# EAGLE schematic 2017_01_15_release_v2 (EAGLE 7.6.0)
AUTHOR: Mike Stein; REV: 2.0

## Sheet 1 of 21
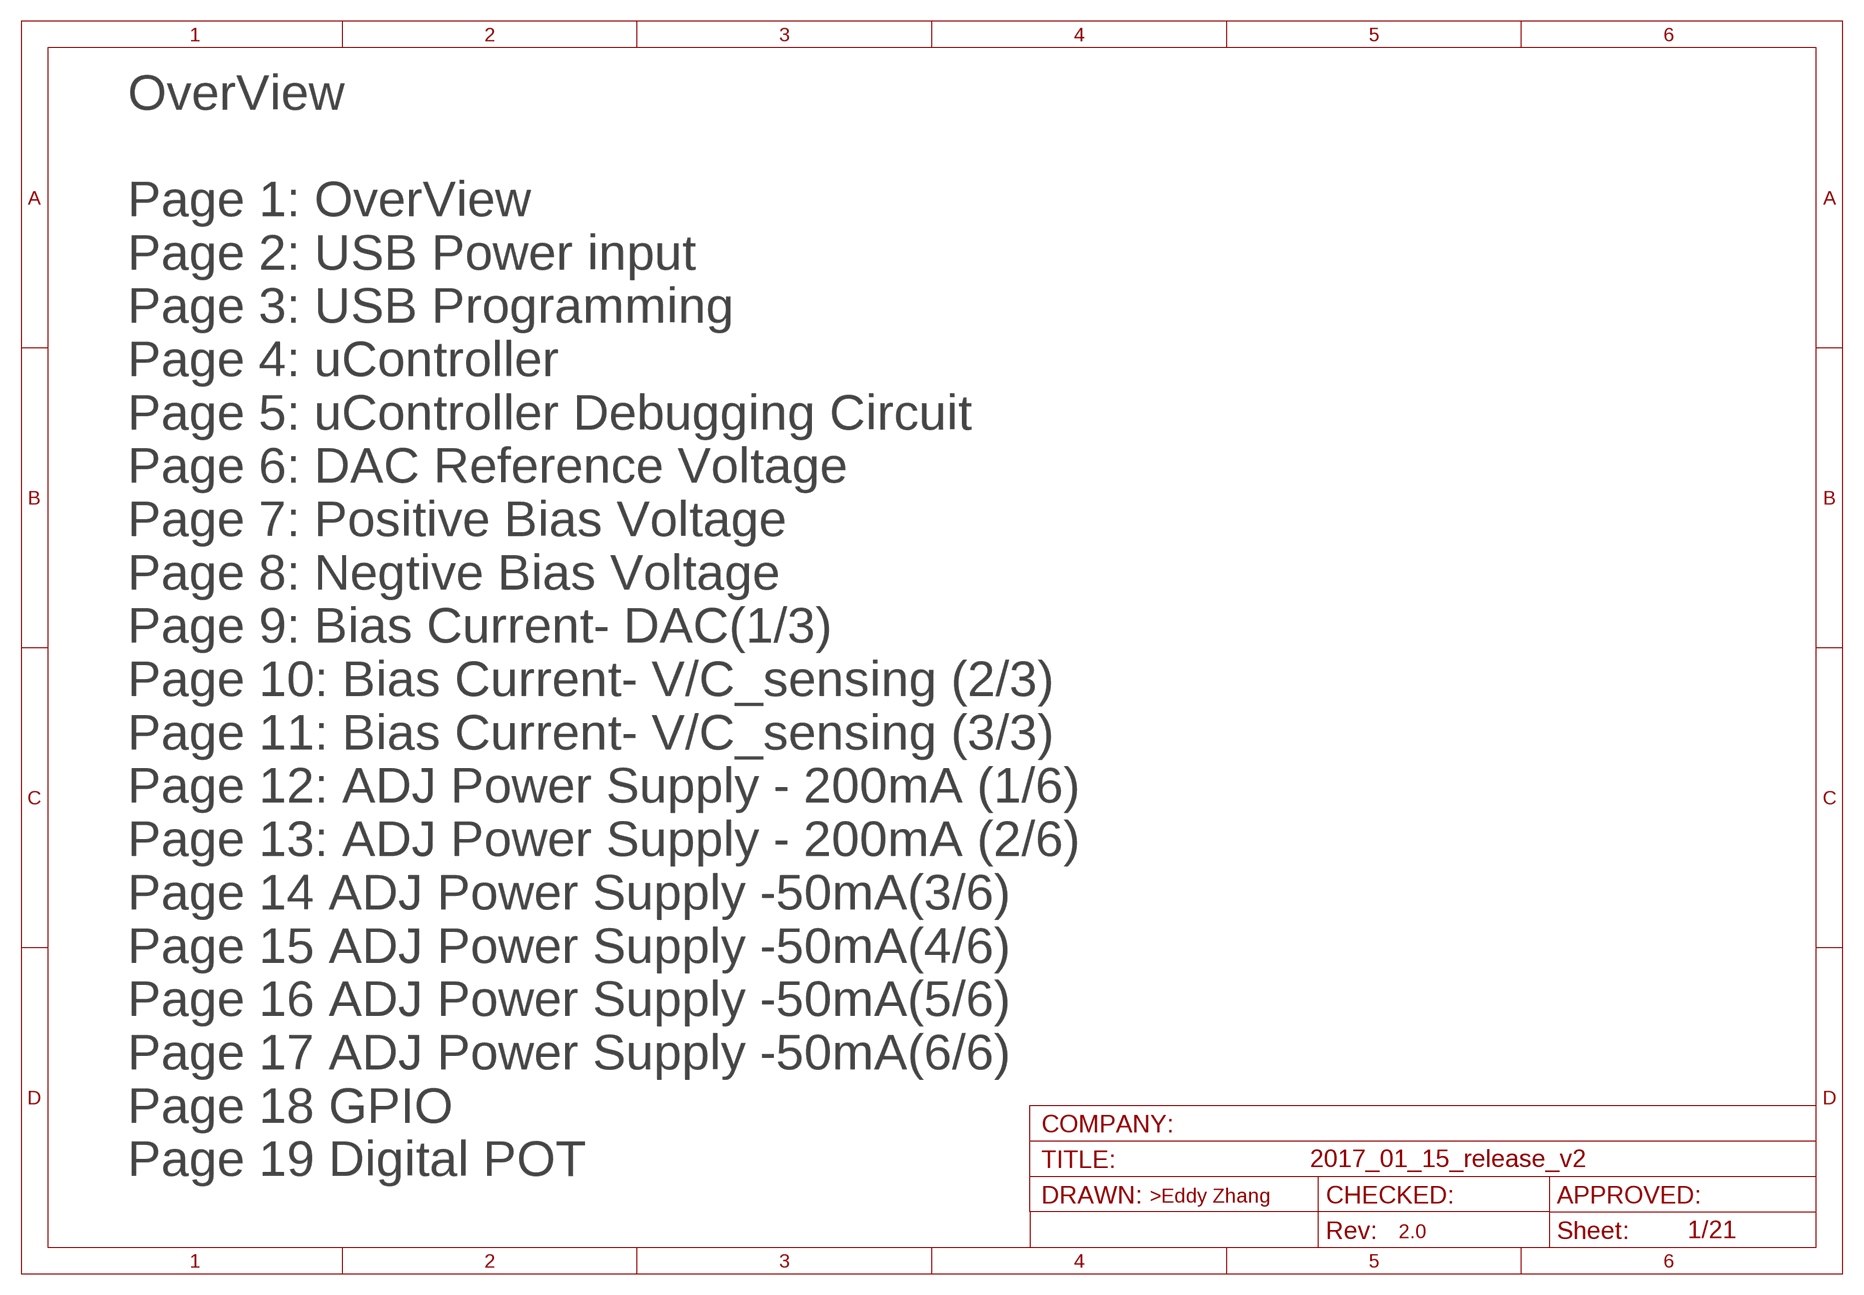
[diagram p0: schematic, sheet 1]

### Notes on the sheet
- >Eddy Zhang
- OverView
  
  Page 1: OverView
  Page 2: USB Power input
  Page 3: USB Programming
  Page 4: uController
  Page 5: uController Debugging Circuit
  Page 6: DAC Reference Voltage
  Page 7: Positive Bias Voltage
  Page 8: Negtive Bias Voltage
  Page 9: Bias Current- DAC(1/3)
  Page 10: Bias Current- V/C_sensing (2/3)
  Page 11: Bias Current- V/C_sensing (3/3)
  Page 12: ADJ Power Supply - 200mA (1/6)
  Page 13: ADJ Power Supply - 200mA (2/6)
  Page 14 ADJ Power Supply -50mA(3/6)
  Page 15 ADJ Power Supply -50mA(4/6)
  Page 16 ADJ Power Supply -50mA(5/6)
  Page 17 ADJ Power Supply -50mA(6/6)
  Page 18 GPIO
  Page 19 Digital POT

## Sheet 2 of 21
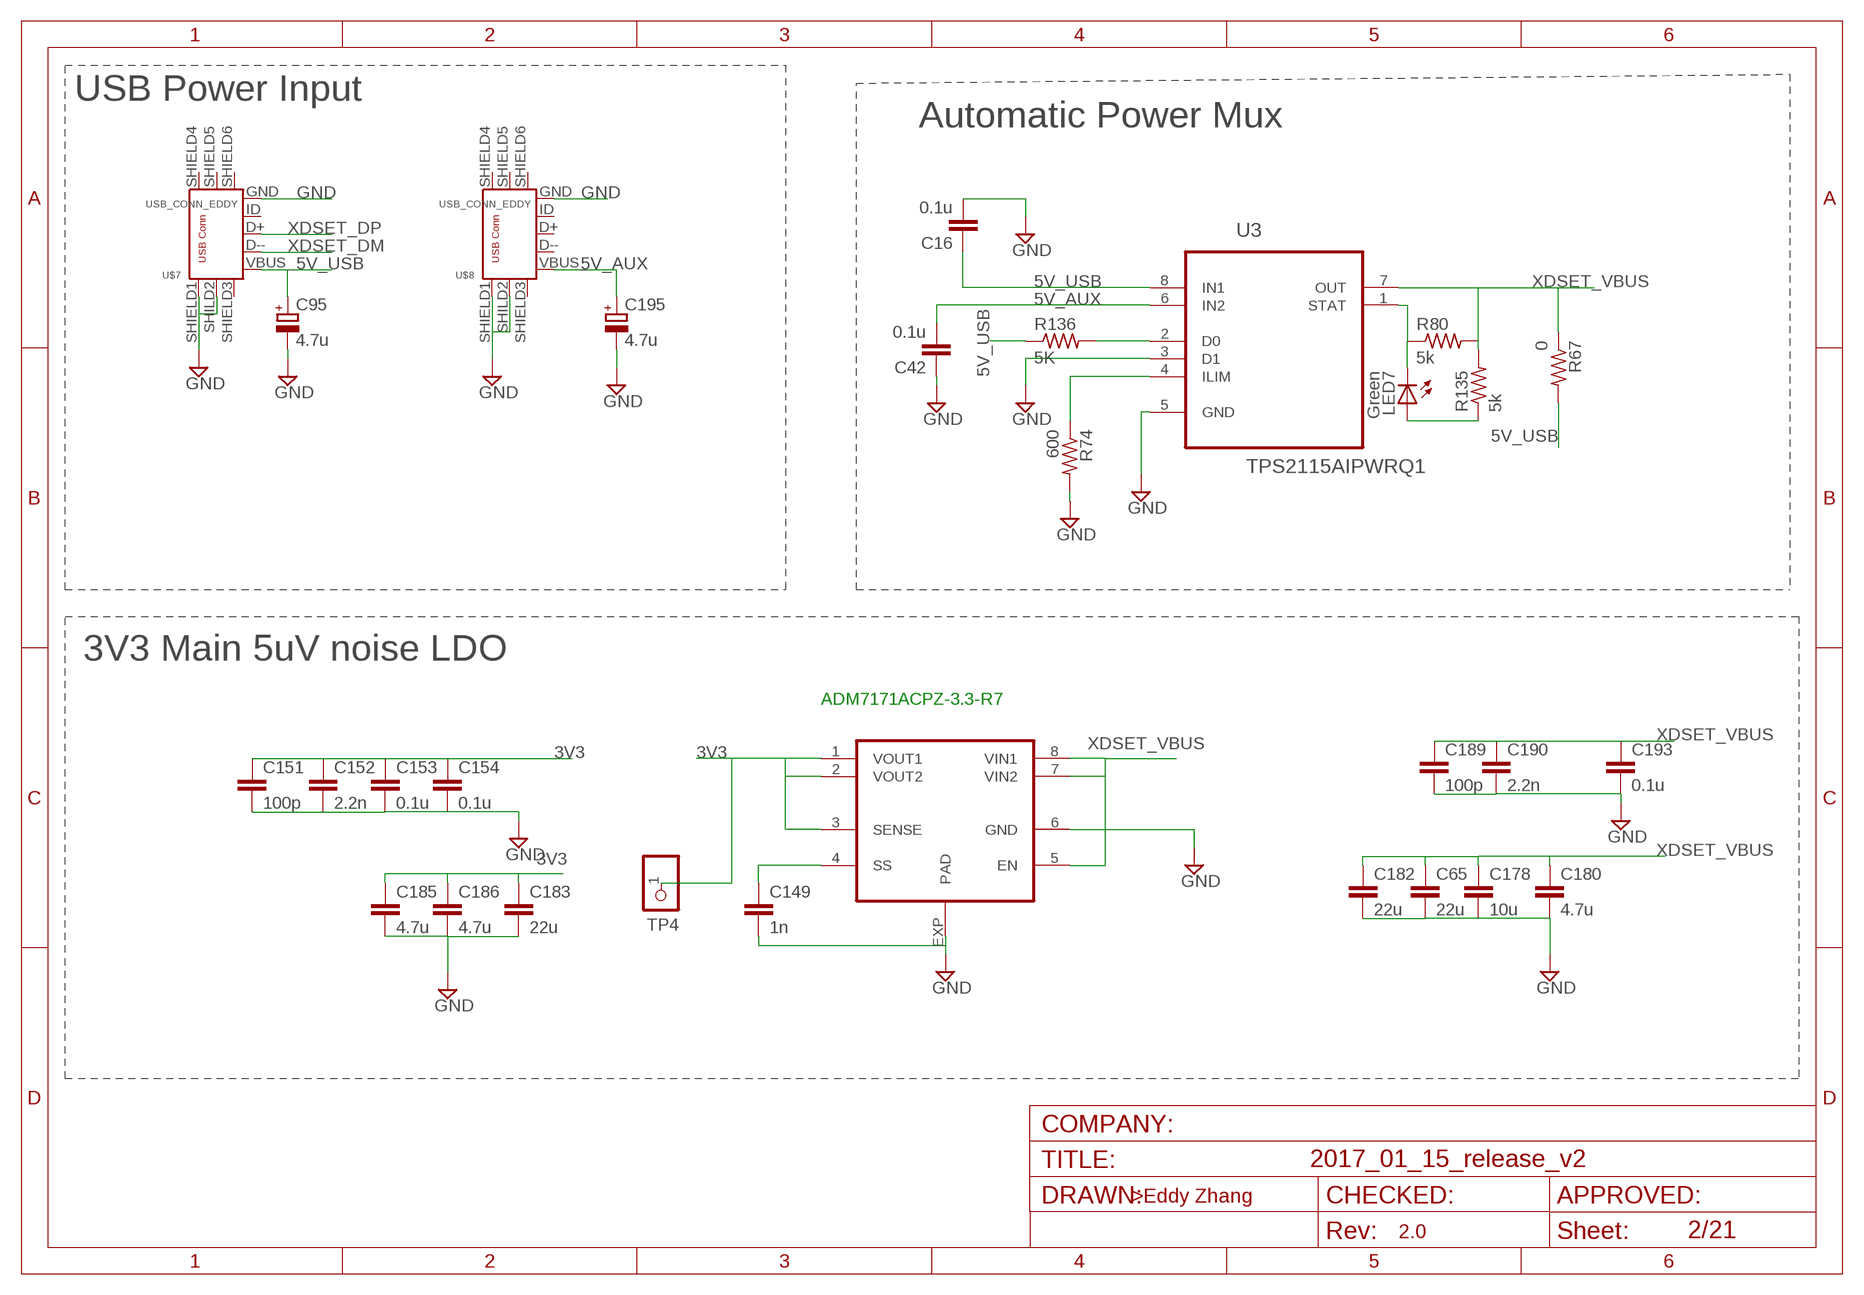
[diagram p1: schematic, sheet 2]

### Parts
C16  0.1u  C-EUC0603  [C0603]
C42  0.1u  C-EUC0603  [C0603]
C65  22u  C-EUC1210  [C1210]
C95  4.7u  CPOL-EUA/3216-18R  [A/3216-18R]
C149  1n  C-EUC0603  [C0603]
C151  100p  C-EUC0603  [C0603]
C152  2.2n  C-EUC0603  [C0603]
C153  0.1u  C-EUC0603  [C0603]
C154  0.1u  C-EUC0603  [C0603]
C178  10u  C-EUC0805  [C0805]
C180  4.7u  C-EUC0805  [C0805]
C182  22u  C-EUC1210  [C1210]
C183  22u  C-EUC1210  [C1210]
C185  4.7u  C-EUC0805  [C0805]
C186  4.7u  C-EUC0805  [C0805]
C189  100p  C-EUC0603  [C0603]
C190  2.2n  C-EUC0603  [C0603]
C193  0.1u  C-EUC0603  [C0603]
C195  4.7u  CPOL-EUA/3216-18R  [A/3216-18R]
LED7  Green  LED0603  [LED-0603]
R67  0  R-US_R0603  [R0603]
R74  600  R-US_R0603  [R0603]
R80  5k  R-US_R0603  [R0603]
R135  5k  R-US_R0603  [R0603]
R136  5K  R-US_R0603  [R0603]
TP4  TEST_PIN2  PINHD-1X1  [1X01]
U3  TPS2115AIPWRQ1  [SOP65P640X120-8N]
U$7  USB_CONN_EDDY  [USB_MICRO_EDDY]
U$8  USB_CONN_EDDY  [USB_MICRO_EDDY]
U$43  ADM7171  [LFCSP8]

### Nets
3V3 [Power]: C151.1 C152.1 C153.1 C154.1 C183.1 C185.1 C186.1 TP4.1 U$43.1(VOUT1) U$43.2(VOUT2) U$43.3(SENSE) ; also sheet 4,5,6,7,8,9,10,11,12,13,14,15,16,17,18,19,20
5V_AUX: C42.2 C195.+ U3.6(IN2) U$8.VBUS_(VBUS) ; also sheet 6
5V_USB [Power]: C16.1 C95.+ R67.2 R136.1 U3.8(IN1) U$7.VBUS_(VBUS) ; also sheet 3,6,7
GND [GND]: C16.2 C42.1 C65.2 C95.- C149.2 C151.2 C152.2 C153.2 C154.2 C178.2 C180.2 C182.2 C183.2 C185.2 C186.2 C189.2 C190.2 C193.2 C195.- R74.2 U3.3(D1) U3.5(GND) U$7.GND U$7.SHIELD1 U$7.SHILD2(SHIELD2) U$8.GND U$8.SHIELD1 U$8.SHILD2(SHIELD2) U$43.6(GND) U$43.EXP(PAD) ; also sheet 3,4,5,6,7,8,9,10,11,12,13,14,15,16,17,18,19,20,21
N$62: LED7.A R135.1
N$64: R136.2 U3.2(D0)
N$96: C149.1 U$43.4(SS)
N$129: LED7.C R80.1 U3.1(STAT)
N$133: R74.1 U3.4(ILIM)
XDSET_DM: U$7.D--(D-) ; also sheet 3
XDSET_DP: U$7.D+ ; also sheet 3
XDSET_VBUS [Power]: C65.1 C178.1 C180.1 C182.1 C189.1 C190.1 C193.1 R67.1 R80.2 R135.2 U3.7(OUT) U$43.5(EN) U$43.7(VIN2) U$43.8(VIN1) ; also sheet 6
Unconnected: U$7.ID(USBID) U$7.SHIELD3 U$7.SHIELD4 U$7.SHIELD5 U$7.SHIELD6 U$8.D+ U$8.D--(D-) U$8.ID(USBID) U$8.SHIELD3 U$8.SHIELD4 U$8.SHIELD5 U$8.SHIELD6

### Notes on the sheet
- USB Power Input
- Automatic Power Mux
- 3V3 Main 5uV noise LDO
- ADM7171ACPZ-3.3-R7
- >Eddy Zhang

## Sheet 3 of 21
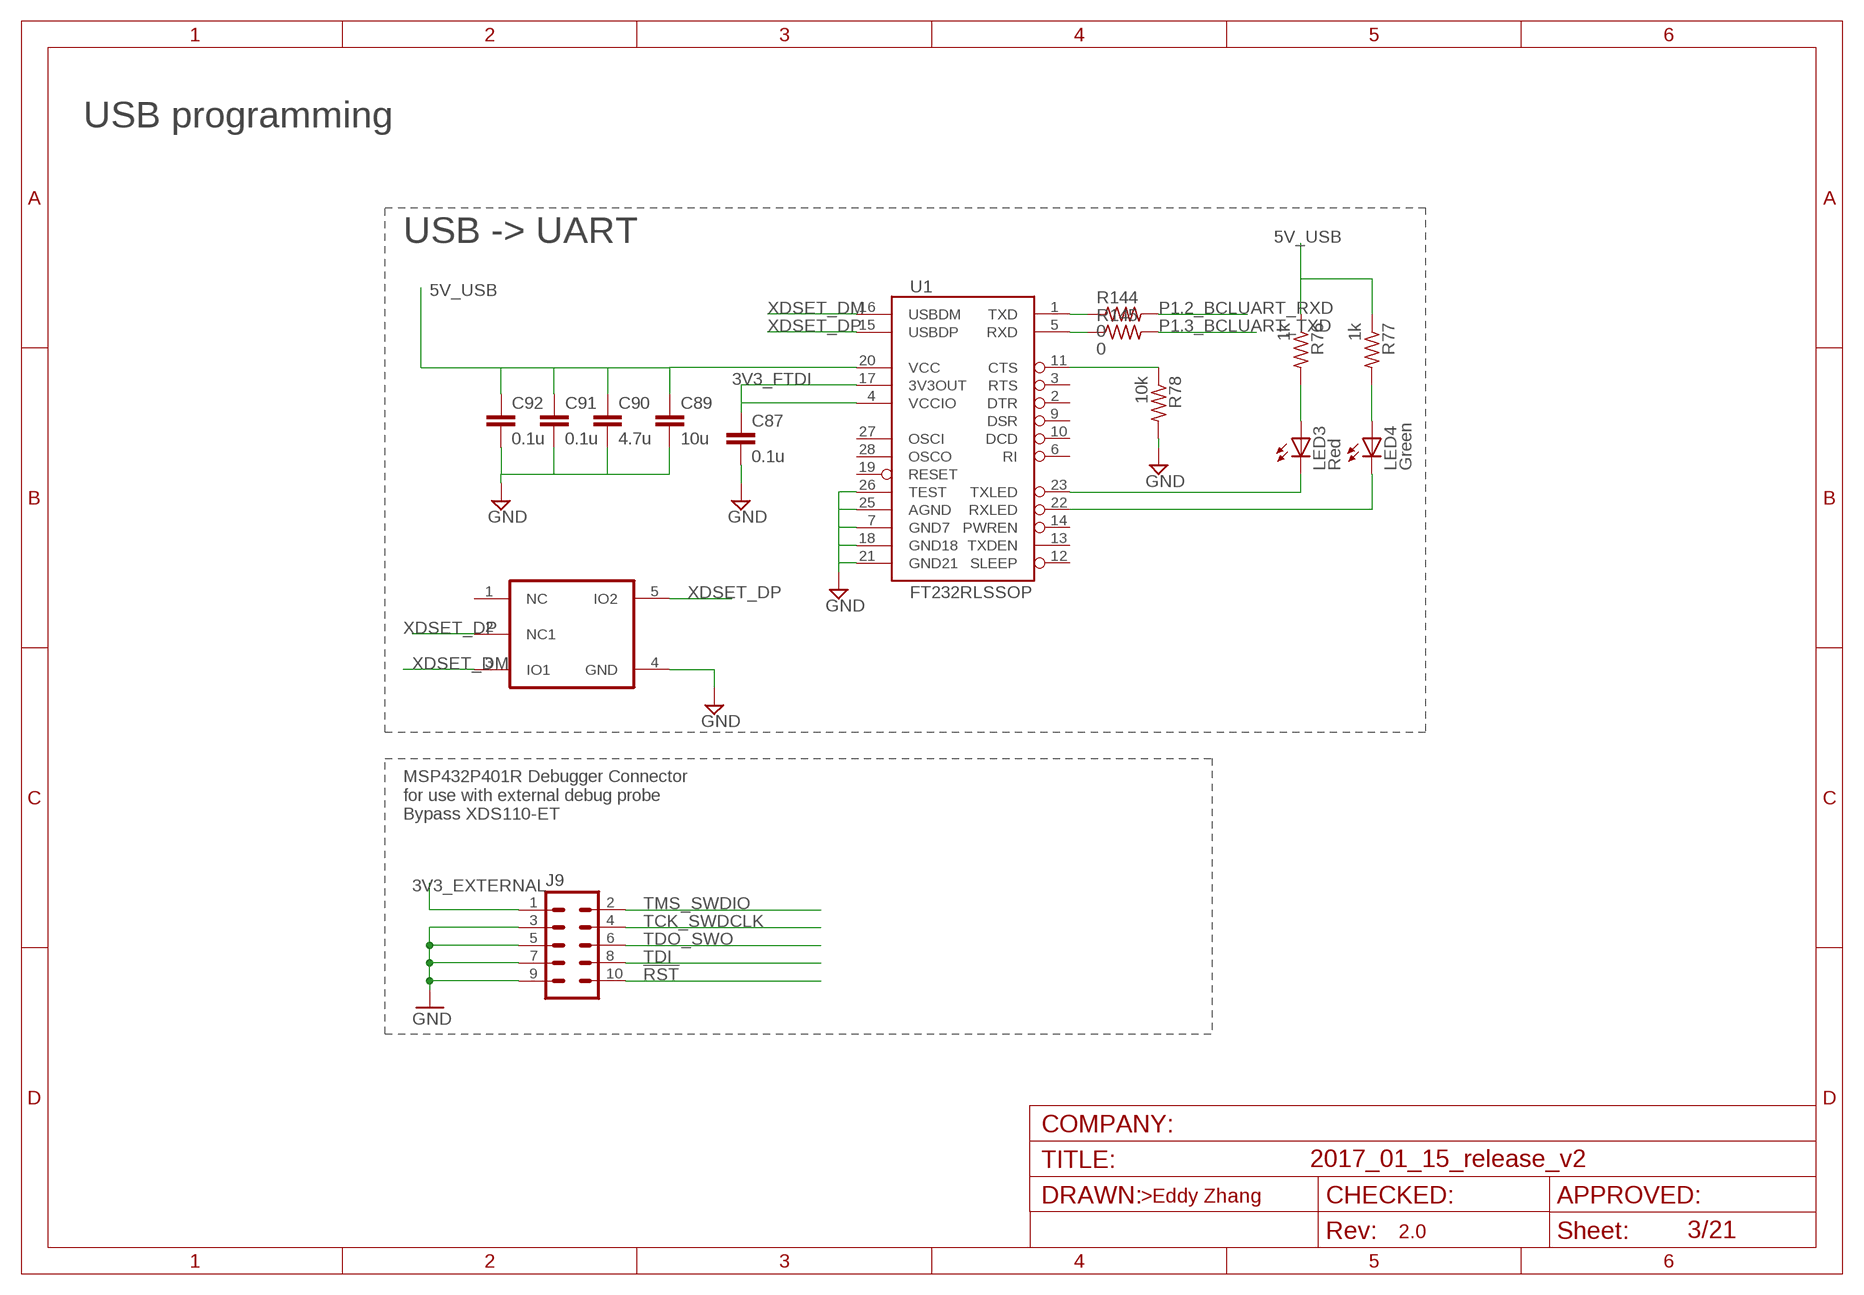
[diagram p2: schematic, sheet 3]

### Parts
C87  0.1u  C-EUC0603  [C0603]
C89  10u  C-EUC0805  [C0805]
C90  4.7u  C-EUC0805  [C0805]
C91  0.1u  C-EUC0603  [C0603]
C92  0.1u  C-EUC0603  [C0603]
ESD_DIODE  TPD2E2U06  [SOT_DRL_N5]
J9  DEBUG_ARM-10  [ARM-10]
LED3  Red  LED0603  [LED-0603]
LED4  Green  LED0603  [LED-0603]
R76  1k  R-US_R0603  [R0603]
R77  1k  R-US_R0603  [R0603]
R78  10k  R-US_R0603  [R0603]
R144  0  R-US_R0603  [R0603]
R145  0  R-US_R0603  [R0603]
U1  FT232RLSSOP  [SSOP28DB]

### Nets
3V3_EXTERNAL [Power]: J9.1
3V3_FTDI: C87.1 U1.4(VCCIO) U1.17(3V3OUT)
5V_USB [Power]: C89.1 C90.1 C91.1 C92.1 R76.1 R77.1 U1.20(VCC) ; also sheet 2,6,7
!RST: J9.10 ; also sheet 5,6
GND [GND]: C87.2 C89.2 C90.2 C91.2 C92.2 ESD_DIODE.4(GND) J9.3 J9.5 J9.7 J9.9 R78.2 U1.7(GND7) U1.18(GND18) U1.21(GND21) U1.25(AGND) U1.26(TEST) ; also sheet 2,4,5,6,7,8,9,10,11,12,13,14,15,16,17,18,19,20,21
N$92: R78.1 U1.11(CTS)
N$102: LED3.C U1.23(TXLED)
N$103: LED4.C U1.22(RXLED)
N$105: LED3.A R76.2
N$106: LED4.A R77.2
P1.2_BCLUART_RXD: R144.2 ; also sheet 5
P1.2_BCLUART_RXD_IC: R144.1 U1.1(TXD)
P1.3_BCLUART_TXD: R145.2 ; also sheet 5
P1.3_BCLUART_TXD_IC: R145.1 U1.5(RXD)
TCK_SWDCLK: J9.4 ; also sheet 5
TDI: J9.8 ; also sheet 5
TDO_SWO: J9.6 ; also sheet 5
TMS_SWDIO: J9.2 ; also sheet 5
XDSET_DM: ESD_DIODE.3(IO1) U1.16(USBDM) ; also sheet 2
XDSET_DP: ESD_DIODE.2(NC1) ESD_DIODE.5(IO2) U1.15(USBDP) ; also sheet 2
Unconnected: ESD_DIODE.1(NC) U1.2(DTR) U1.3(RTS) U1.6(RI) U1.9(DSR) U1.10(DCD) U1.12(SLEEP) U1.13(TXDEN) U1.14(PWREN) U1.19(RESET) U1.27(OSCI) U1.28(OSCO)

### Notes on the sheet
- USB programming
- USB -> UART
- MSP432P401R Debugger Connector
  for use with external debug probe
  Bypass XDS110-ET
- >Eddy Zhang

## Sheet 4 of 21
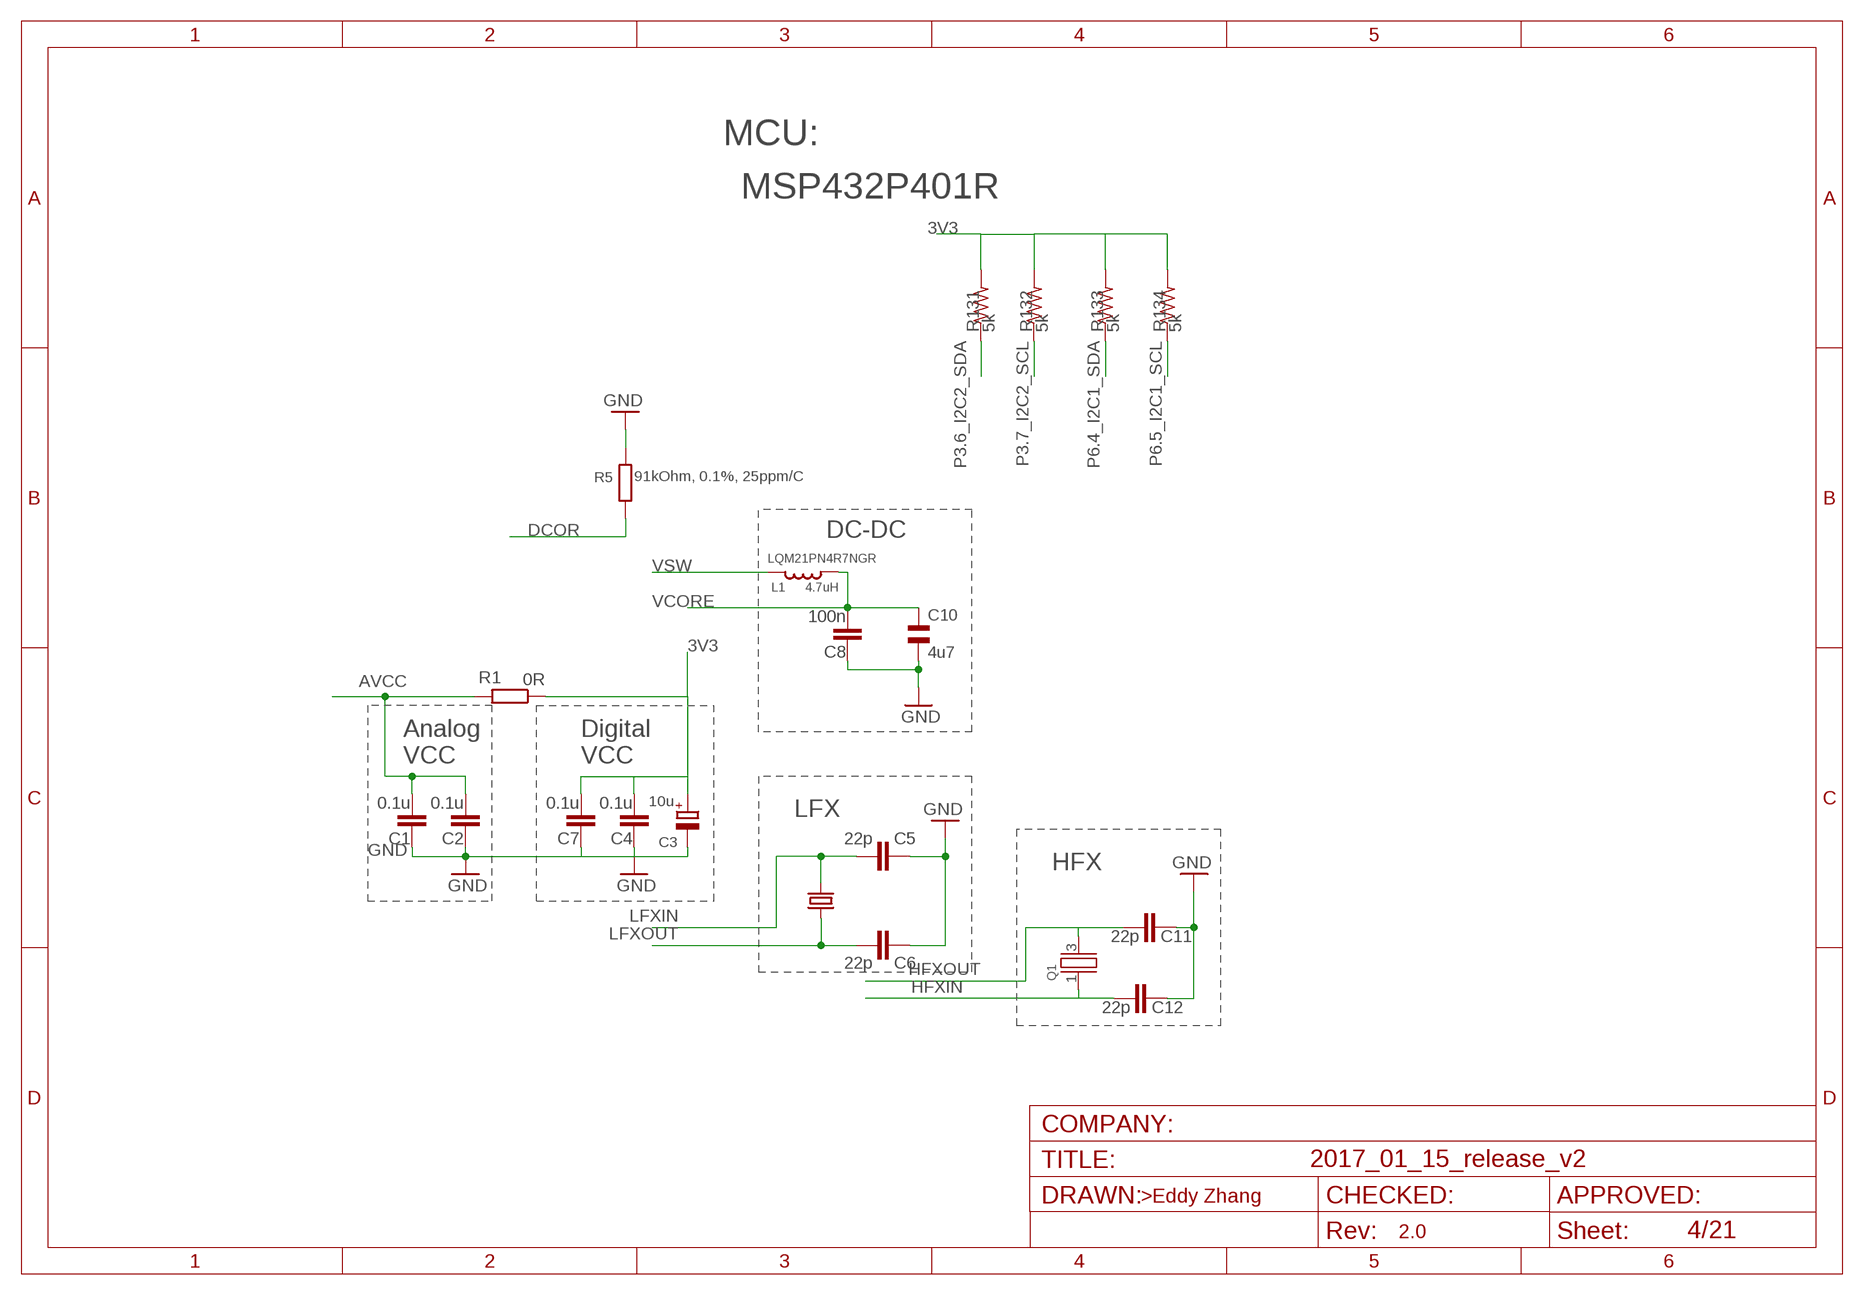
[diagram p3: schematic, sheet 4]

### Parts
32KHZ  FC-135  [FC-135_32KHZ]
C1  0.1u  C-EUC0603K  [C0603K]
C2  0.1u  C-EUC0603K  [C0603K]
C3  10u  CPOL-EUA/3216-18R  [A/3216-18R]
C4  0.1u  C-EUC0603K  [C0603K]
C5  22p  C-EUC0603  [C0603]
C6  22p  C-EUC0603  [C0603]
C7  0.1u  C-EUC0603K  [C0603K]
C8  100n  C-EUC0603K  [C0603K]
C10  4u7  CSMD0805  [CSMD0805]
C11  22p  C-EUC0603K  [C0603K]
C12  22p  C-EUC0603K  [C0603K]
L1  4.7uH  LQM2MP_G0  [0806]
Q1  CRYSTALEPSON_FA-238  [FA-238]
R1  0R  R-EU_R0603  [R0603]
R5  91kOhm, 0.1%, 25ppm/C  R_0805  [0805]
R131  5k  R-US_R0603  [R0603]
R132  5k  R-US_R0603  [R0603]
R133  5k  R-US_R0603  [R0603]
R134  5k  R-US_R0603  [R0603]

### Nets
3V3 [Power]: C3.+ C4.1 C7.1 R1.1 R131.2 R132.2 R133.2 R134.2 ; also sheet 2,5,6,7,8,9,10,11,12,13,14,15,16,17,18,19,20
AVCC: C1.1 C2.1 R1.2 ; also sheet 5
DCOR: R5.1 ; also sheet 5
GND [GND]: C1.2 C2.2 C3.- C4.2 C5.2 C6.2 C7.2 C8.2 C10.2 C11.2 C12.2 R5.2 ; also sheet 2,3,5,6,7,8,9,10,11,12,13,14,15,16,17,18,19,20,21
HFXIN: C12.1 Q1.1 ; also sheet 5
HFXOUT: C11.1 Q1.3 ; also sheet 5
LFXIN: 32KHZ.P$2 C5.1 ; also sheet 5
LFXOUT: 32KHZ.P$1 C6.1 ; also sheet 5
P3.6_I2C2_SDA: R131.1 ; also sheet 5,17,18,19,20
P3.7_I2C2_SCL: R132.1 ; also sheet 5,17,18,19,20
P6.4_I2C1_SDA: R133.1 ; also sheet 5,13,14,15,16
P6.5_I2C1_SCL: R134.1 ; also sheet 5,13,14,15,16
VCORE: C8.1 C10.1 L1.1 ; also sheet 5
VSW: L1.2 ; also sheet 5

### Notes on the sheet
- MCU:
- MSP432P401R
- DC-DC
- LQM21PN4R7NGR
- Analog | Digital
- VCC | VCC
- LFX
- HFX
- >Eddy Zhang

## Sheet 5 of 21
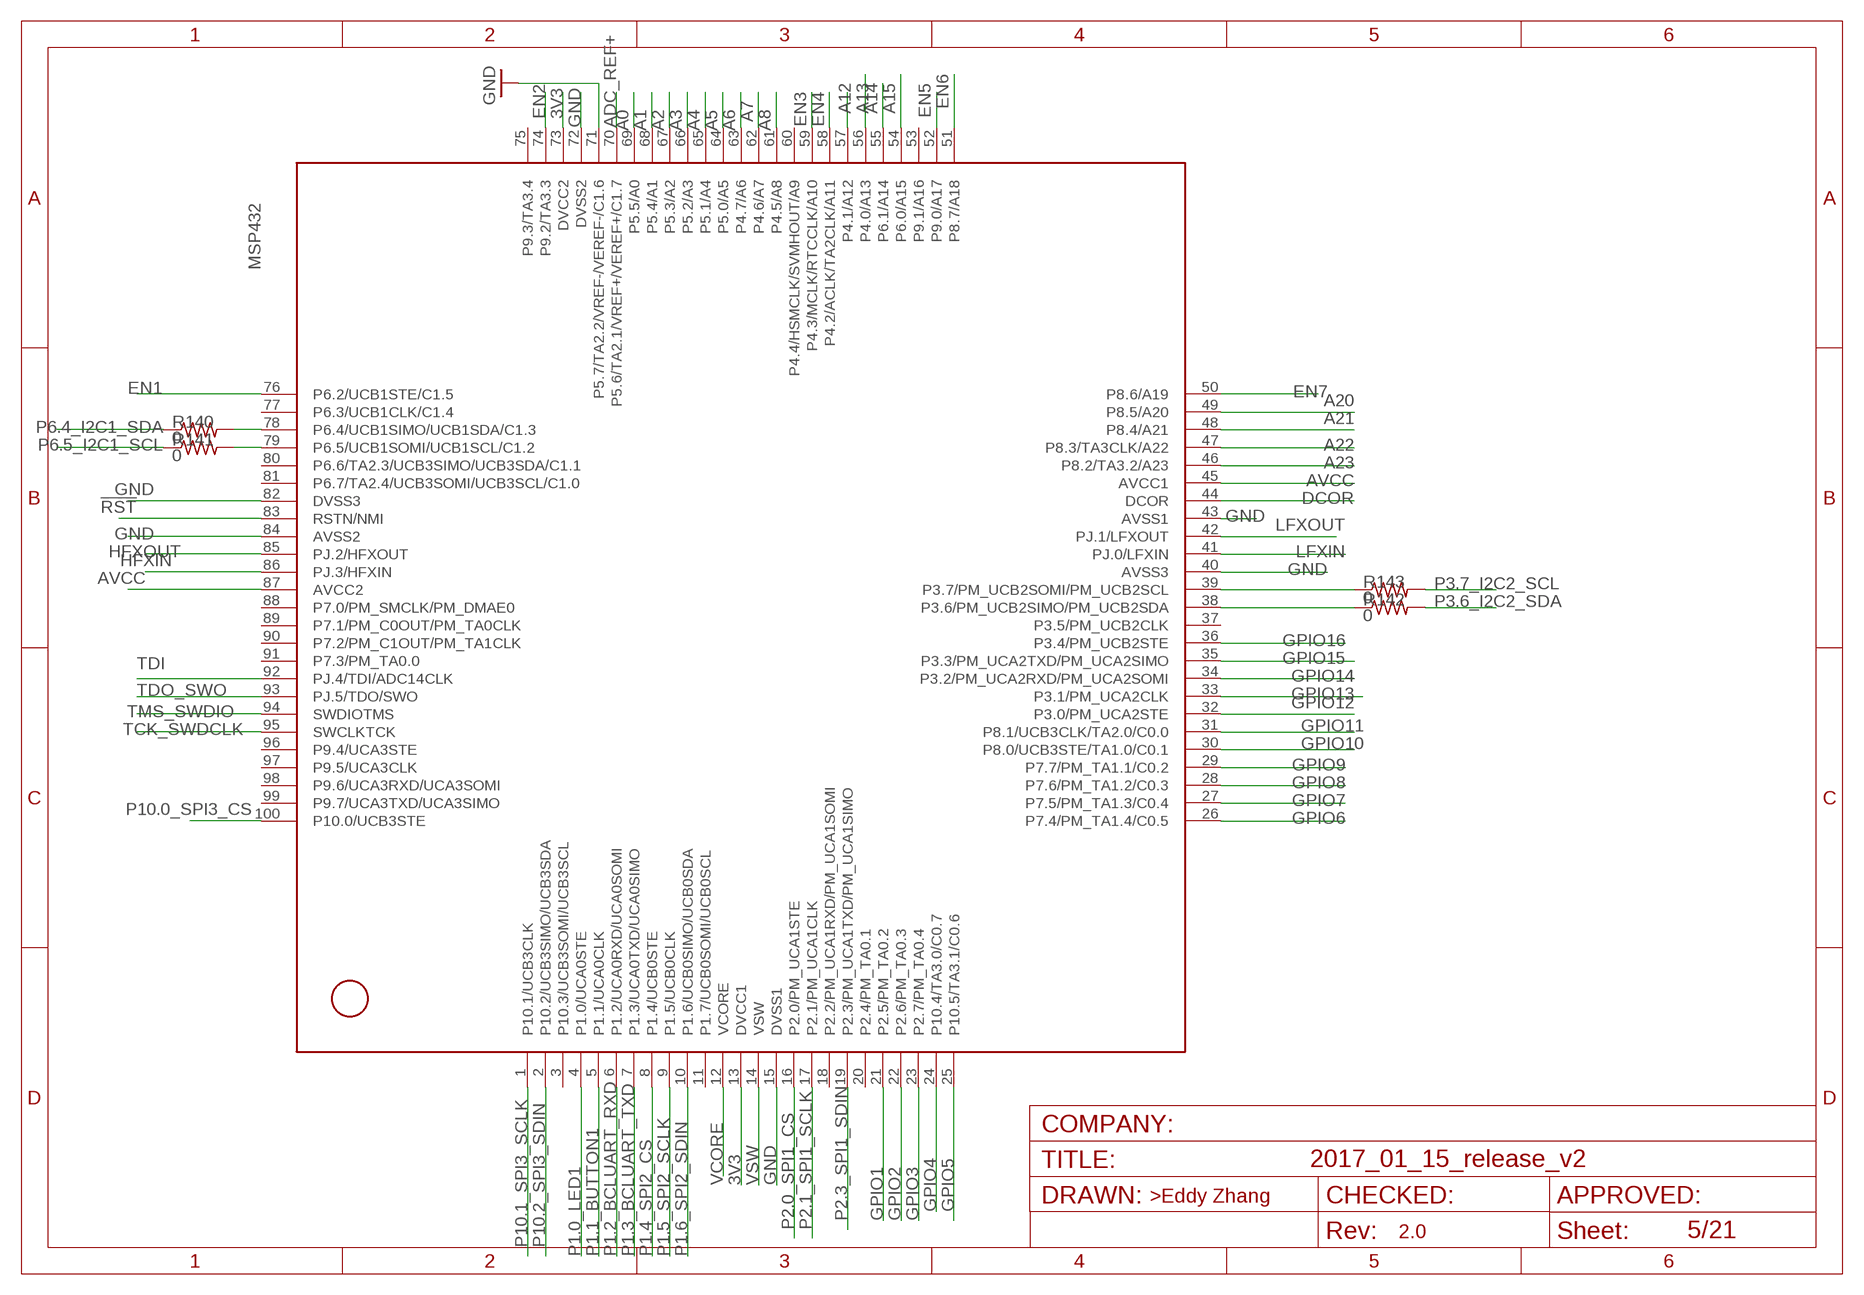
[diagram p4: schematic, sheet 5]

### Parts
MSP432  MSP432P401XPZ  [LQFP100]
R140  0  R-US_R0603  [R0603]
R141  0  R-US_R0603  [R0603]
R142  0  R-US_R0603  [R0603]
R143  0  R-US_R0603  [R0603]

### Nets
3V3 [Power]: MSP432.13(DVCC1) MSP432.73(DVCC2) ; also sheet 2,4,6,7,8,9,10,11,12,13,14,15,16,17,18,19,20
!RST: MSP432.83(RSTN/NMI) ; also sheet 3,6
A0: MSP432.69(P5.5/A0) ; also sheet 13
A1: MSP432.68(P5.4/A1) ; also sheet 13
A2: MSP432.67(P5.3/A2) ; also sheet 14
A3: MSP432.66(P5.2/A3) ; also sheet 14
A4: MSP432.65(P5.1/A4) ; also sheet 15
A5: MSP432.64(P5.0/A5) ; also sheet 15
A6: MSP432.63(P4.7/A6) ; also sheet 16
A7: MSP432.62(P4.6/A7) ; also sheet 16
A8: MSP432.61(P4.5/A8) ; also sheet 17
A12: MSP432.57(P4.1/A12) ; also sheet 17
A13: MSP432.56(P4.0/A13) ; also sheet 18
A14: MSP432.55(P6.1/A14) ; also sheet 18
A15: MSP432.54(P6.0/A15) ; also sheet 19
A20: MSP432.49(P8.5/A20) ; also sheet 12
A21: MSP432.48(P8.4/A21) ; also sheet 11
A22: MSP432.47(P8.3/TA3CLK/A22) ; also sheet 11
A23: MSP432.46(P8.2/TA3.2/A23) ; also sheet 12
ADC_REF+: MSP432.70(P5.6/TA2.1/VREF+/VEREF+/C1.7) ; also sheet 7
AVCC: MSP432.45(AVCC1) MSP432.87(AVCC2) ; also sheet 4
DCOR: MSP432.44(DCOR) ; also sheet 4
EN1: MSP432.76(P6.2/UCB1STE/C1.5) ; also sheet 13
EN2: MSP432.74(P9.2/TA3.3) ; also sheet 14
EN3: MSP432.59(P4.3/MCLK/RTCCLK/A10) ; also sheet 15
EN4: MSP432.58(P4.2/ACLK/TA2CLK/A11) ; also sheet 16
EN5: MSP432.52(P9.0/A17) ; also sheet 17
EN6: MSP432.51(P8.7/A18) ; also sheet 18
EN7: MSP432.50(P8.6/A19) ; also sheet 19
GND [GND]: MSP432.15(DVSS1) MSP432.40(AVSS3) MSP432.43(AVSS1) MSP432.71(P5.7/TA2.2/VREF-/VEREF-/C1.6) MSP432.72(DVSS2) MSP432.82(DVSS3) MSP432.84(AVSS2) ; also sheet 2,3,4,6,7,8,9,10,11,12,13,14,15,16,17,18,19,20,21
GPIO1: MSP432.21(P2.5/PM_TA0.2) ; also sheet 19
GPIO2: MSP432.22(P2.6/PM_TA0.3) ; also sheet 19
GPIO3: MSP432.23(P2.7/PM_TA0.4) ; also sheet 19
GPIO4: MSP432.24(P10.4/TA3.0/C0.7) ; also sheet 19
GPIO5: MSP432.25(P10.5/TA3.1/C0.6) ; also sheet 19
GPIO6: MSP432.26(P7.4/PM_TA1.4/C0.5) ; also sheet 19
GPIO7: MSP432.27(P7.5/PM_TA1.3/C0.4) ; also sheet 19
GPIO8: MSP432.28(P7.6/PM_TA1.2/C0.3) ; also sheet 19
GPIO9: MSP432.29(P7.7/PM_TA1.1/C0.2) ; also sheet 19
GPIO10: MSP432.30(P8.0/UCB3STE/TA1.0/C0.1) ; also sheet 19
GPIO11: MSP432.31(P8.1/UCB3CLK/TA2.0/C0.0) ; also sheet 19
GPIO12: MSP432.32(P3.0/PM_UCA2STE) ; also sheet 19
GPIO13: MSP432.33(P3.1/PM_UCA2CLK) ; also sheet 19
GPIO14: MSP432.34(P3.2/PM_UCA2RXD/PM_UCA2SOMI) ; also sheet 19
GPIO15: MSP432.35(P3.3/PM_UCA2TXD/PM_UCA2SIMO) ; also sheet 19
GPIO16: MSP432.36(P3.4/PM_UCB2STE) ; also sheet 19
HFXIN: MSP432.86(PJ.3/HFXIN) ; also sheet 4
HFXOUT: MSP432.85(PJ.2/HFXOUT) ; also sheet 4
LFXIN: MSP432.41(PJ.0/LFXIN) ; also sheet 4
LFXOUT: MSP432.42(PJ.1/LFXOUT) ; also sheet 4
P1.0_LED1: MSP432.4(P1.0/UCA0STE) ; also sheet 6
P1.1_BUTTON1: MSP432.5(P1.1/UCA0CLK) ; also sheet 6
P1.2_BCLUART_RXD: MSP432.6(P1.2/UCA0RXD/UCA0SOMI) ; also sheet 3
P1.3_BCLUART_TXD: MSP432.7(P1.3/UCA0TXD/UCA0SIMO) ; also sheet 3
P1.4_SPI2_CS: MSP432.8(P1.4/UCB0STE) ; also sheet 10
P1.5_SPI2_SCLK: MSP432.9(P1.5/UCB0CLK) ; also sheet 10
P1.6_SPI2_SDIN: MSP432.10(P1.6/UCB0SIMO/UCB0SDA) ; also sheet 10
P2.0_SPI1_CS: MSP432.16(P2.0/PM_UCA1STE) ; also sheet 8
P2.1_SPI1_SCLK: MSP432.17(P2.1/PM_UCA1CLK) ; also sheet 8
P2.3_SPI1_SDIN: MSP432.19(P2.3/PM_UCA1TXD/PM_UCA1SIMO) ; also sheet 8
P3.6_I2C2_SDA: R142.2 ; also sheet 4,17,18,19,20
P3.6_I2C2_SDA_IC: MSP432.38(P3.6/PM_UCB2SIMO/PM_UCB2SDA) R142.1
P3.7_I2C2_SCL: R143.2 ; also sheet 4,17,18,19,20
P3.7_I2C2_SCL_IC: MSP432.39(P3.7/PM_UCB2SOMI/PM_UCB2SCL) R143.1
P6.4_I2C1_SDA: R140.1 ; also sheet 4,13,14,15,16
P6.4_I2C1_SDA_IC: MSP432.78(P6.4/UCB1SIMO/UCB1SDA/C1.3) R140.2
P6.5_I2C1_SCL: R141.1 ; also sheet 4,13,14,15,16
P6.5_I2C1_SCL_IC: MSP432.79(P6.5/UCB1SOMI/UCB1SCL/C1.2) R141.2
P10.0_SPI3_CS: MSP432.100(P10.0/UCB3STE) ; also sheet 9
P10.1_SPI3_SCLK: MSP432.1(P10.1/UCB3CLK) ; also sheet 9
P10.2_SPI3_SDIN: MSP432.2(P10.2/UCB3SIMO/UCB3SDA) ; also sheet 9
TCK_SWDCLK: MSP432.95(SWCLKTCK) ; also sheet 3
TDI: MSP432.92(PJ.4/TDI/ADC14CLK) ; also sheet 3
TDO_SWO: MSP432.93(PJ.5/TDO/SWO) ; also sheet 3
TMS_SWDIO: MSP432.94(SWDIOTMS) ; also sheet 3
VCORE: MSP432.12(VCORE) ; also sheet 4
VSW: MSP432.14(VSW) ; also sheet 4
Unconnected: MSP432.3(P10.3/UCB3SOMI/UCB3SCL) MSP432.11(P1.7/UCB0SOMI/UCB0SCL) MSP432.18(P2.2/PM_UCA1RXD/PM_UCA1SOMI) MSP432.20(P2.4/PM_TA0.1) MSP432.37(P3.5/PM_UCB2CLK) MSP432.53(P9.1/A16) MSP432.60(P4.4/HSMCLK/SVMHOUT/A9) MSP432.75(P9.3/TA3.4) MSP432.77(P6.3/UCB1CLK/C1.4) MSP432.80(P6.6/TA2.3/UCB3SIMO/UCB3SDA/C1.1) MSP432.81(P6.7/TA2.4/UCB3SOMI/UCB3SCL/C1.0) MSP432.88(P7.0/PM_SMCLK/PM_DMAE0) MSP432.89(P7.1/PM_C0OUT/PM_TA0CLK) MSP432.90(P7.2/PM_C1OUT/PM_TA1CLK) MSP432.91(P7.3/PM_TA0.0) MSP432.96(P9.4/UCA3STE) MSP432.97(P9.5/UCA3CLK) MSP432.98(P9.6/UCA3RXD/UCA3SOMI) MSP432.99(P9.7/UCA3TXD/UCA3SIMO)

### Notes on the sheet
- >Eddy Zhang

## Sheet 6 of 21
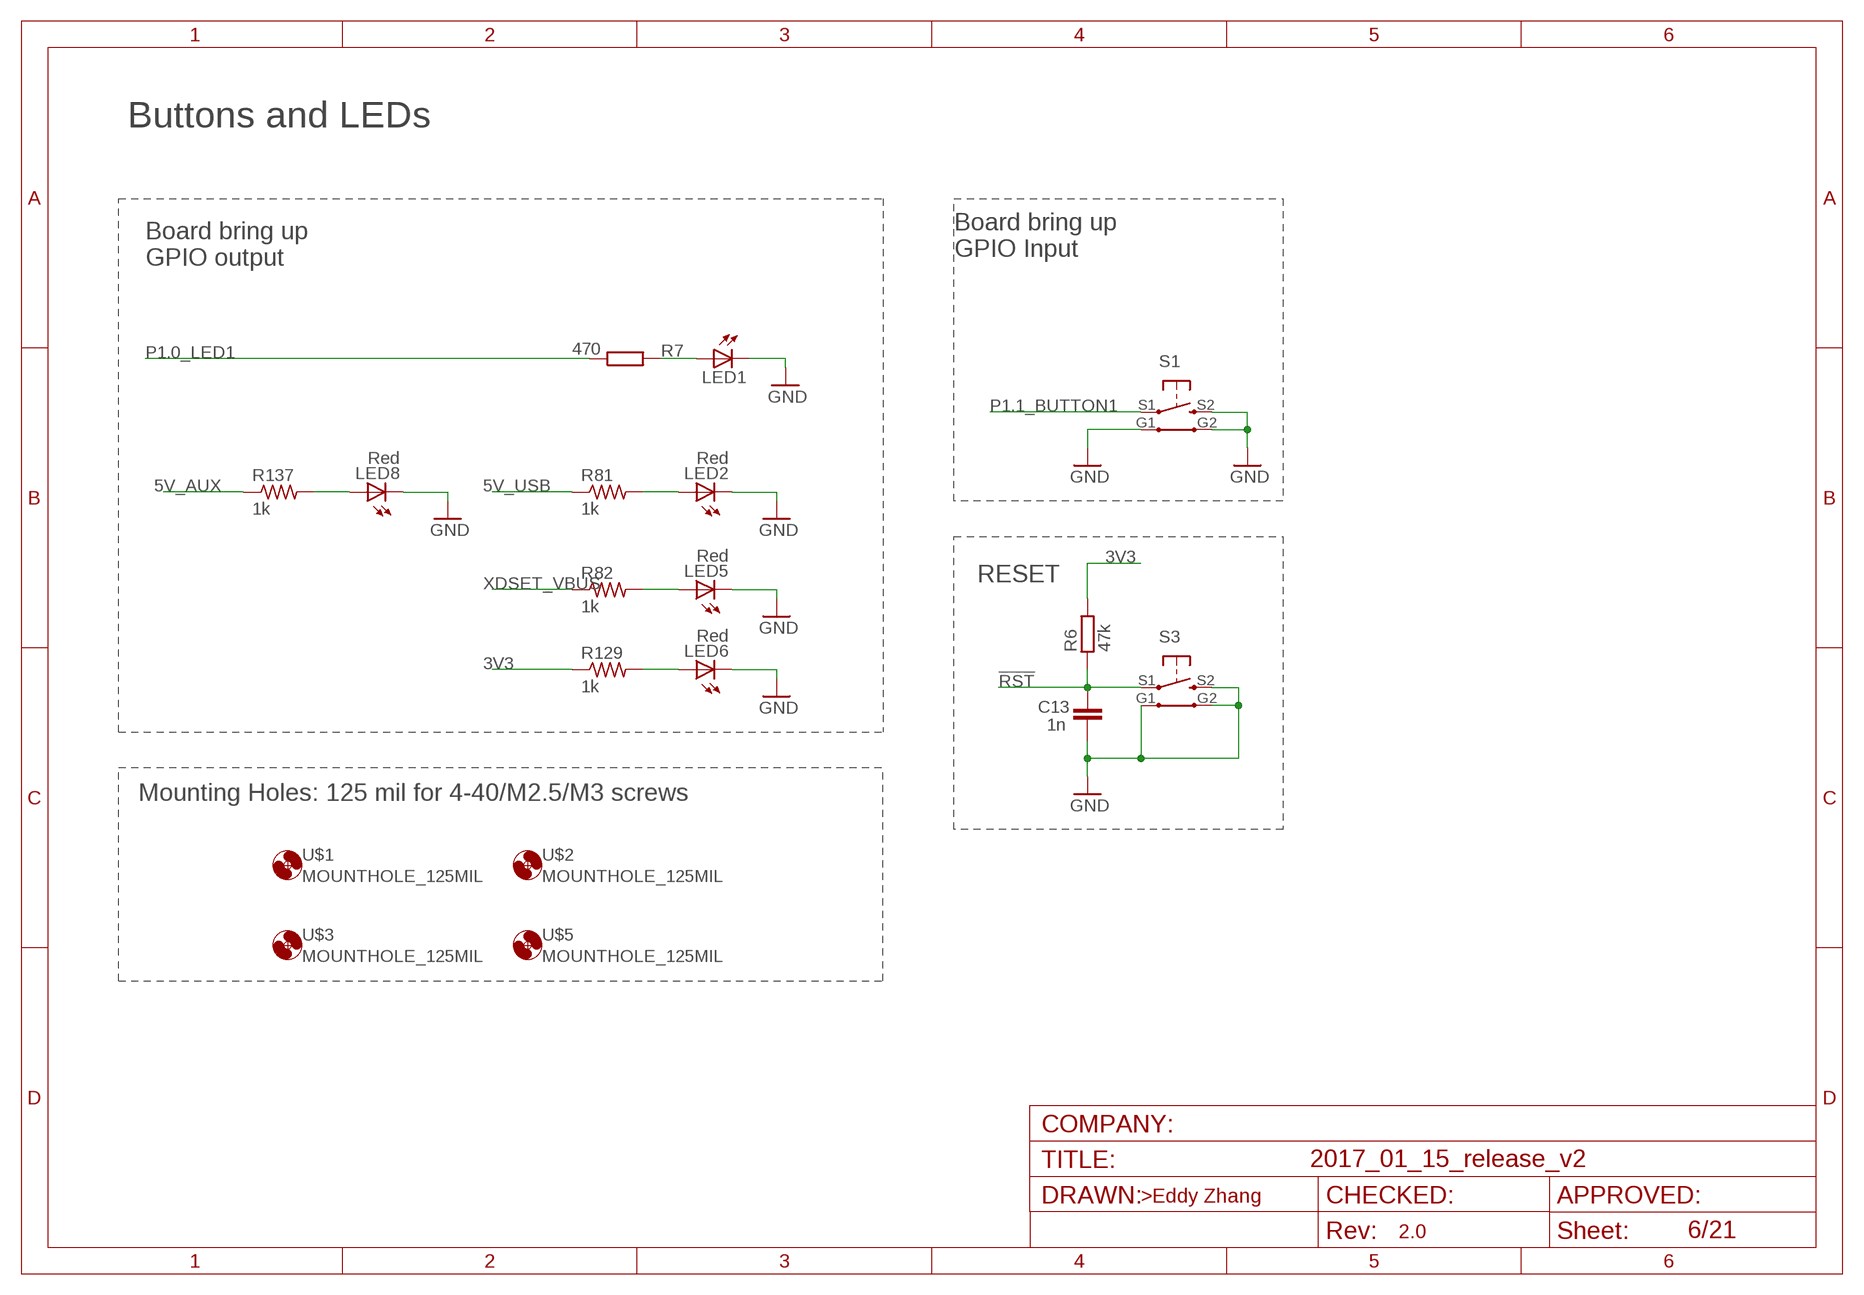
[diagram p5: schematic, sheet 6]

### Parts
C13  1n  C-EUC0603  [C0603]
LED1  LEDCHIPLED_0603  [CHIPLED_0603]
LED2  Red  LED0603  [LED-0603]
LED5  Red  LED0603  [LED-0603]
LED6  Red  LED0603  [LED-0603]
LED8  Red  LED0603  [LED-0603]
R6  47k  R-EU_R0603  [R0603]
R7  470  R-EU_R0603  [R0603]
R81  1k  R-US_R0603  [R0603]
R82  1k  R-US_R0603  [R0603]
R129  1k  R-US_R0603  [R0603]
R137  1k  R-US_R0603  [R0603]
S1  TS-1188E  [TS-1188E]
S3  TS-1188E  [TS-1188E]
U$1  MOUNTHOLE_125MIL  [MOUNTHOLE_125MIL]
U$2  MOUNTHOLE_125MIL  [MOUNTHOLE_125MIL]
U$3  MOUNTHOLE_125MIL  [MOUNTHOLE_125MIL]
U$5  MOUNTHOLE_125MIL  [MOUNTHOLE_125MIL]

### Nets
3V3 [Power]: R6.2 R129.1 ; also sheet 2,4,5,7,8,9,10,11,12,13,14,15,16,17,18,19,20
5V_AUX: R137.1 ; also sheet 2
5V_USB [Power]: R81.1 ; also sheet 2,3,7
!RST: C13.1 R6.1 S3.S1(P) ; also sheet 3,5
GND [GND]: C13.2 LED1.C LED2.C LED5.C LED6.C LED8.C S1.G1 S1.G2 S1.S2(S) S3.G1 S3.G2 S3.S2(S) ; also sheet 2,3,4,5,7,8,9,10,11,12,13,14,15,16,17,18,19,20,21
N$17: LED1.A R7.2
N$74: LED8.A R137.2
N$115: LED6.A R129.2
N$130: LED2.A R81.2
N$131: LED5.A R82.2
P1.0_LED1: R7.1 ; also sheet 5
P1.1_BUTTON1: S1.S1(P) ; also sheet 5
XDSET_VBUS [Power]: R82.1 ; also sheet 2

### Notes on the sheet
- Buttons and LEDs
- Board bring up
  GPIO Input
- Board bring up
  GPIO output
- RESET
- Mounting Holes: 125 mil for 4-40/M2.5/M3 screws
- >Eddy Zhang

## Sheet 7 of 21
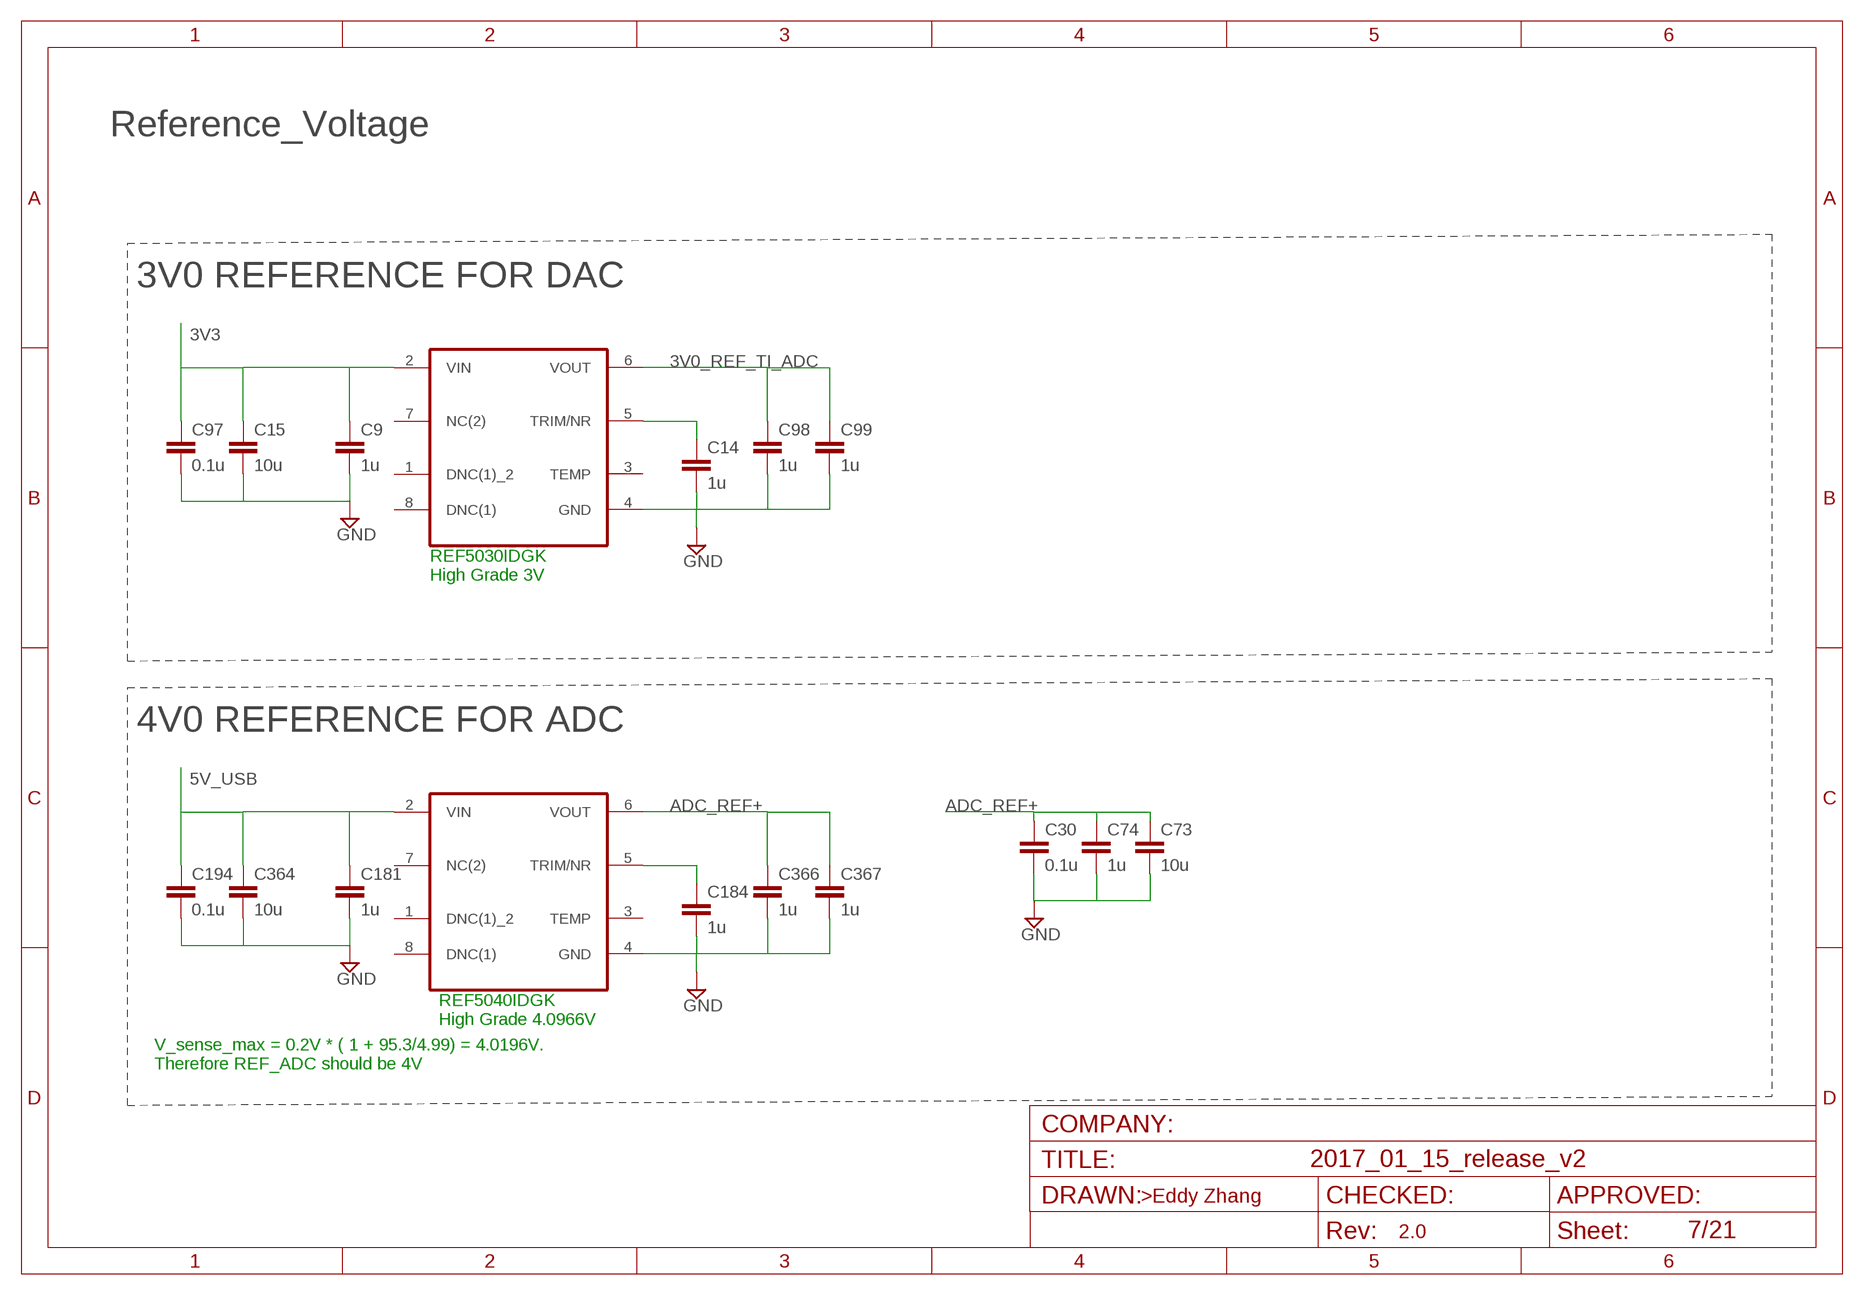
[diagram p6: schematic, sheet 7]

### Parts
C9  1u  C-EUC0603  [C0603]
C14  1u  C-EUC0603K  [C0603K]
C15  10u  C-EUC0805  [C0805]
C30  0.1u  C-EUC0603K  [C0603K]
C73  10u  C-EUC0805K  [C0805K]
C74  1u  C-EUC0603K  [C0603K]
C97  0.1u  C-EUC0603  [C0603]
C98  1u  C-EUC0603  [C0603]
C99  1u  C-EUC0603  [C0603]
C181  1u  C-EUC0603  [C0603]
C184  1u  C-EUC0603  [C0603]
C194  0.1u  C-EUC0603  [C0603]
C364  10u  C-EUC0805  [C0805]
C366  1u  C-EUC0603  [C0603]
C367  1u  C-EUC0603  [C0603]
REF5030  REF5025AID  [SOIC127P600X175-8N]
REF5040  REF5025AID  [SOIC127P600X175-8N]

### Nets
3V0_REF_TI_ADC: C98.1 C99.1 REF5030.6(VOUT) ; also sheet 8,9,10
3V3 [Power]: C9.1 C15.1 C97.1 REF5030.2(VIN) ; also sheet 2,4,5,6,8,9,10,11,12,13,14,15,16,17,18,19,20
5V_USB [Power]: C181.1 C194.1 C364.1 REF5040.2(VIN) ; also sheet 2,3,6
ADC_REF+: C30.1 C73.1 C74.1 C366.1 C367.1 REF5040.6(VOUT) ; also sheet 5
GND [GND]: C9.2 C14.2 C15.2 C30.2 C73.2 C74.2 C97.2 C98.2 C99.2 C181.2 C184.2 C194.2 C364.2 C366.2 C367.2 REF5030.4(GND) REF5040.4(GND) ; also sheet 2,3,4,5,6,8,9,10,11,12,13,14,15,16,17,18,19,20,21
N$5: C14.1 REF5030.5(TRIM/NR)
N$95: C184.1 REF5040.5(TRIM/NR)
Unconnected: REF5030.1(DNC(1)_2) REF5030.3(TEMP) REF5030.7(NC(2)) REF5030.8(DNC(1)) REF5040.1(DNC(1)_2) REF5040.3(TEMP) REF5040.7(NC(2)) REF5040.8(DNC(1))

### Notes on the sheet
- Reference_Voltage
- 3V0 REFERENCE FOR DAC
- REF5030IDGK
  High Grade 3V
- 4V0 REFERENCE FOR ADC
- REF5040IDGK
  High Grade 4.0966V
- V_sense_max = 0.2V * ( 1 + 95.3/4.99) = 4.0196V.  
  Therefore REF_ADC should be 4V
- >Eddy Zhang

## Sheet 8 of 21
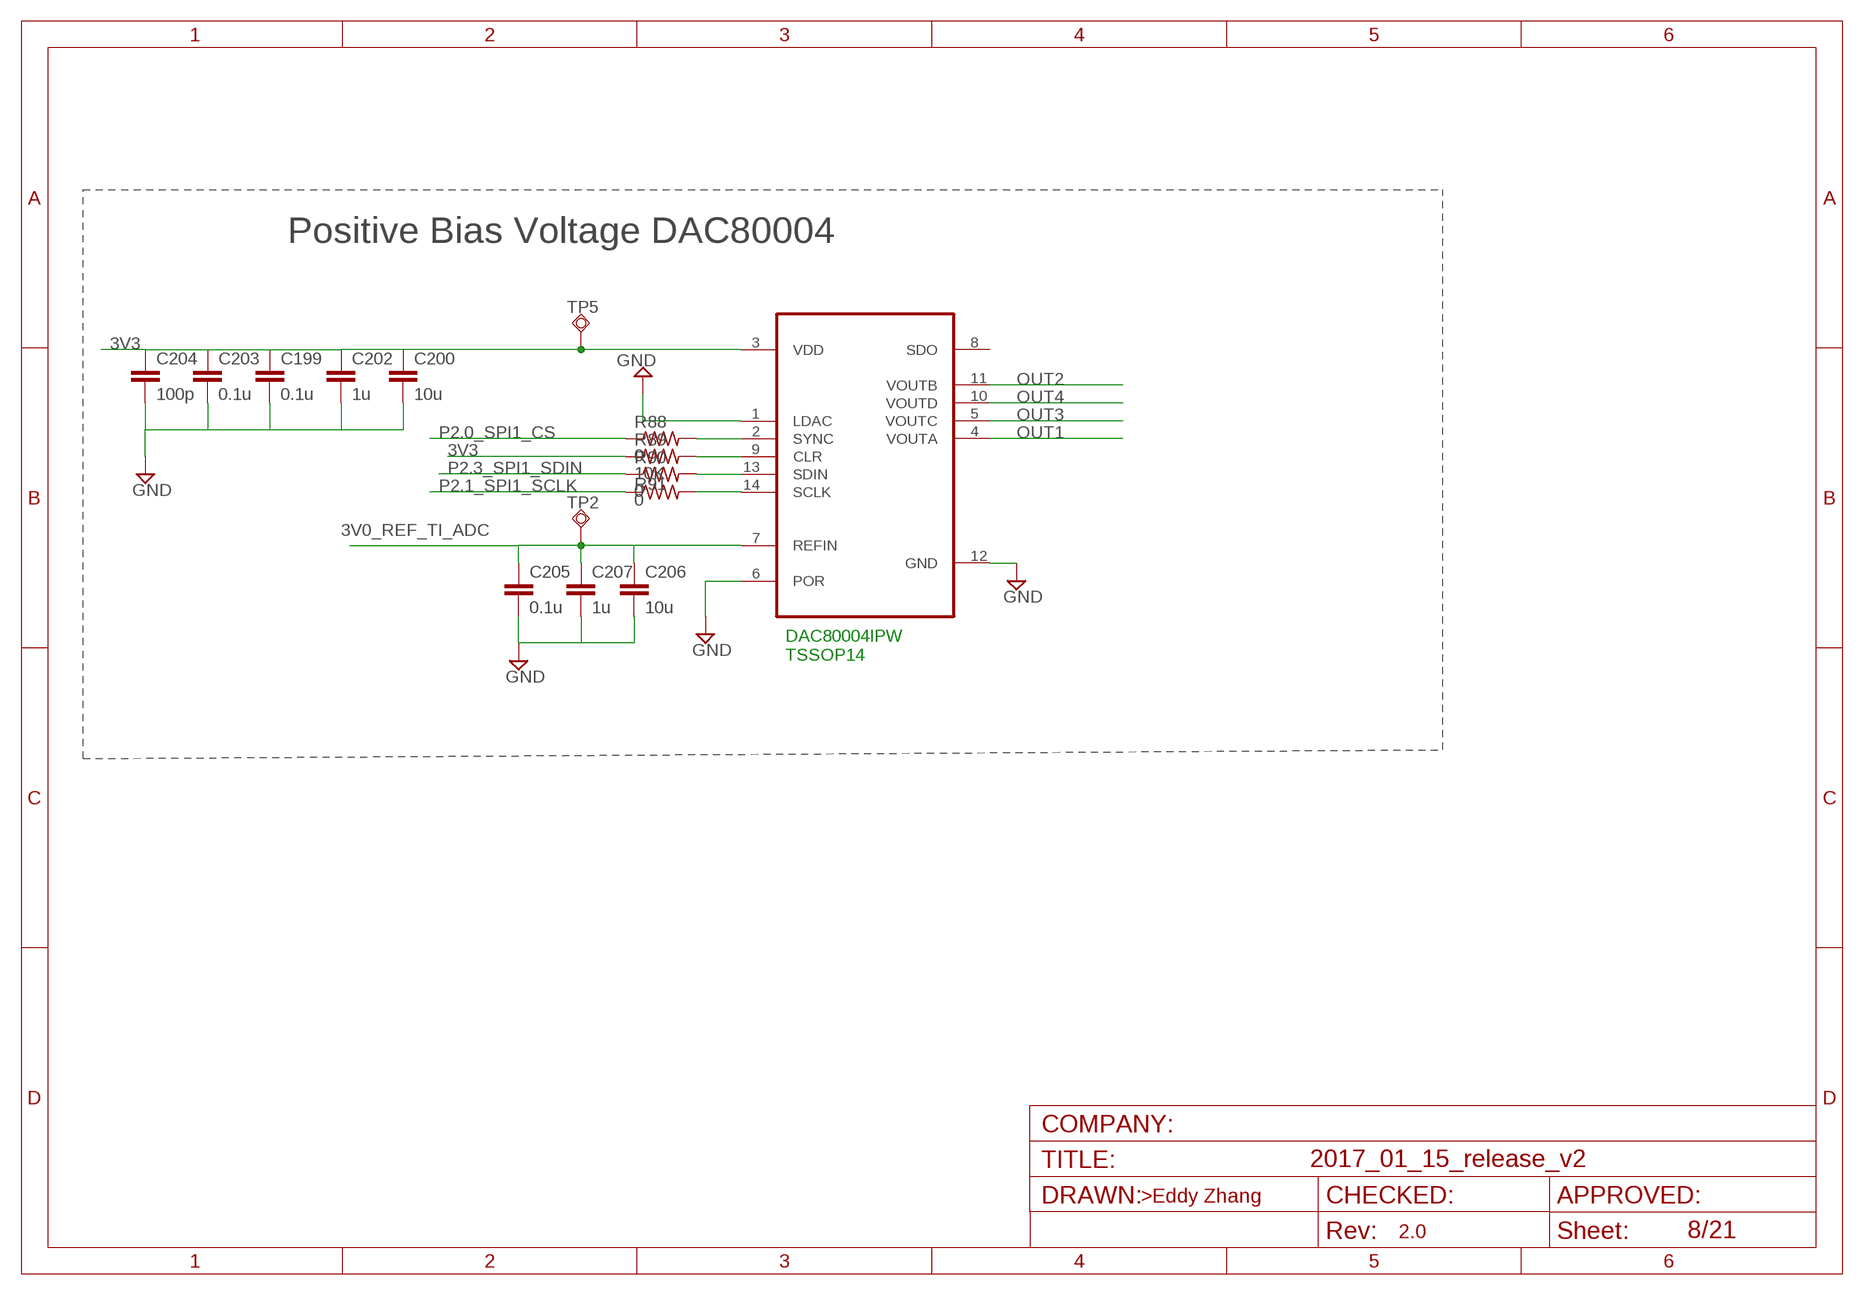
[diagram p7: schematic, sheet 8]

### Parts
C199  0.1u  C-EUC0603K  [C0603K]
C200  10u  C-EUC0805  [C0805]
C202  1u  C-EUC0603  [C0603]
C203  0.1u  C-EUC0603K  [C0603K]
C204  100p  C-EUC0603K  [C0603K]
C205  0.1u  C-EUC0603  [C0603]
C206  10u  C-EUC0805  [C0805]
C207  1u  C-EUC0603  [C0603]
R88  0  R-US_R0603  [R0603]
R89  10K  R-US_R0603  [R0603]
R90  0  R-US_R0603  [R0603]
R91  0  R-US_R0603  [R0603]
TP2  TPSQTP20R  [TP20R]
TP5  TPSQTP20R  [TP20R]
U$11  DAC80004  [TSSOP14]

### Nets
3V0_REF_TI_ADC: C205.1 C206.1 C207.1 TP2.TP U$11.7(REFIN) ; also sheet 7,9,10
3V3 [Power]: C199.1 C200.1 C202.1 C203.1 C204.1 R89.1 TP5.TP U$11.3(VDD) ; also sheet 2,4,5,6,7,9,10,11,12,13,14,15,16,17,18,19,20
GND [GND]: C199.2 C200.2 C202.2 C203.2 C204.2 C205.2 C206.2 C207.2 U$11.1(LDAC) U$11.6(POR) U$11.12(GND) ; also sheet 2,3,4,5,6,7,9,10,11,12,13,14,15,16,17,18,19,20,21
N$231: R90.2 U$11.13(SDIN)
N$232: R91.2 U$11.14(SCLK)
N$233: R89.2 U$11.9(CLR)
N$234: R88.2 U$11.2(SYNC)
OUT1: U$11.4(VOUTA) ; also sheet 21
OUT2: U$11.11(VOUTB) ; also sheet 21
OUT3: U$11.5(VOUTC) ; also sheet 21
OUT4: U$11.10(VOUTD) ; also sheet 21
P2.0_SPI1_CS: R88.1 ; also sheet 5
P2.1_SPI1_SCLK: R91.1 ; also sheet 5
P2.3_SPI1_SDIN: R90.1 ; also sheet 5
Unconnected: U$11.8(SDO)

### Notes on the sheet
- Positive Bias Voltage DAC80004
- DAC80004IPW
  TSSOP14
- >Eddy Zhang

## Sheet 9 of 21
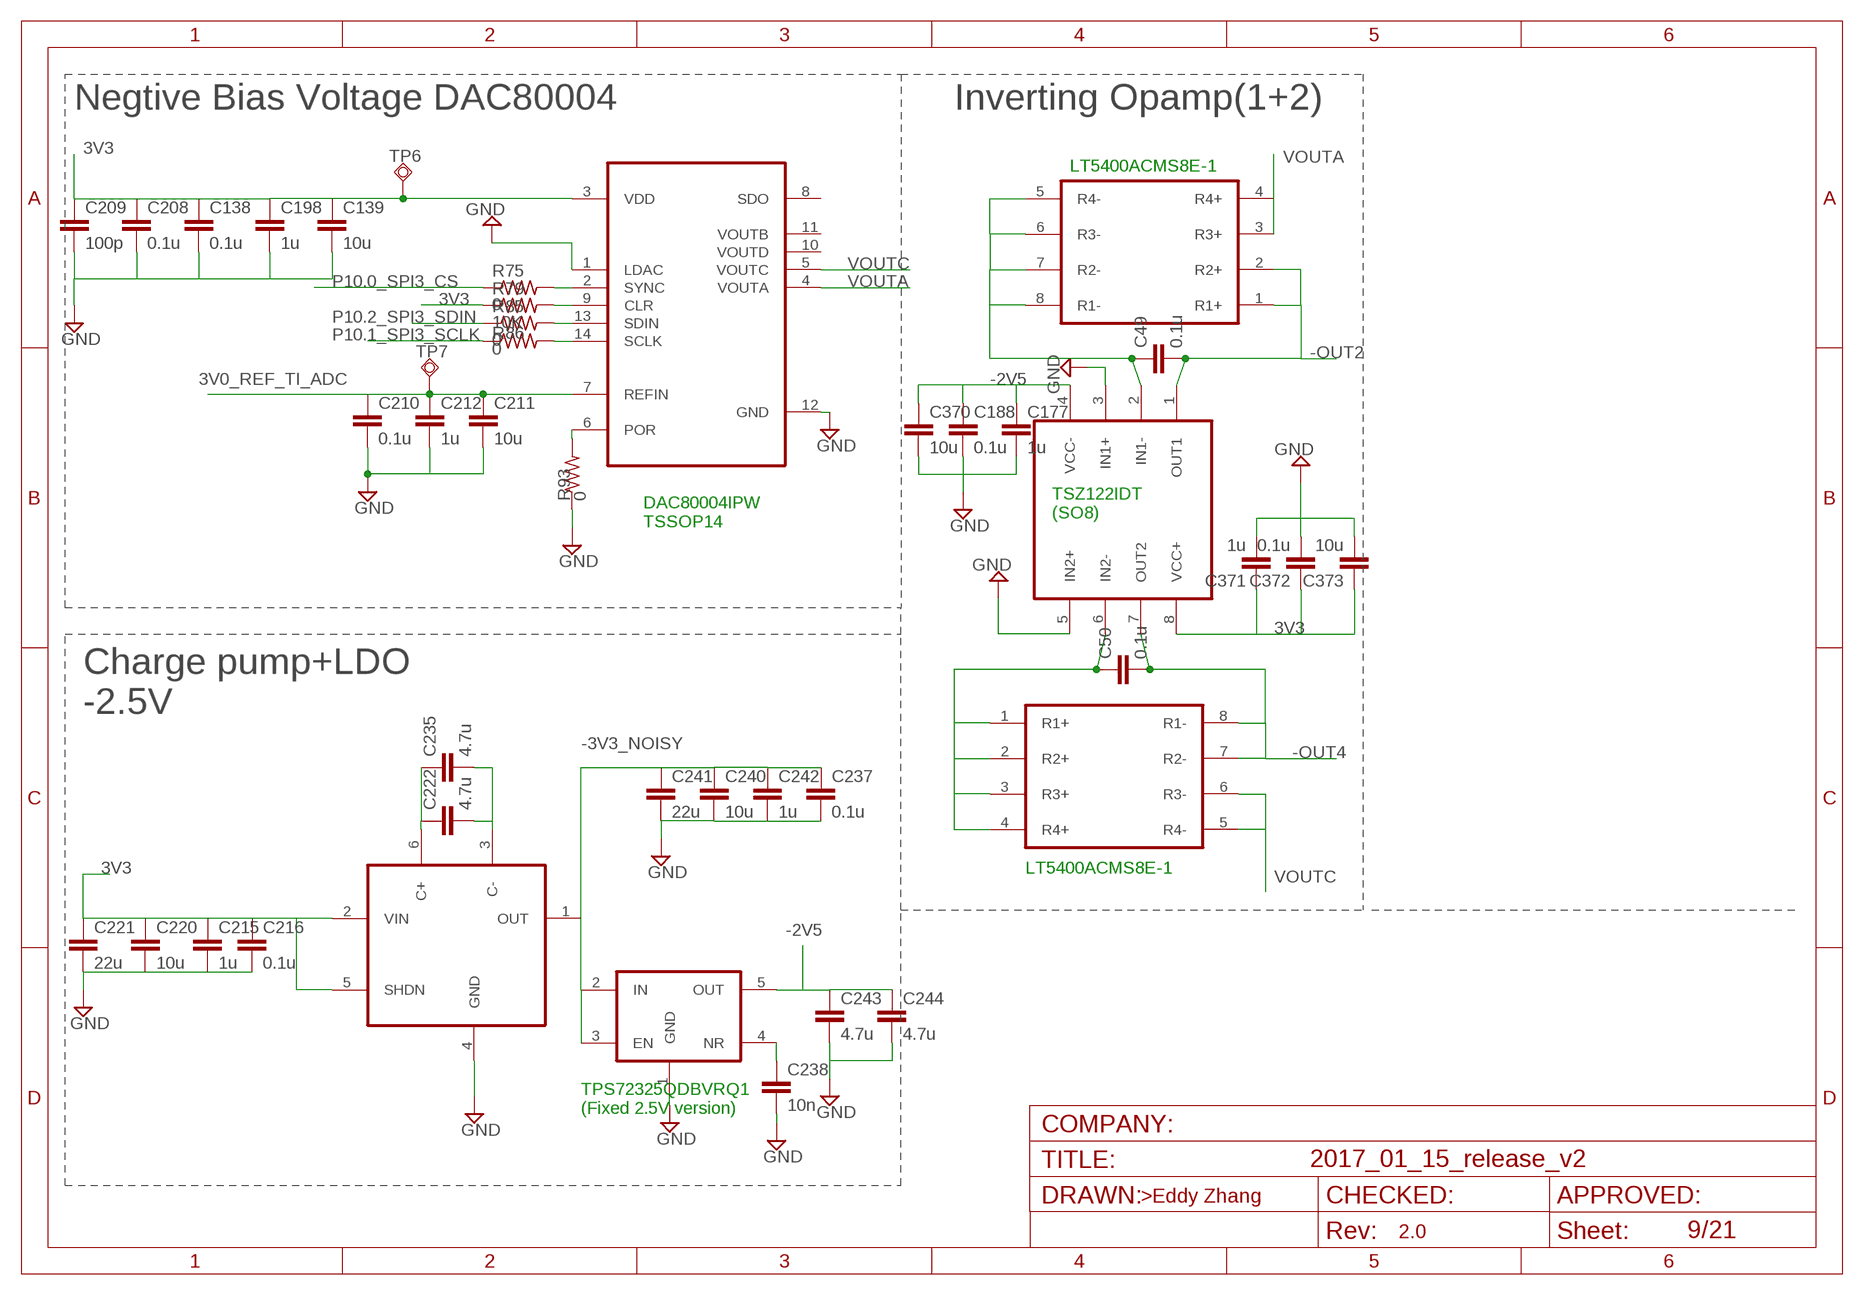
[diagram p8: schematic, sheet 9]

### Parts
C49  0.1u  C-EUC0603  [C0603]
C50  0.1u  C-EUC0603  [C0603]
C138  0.1u  C-EUC0603K  [C0603K]
C139  10u  C-EUC0805  [C0805]
C177  1u  C-EUC0603  [C0603]
C188  0.1u  C-EUC0603  [C0603]
C198  1u  C-EUC0603K  [C0603K]
C208  0.1u  C-EUC0603K  [C0603K]
C209  100p  C-EUC0603K  [C0603K]
C210  0.1u  C-EUC0603  [C0603]
C211  10u  C-EUC0805  [C0805]
C212  1u  C-EUC0603  [C0603]
C215  1u  C-EUC0603  [C0603]
C216  0.1u  C-EUC0603K  [C0603K]
C220  10u  C-EUC0805  [C0805]
C221  22u  C-EUC1206K  [C1206K]
C222  4.7u  C-EUC0805  [C0805]
C235  4.7u  C-EUC0805  [C0805]
C237  0.1u  C-EUC0603  [C0603]
C238  10n  C-EUC0603  [C0603]
C240  10u  C-EUC0805  [C0805]
C241  22u  C-EUC1206K  [C1206K]
C242  1u  C-EUC0603  [C0603]
C243  4.7u  C-EUC0805  [C0805]
C244  4.7u  C-EUC0805  [C0805]
C370  10u  C-EUC0805  [C0805]
C371  1u  C-EUC0603  [C0603]
C372  0.1u  C-EUC0603  [C0603]
C373  10u  C-EUC0805  [C0805]
R75  0  R-US_R0603  [R0603]
R79  10K  R-US_R0603  [R0603]
R85  0  R-US_R0603  [R0603]
R86  0  R-US_R0603  [R0603]
R93  0  R-US_R0603  [R0603]
TP6  TPSQTP20R  [TP20R]
TP7  TPSQTP20R  [TP20R]
U$12  DAC80004  [TSSOP14]
U$41  LT5400  [MSOP8]
U$42  TSZ122  [SO08]
U$45  LT5400  [MSOP8]
U$56  MAX1697  [SOT23-6]
U$57  TPS723-Q1  [SOT23-5]

### Nets
3V0_REF_TI_ADC: C210.1 C211.1 C212.1 TP7.TP U$12.7(REFIN) ; also sheet 7,8,10
3V3 [Power]: C138.1 C139.1 C198.1 C208.1 C209.1 C215.1 C216.1 C220.1 C221.1 C371.1 C372.1 C373.1 R79.1 TP6.TP U$12.3(VDD) U$42.8(VCC+) U$56.2(VIN) U$56.5(SHDN) ; also sheet 2,4,5,6,7,8,10,11,12,13,14,15,16,17,18,19,20
-2V5: C177.1 C188.1 C243.1 C244.1 C370.1 U$42.4(VCC-) U$57.5(OUT)
-3V3_NOISY: C237.1 C240.1 C241.1 C242.1 U$56.1(OUT) U$57.2(IN) U$57.3(EN)
-OUT2: C49.2 U$41.1(R1+) U$41.2(R2+) U$42.1(OUT1) ; also sheet 21
-OUT4: C50.2 U$42.7(OUT2) U$45.7(R2-) U$45.8(R1-) ; also sheet 21
GND [GND]: C138.2 C139.2 C177.2 C188.2 C198.2 C208.2 C209.2 C210.2 C211.2 C212.2 C215.2 C216.2 C220.2 C221.2 C237.2 C238.2 C240.2 C241.2 C242.2 C243.2 C244.2 C370.2 C371.2 C372.2 C373.2 R93.1 U$12.1(LDAC) U$12.12(GND) U$42.3(IN1+) U$42.5(IN2+) U$56.4(GND) U$57.1(GND) ; also sheet 2,3,4,5,6,7,8,10,11,12,13,14,15,16,17,18,19,20,21
N$101: R93.2 U$12.6(POR)
N$104: C238.1 U$57.4(NR)
N$107: R75.2 U$12.2(SYNC)
N$108: R79.2 U$12.9(CLR)
N$109: R85.2 U$12.13(SDIN)
N$110: R86.2 U$12.14(SCLK)
N$111: C49.1 U$41.5(R4-) U$41.6(R3-) U$41.7(R2-) U$41.8(R1-) U$42.2(IN1-)
N$112: C222.1 C235.1 U$56.6(C+)
N$114: C222.2 C235.2 U$56.3(C-)
N$117: C50.1 U$42.6(IN2-) U$45.1(R1+) U$45.2(R2+) U$45.3(R3+) U$45.4(R4+)
P10.0_SPI3_CS: R75.1 ; also sheet 5
P10.1_SPI3_SCLK: R86.1 ; also sheet 5
P10.2_SPI3_SDIN: R85.1 ; also sheet 5
VOUTA: U$12.4(VOUTA) U$41.3(R3+) U$41.4(R4+)
VOUTC: U$12.5(VOUTC) U$45.5(R4-) U$45.6(R3-)
Unconnected: U$12.8(SDO) U$12.10(VOUTD) U$12.11(VOUTB)

### Notes on the sheet
- Negtive Bias Voltage DAC80004 | Inverting Opamp(1+2)
- LT5400ACMS8E-1
- TSZ122IDT
  (SO8)
- DAC80004IPW
  TSSOP14
- Charge pump+LDO
  -2.5V
- LT5400ACMS8E-1
- TPS72325QDBVRQ1
  (Fixed 2.5V version)
- >Eddy Zhang

## Sheet 10 of 21
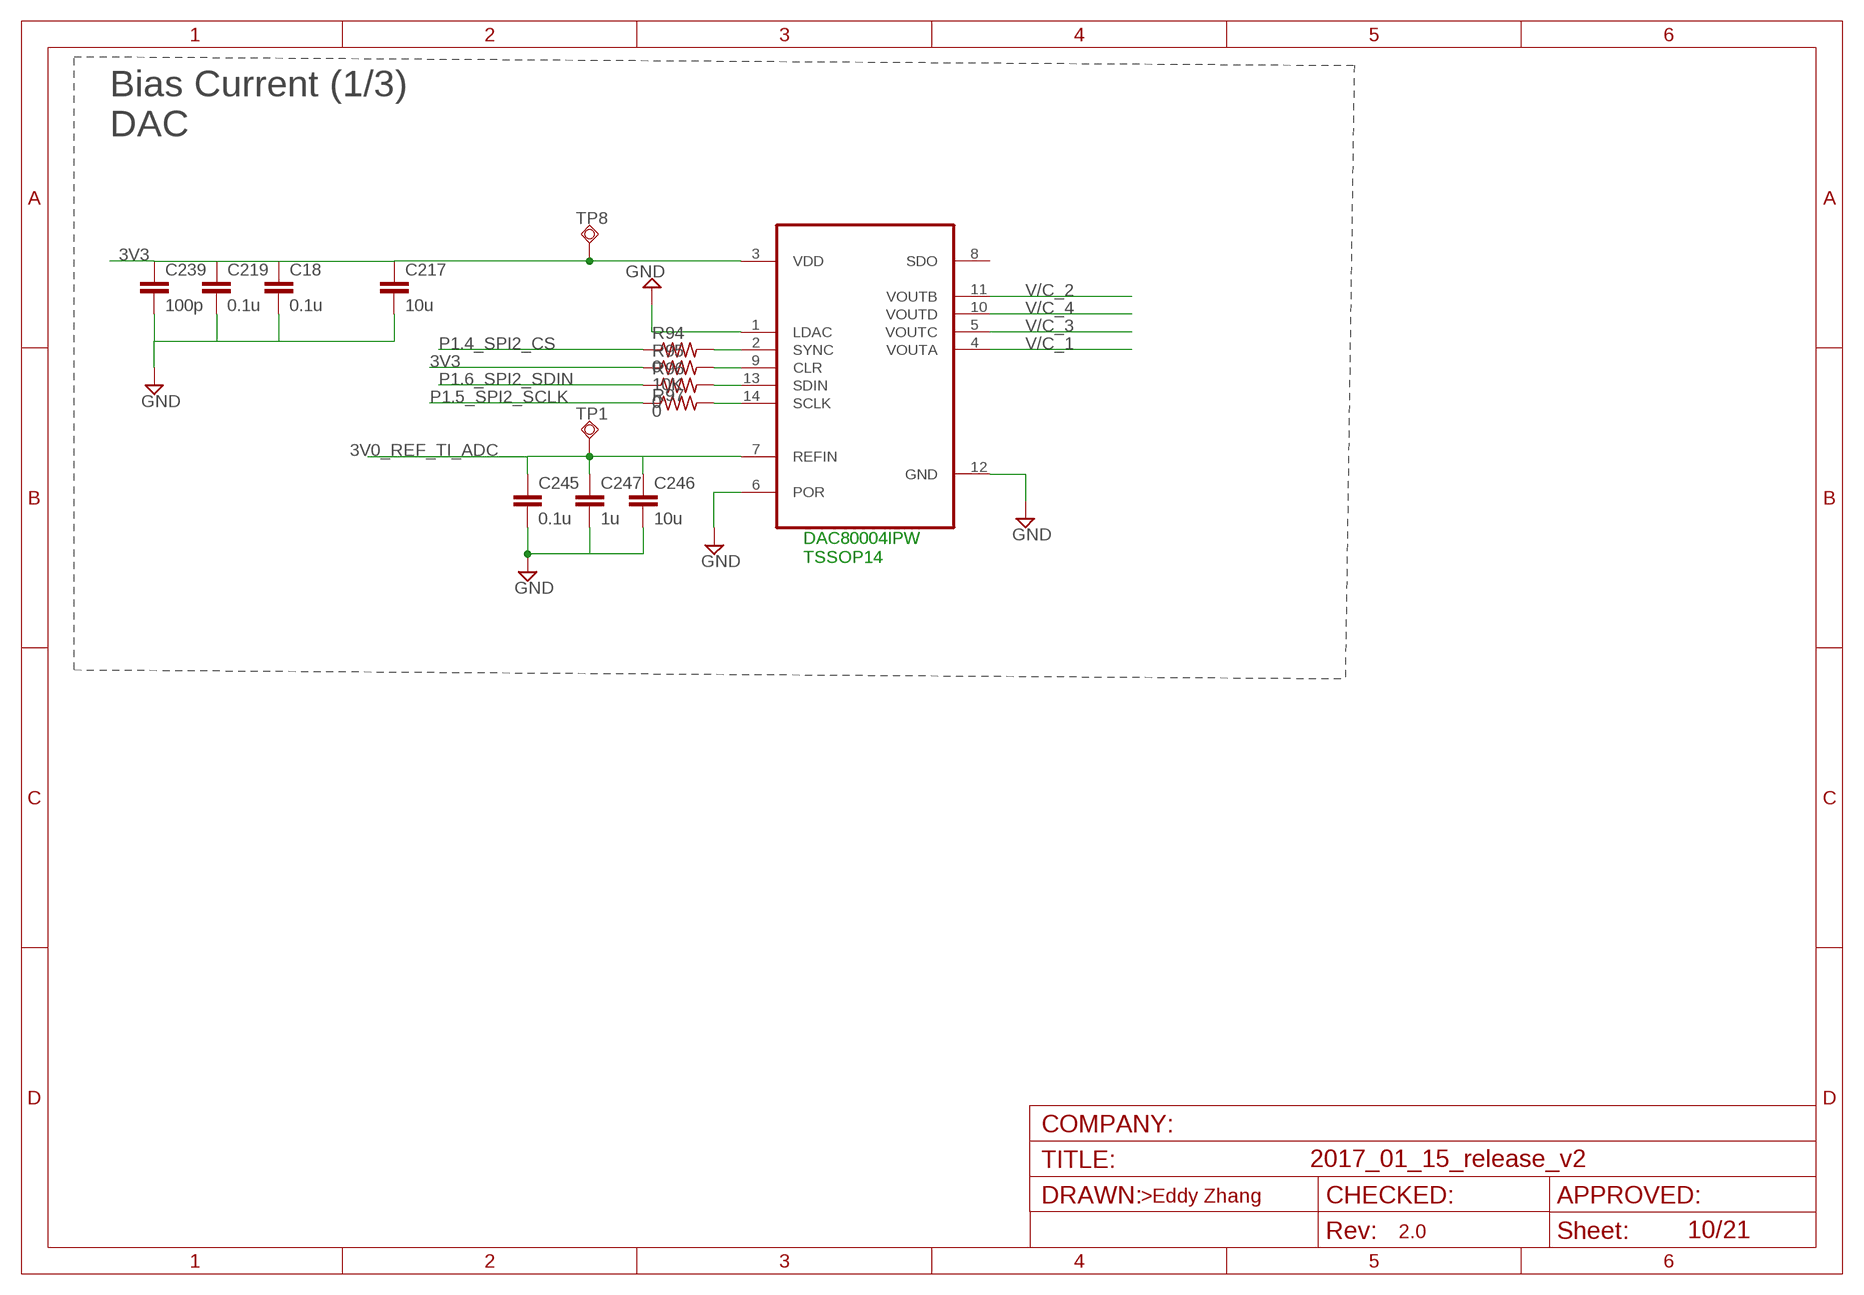
[diagram p9: schematic, sheet 10]

### Parts
C18  0.1u  C-EUC0603K  [C0603K]
C217  10u  C-EUC0805K  [C0805K]
C219  0.1u  C-EUC0603K  [C0603K]
C239  100p  C-EUC0603  [C0603]
C245  0.1u  C-EUC0603  [C0603]
C246  10u  C-EUC0805  [C0805]
C247  1u  C-EUC0603  [C0603]
R94  0  R-US_R0603  [R0603]
R95  10K  R-US_R0603  [R0603]
R96  0  R-US_R0603  [R0603]
R97  0  R-US_R0603  [R0603]
TP1  TPSQTP20R  [TP20R]
TP8  TPSQTP20R  [TP20R]
U$14  DAC80004  [TSSOP14]

### Nets
3V0_REF_TI_ADC: C245.1 C246.1 C247.1 TP1.TP U$14.7(REFIN) ; also sheet 7,8,9
3V3 [Power]: C18.1 C217.1 C219.1 C239.1 R95.1 TP8.TP U$14.3(VDD) ; also sheet 2,4,5,6,7,8,9,11,12,13,14,15,16,17,18,19,20
GND [GND]: C18.2 C217.2 C219.2 C239.2 C245.2 C246.2 C247.2 U$14.1(LDAC) U$14.6(POR) U$14.12(GND) ; also sheet 2,3,4,5,6,7,8,9,11,12,13,14,15,16,17,18,19,20,21
N$113: R97.2 U$14.14(SCLK)
N$116: R94.2 U$14.2(SYNC)
N$118: R95.2 U$14.9(CLR)
N$134: R96.2 U$14.13(SDIN)
P1.4_SPI2_CS: R94.1 ; also sheet 5
P1.5_SPI2_SCLK: R97.1 ; also sheet 5
P1.6_SPI2_SDIN: R96.1 ; also sheet 5
V/C_1: U$14.4(VOUTA) ; also sheet 11
V/C_2: U$14.11(VOUTB) ; also sheet 11
V/C_3: U$14.5(VOUTC) ; also sheet 12
V/C_4: U$14.10(VOUTD) ; also sheet 12
Unconnected: U$14.8(SDO)

### Notes on the sheet
- Bias Current (1/3)
  DAC
- DAC80004IPW
  TSSOP14
- >Eddy Zhang

## Sheet 11 of 21
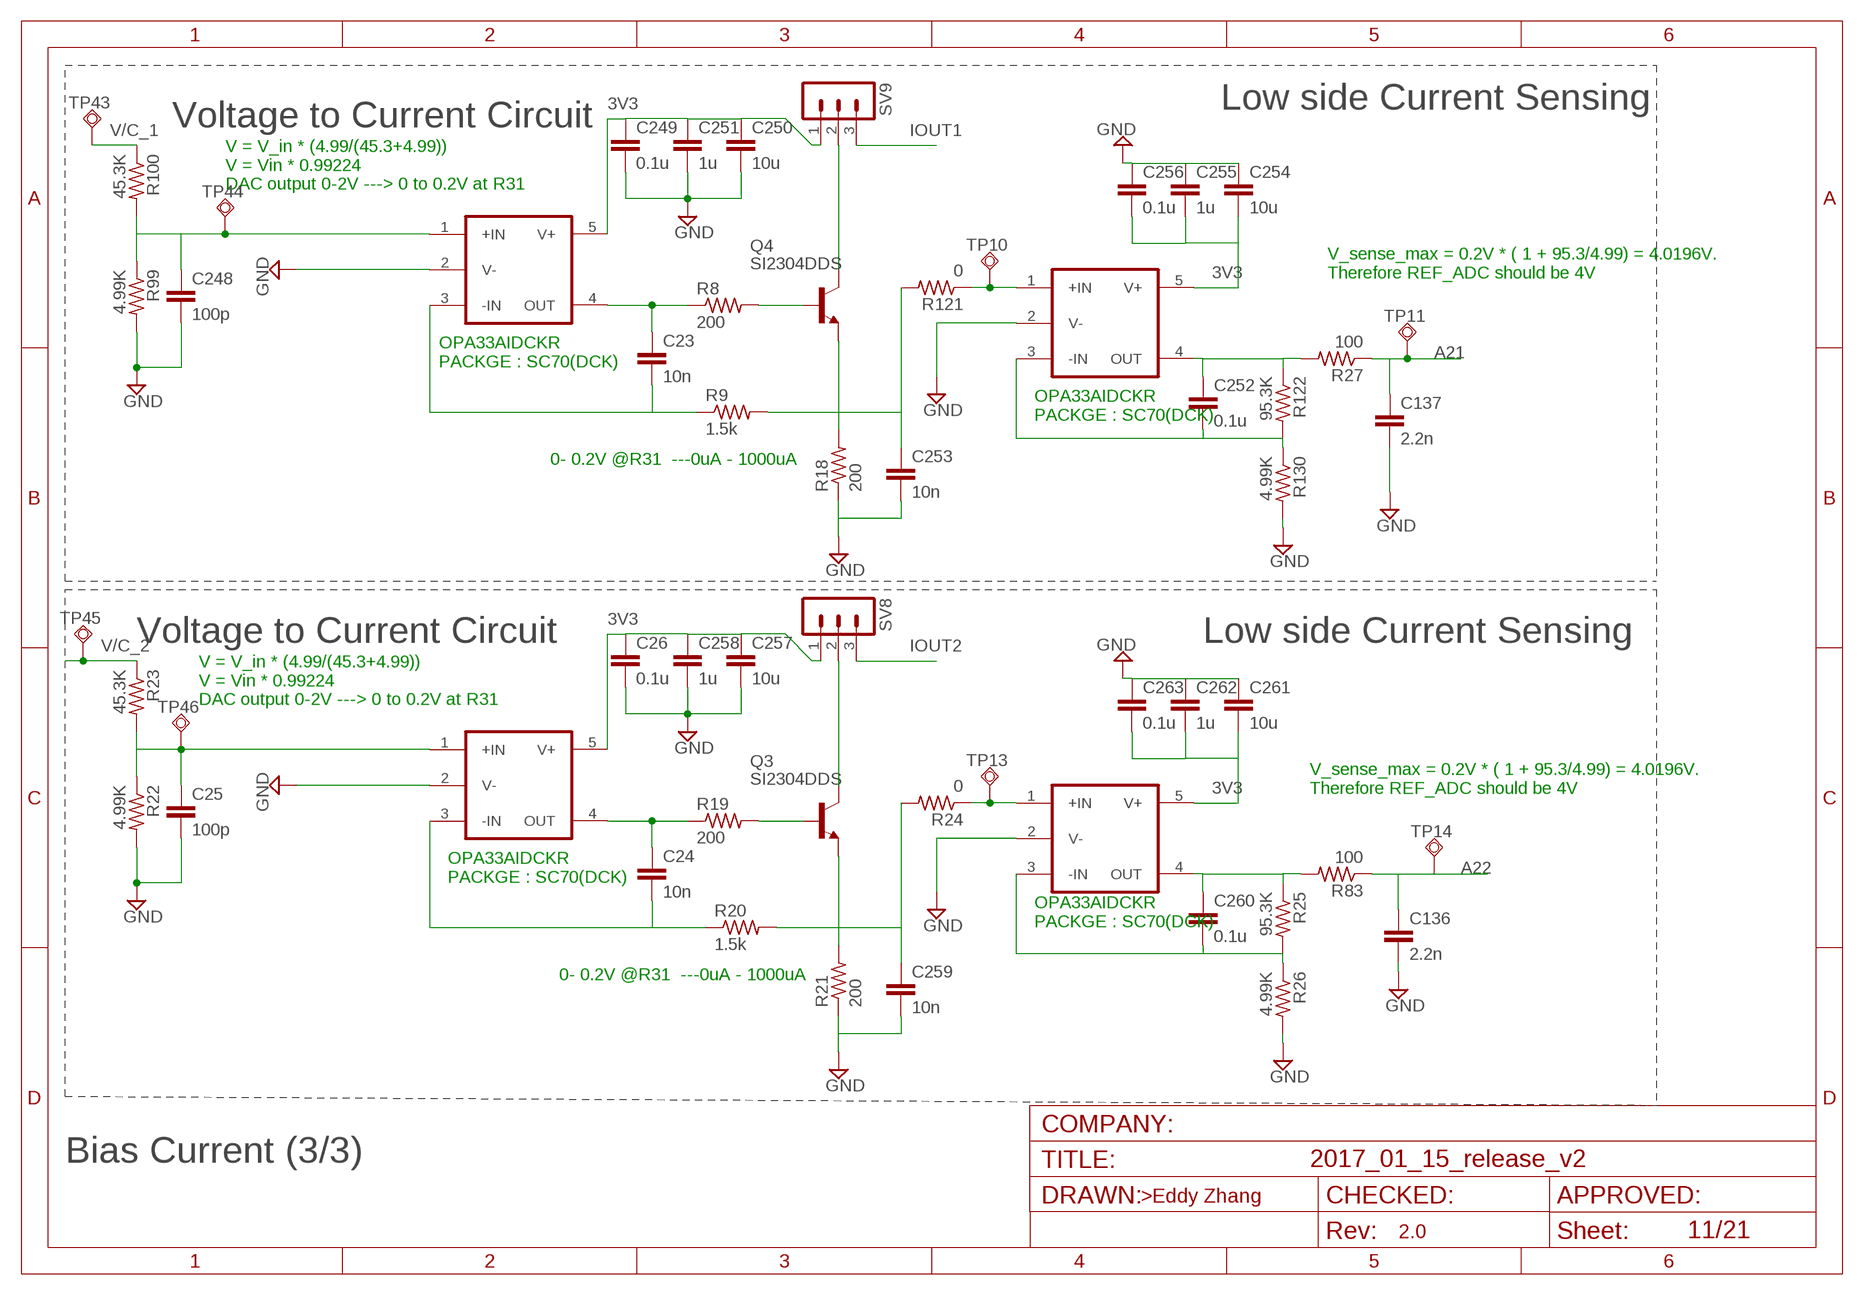
[diagram p10: schematic, sheet 11]

### Parts
C23  10n  C-EUC0603  [C0603]
C24  10n  C-EUC0603  [C0603]
C25  100p  C-EUC0603  [C0603]
C26  0.1u  C-EUC0603  [C0603]
C136  2.2n  C-EUC0603  [C0603]
C137  2.2n  C-EUC0603  [C0603]
C248  100p  C-EUC0603  [C0603]
C249  0.1u  C-EUC0603  [C0603]
C250  10u  C-EUC0805  [C0805]
C251  1u  C-EUC0603  [C0603]
C252  0.1u  C-EUC0603  [C0603]
C253  10n  C-EUC0603  [C0603]
C254  10u  C-EUC0805  [C0805]
C255  1u  C-EUC0603  [C0603]
C256  0.1u  C-EUC0603  [C0603]
C257  10u  C-EUC0805  [C0805]
C258  1u  C-EUC0603  [C0603]
C259  10n  C-EUC0603  [C0603]
C260  0.1u  C-EUC0603  [C0603]
C261  10u  C-EUC0805  [C0805]
C262  1u  C-EUC0603  [C0603]
C263  0.1u  C-EUC0603  [C0603]
Q3  SI2304DDS  BC849SMD  [SOT23-BEC]
Q4  SI2304DDS  BC849SMD  [SOT23-BEC]
R8  200  R-US_R0805  [R0805]
R9  1.5k  R-US_R0603  [R0603]
R18  200  R-US_R0805  [R0805]
R19  200  R-US_R0805  [R0805]
R20  1.5k  R-US_R0805  [R0805]
R21  200  R-US_R0805  [R0805]
R22  4.99K  R-US_R0603  [R0603]
R23  45.3K  R-US_R0603  [R0603]
R24  0  R-US_R0603  [R0603]
R25  95.3K  R-US_R0603  [R0603]
R26  4.99K  R-US_R0603  [R0603]
R27  100  R-US_R0603  [R0603]
R83  100  R-US_R0603  [R0603]
R99  4.99K  R-US_R0603  [R0603]
R100  45.3K  R-US_R0603  [R0603]
R121  0  R-US_R0603  [R0603]
R122  95.3K  R-US_R0603  [R0603]
R130  4.99K  R-US_R0603  [R0603]
SV8  MA03-1  [MA03-1]
SV9  MA03-1  [MA03-1]
TP10  TPSQTP20R  [TP20R]
TP11  TPSQTP20R  [TP20R]
TP13  TPSQTP20R  [TP20R]
TP14  TPSQTP20R  [TP20R]
TP43  TPSQTP20R  [TP20R]
TP44  TPSQTP20R  [TP20R]
TP45  TPSQTP20R  [TP20R]
TP46  TPSQTP20R  [TP20R]
U$15  OPA333DVT  [SC70]
U$16  OPA333DVT  [SC70]
U$58  OPA333DVT  [SC70]
U$59  OPA333DVT  [SC70]

### Nets
3V3 [Power]: C26.1 C249.1 C250.1 C251.1 C254.2 C255.2 C256.2 C257.1 C258.1 C261.2 C262.2 C263.2 SV8.1 SV9.1 U$15.5(V+) U$16.5(V+) U$58.5(V+) U$59.5(V+) ; also sheet 2,4,5,6,7,8,9,10,12,13,14,15,16,17,18,19,20
A21: C137.1 R27.1 TP11.TP ; also sheet 5
A22: C136.1 R83.1 TP14.TP ; also sheet 5
GND [GND]: C25.2 C26.2 C136.2 C137.2 C248.2 C249.2 C250.2 C251.2 C253.2 C254.1 C255.1 C256.1 C257.2 C258.2 C259.2 C261.1 C262.1 C263.1 R18.1 R21.1 R22.2 R26.2 R99.2 R130.2 U$15.2(V-) U$16.2(V-) U$58.2(V-) U$59.2(V-) ; also sheet 2,3,4,5,6,7,8,9,10,12,13,14,15,16,17,18,19,20,21
IOUT1: SV9.3 ; also sheet 21
IOUT2: SV8.3 ; also sheet 21
N$40: Q3.B R19.2
N$44: C248.1 R99.1 R100.2 TP44.TP U$15.1(+IN)
N$48: Q4.B R8.2
N$50: Q4.C SV9.2
N$51: C23.2 R9.1 U$15.3(-IN)
N$52: Q3.C SV8.2
N$53: C25.1 R22.1 R23.2 TP46.TP U$58.1(+IN)
N$54: C24.1 R19.1 U$58.4(OUT)
N$56: C259.1 Q3.E R20.2 R21.2 R24.2
N$57: C24.2 R20.1 U$58.3(-IN)
N$58: R24.1 TP13.TP U$59.1(+IN)
N$60: C260.2 R25.2 R26.1 U$59.3(-IN)
N$61: C260.1 R25.1 R83.2 U$59.4(OUT)
N$135: C23.1 R8.1 U$15.4(OUT)
N$136: C253.1 Q4.E R9.2 R18.2 R121.2
N$137: R121.1 TP10.TP U$16.1(+IN)
N$138: C252.2 R122.2 R130.1 U$16.3(-IN)
N$139: C252.1 R27.2 R122.1 U$16.4(OUT)
V/C_1: R100.1 TP43.TP ; also sheet 10
V/C_2: R23.1 TP45.TP ; also sheet 10

### Notes on the sheet
- Low side Current Sensing
- Voltage to Current Circuit
- V = V_in * (4.99/(45.3+4.99))
  V = Vin * 0.99224
  DAC output 0-2V ---> 0 to 0.2V at R31
- V_sense_max = 0.2V * ( 1 + 95.3/4.99) = 4.0196V.  
  Therefore REF_ADC should be 4V
- OPA33AIDCKR
  PACKGE : SC70(DCK)
- OPA33AIDCKR
  PACKGE : SC70(DCK)
- 0- 0.2V @R31  ---0uA - 1000uA
- Voltage to Current Circuit | Low side Current Sensing
- V = V_in * (4.99/(45.3+4.99))
  V = Vin * 0.99224
  DAC output 0-2V ---> 0 to 0.2V at R31
- V_sense_max = 0.2V * ( 1 + 95.3/4.99) = 4.0196V.  
  Therefore REF_ADC should be 4V
- OPA33AIDCKR
  PACKGE : SC70(DCK)
- OPA33AIDCKR
  PACKGE : SC70(DCK)
- 0- 0.2V @R31  ---0uA - 1000uA
- Bias Current (3/3) | >Eddy Zhang

## Sheet 12 of 21
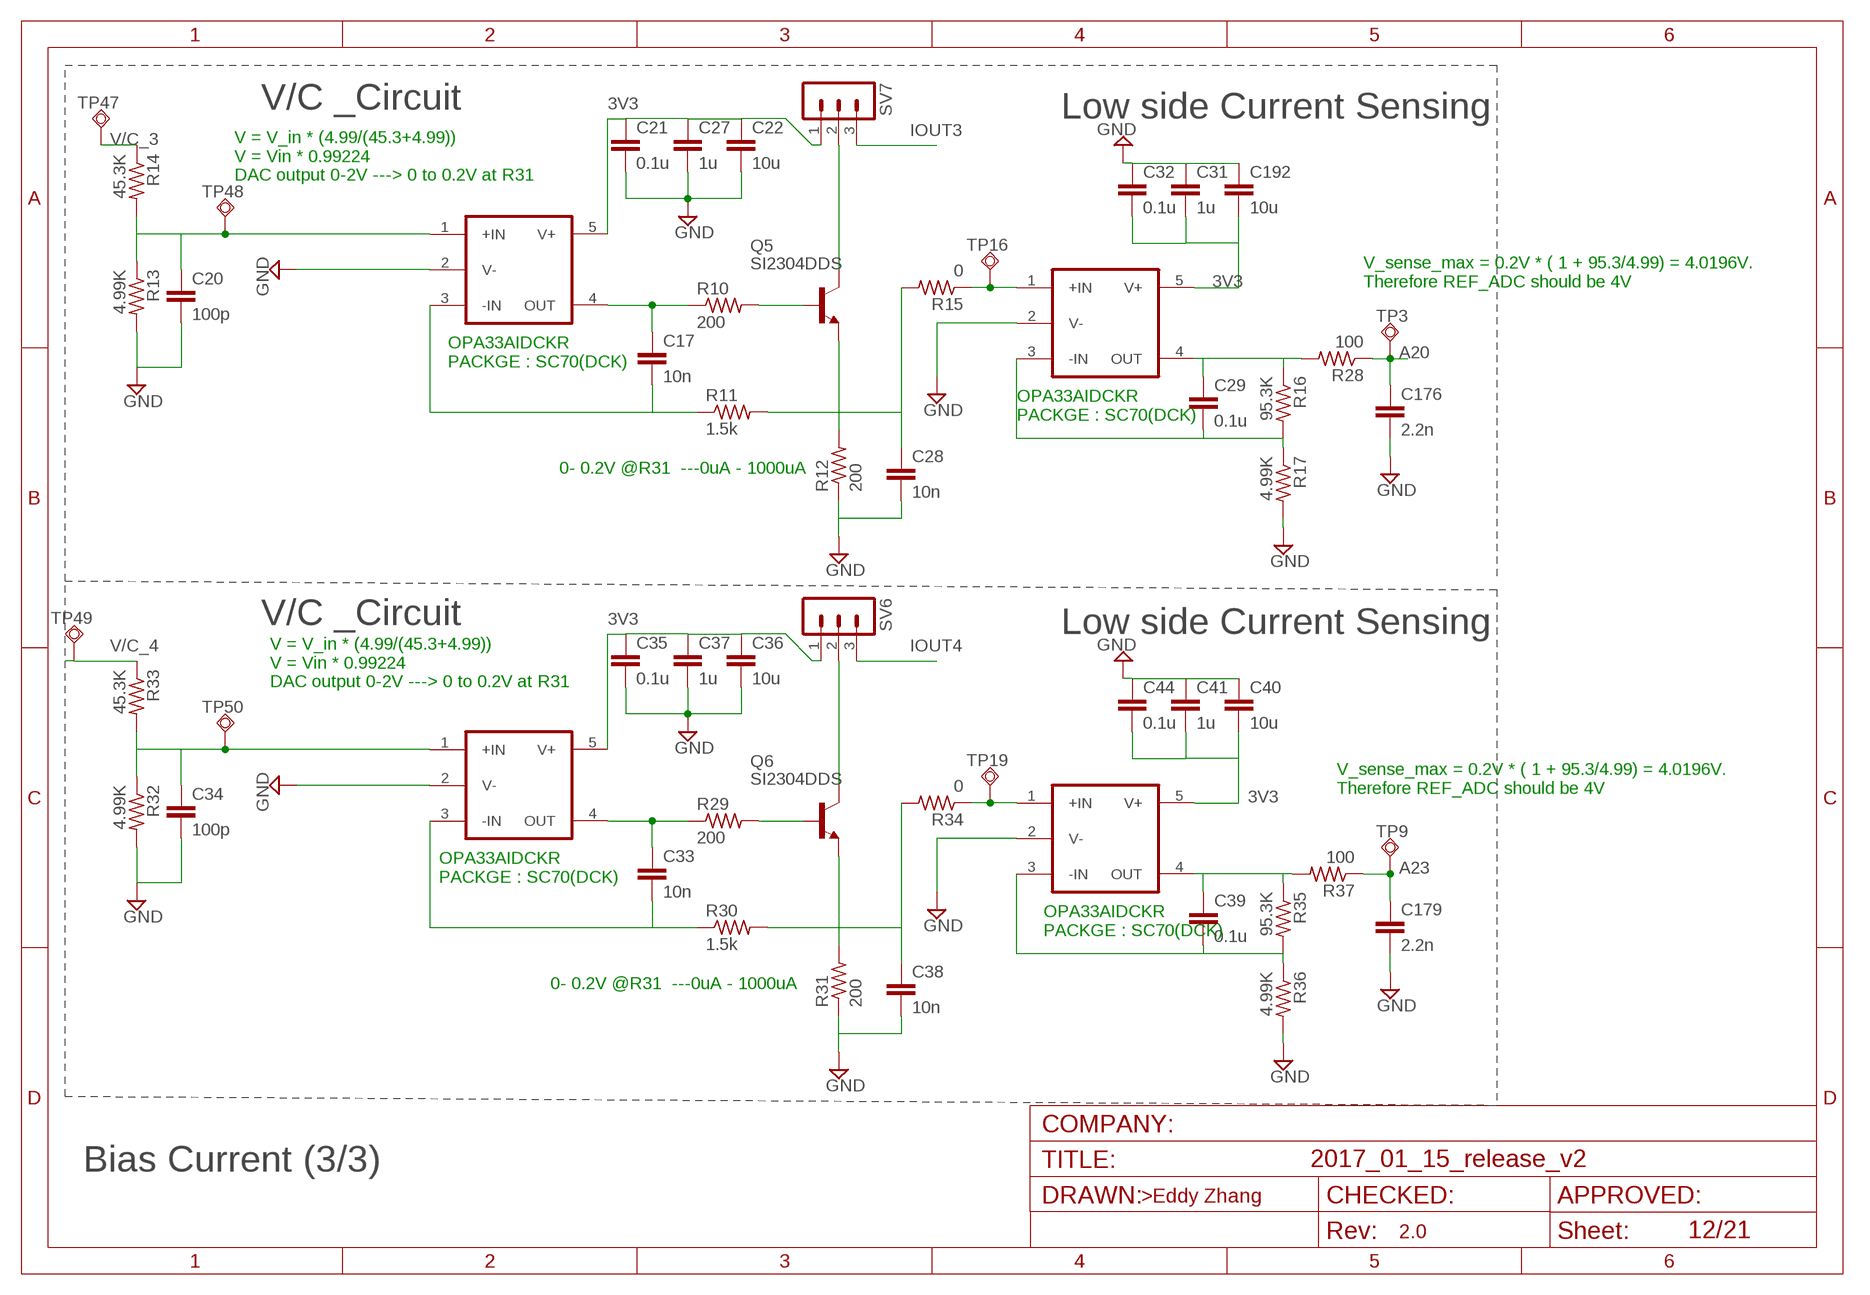
[diagram p11: schematic, sheet 12]

### Parts
C17  10n  C-EUC0603  [C0603]
C20  100p  C-EUC0603  [C0603]
C21  0.1u  C-EUC0603K  [C0603K]
C22  10u  C-EUC0805  [C0805]
C27  1u  C-EUC0603  [C0603]
C28  10n  C-EUC0603  [C0603]
C29  0.1u  C-EUC0603  [C0603]
C31  1u  C-EUC0603  [C0603]
C32  0.1u  C-EUC0603  [C0603]
C33  10n  C-EUC0603  [C0603]
C34  100p  C-EUC0603  [C0603]
C35  0.1u  C-EUC0603  [C0603]
C36  10u  C-EUC0805  [C0805]
C37  1u  C-EUC0603  [C0603]
C38  10n  C-EUC0603  [C0603]
C39  0.1u  C-EUC0603  [C0603]
C40  10u  C-EUC0805  [C0805]
C41  1u  C-EUC0603  [C0603]
C44  0.1u  C-EUC0603  [C0603]
C176  2.2n  C-EUC0603  [C0603]
C179  2.2n  C-EUC0603  [C0603]
C192  10u  C-EUC0805  [C0805]
Q5  SI2304DDS  BC849SMD  [SOT23-BEC]
Q6  SI2304DDS  BC849SMD  [SOT23-BEC]
R10  200  R-US_R0805  [R0805]
R11  1.5k  R-US_R0603  [R0603]
R12  200  R-US_R0805  [R0805]
R13  4.99K  R-US_R0603  [R0603]
R14  45.3K  R-US_R0603  [R0603]
R15  0  R-US_R0603  [R0603]
R16  95.3K  R-US_R0603  [R0603]
R17  4.99K  R-US_R0603  [R0603]
R28  100  R-US_R0603  [R0603]
R29  200  R-US_R0805  [R0805]
R30  1.5k  R-US_R0603  [R0603]
R31  200  R-US_R0805  [R0805]
R32  4.99K  R-US_R0603  [R0603]
R33  45.3K  R-US_R0603  [R0603]
R34  0  R-US_R0603  [R0603]
R35  95.3K  R-US_R0603  [R0603]
R36  4.99K  R-US_R0603  [R0603]
R37  100  R-US_R0603  [R0603]
SV6  MA03-1  [MA03-1]
SV7  MA03-1  [MA03-1]
TP3  TPSQTP20R  [TP20R]
TP9  TPSQTP20R  [TP20R]
TP16  TPSQTP20R  [TP20R]
TP19  TPSQTP20R  [TP20R]
TP47  TPSQTP20R  [TP20R]
TP48  TPSQTP20R  [TP20R]
TP49  TPSQTP20R  [TP20R]
TP50  TPSQTP20R  [TP20R]
U$17  OPA333DVT  [SC70]
U$18  OPA333DVT  [SC70]
U$19  OPA333DVT  [SC70]
U$20  OPA333DVT  [SC70]

### Nets
3V3 [Power]: C21.1 C22.1 C27.1 C31.2 C32.2 C35.1 C36.1 C37.1 C40.2 C41.2 C44.2 C192.2 SV6.1 SV7.1 U$17.5(V+) U$18.5(V+) U$19.5(V+) U$20.5(V+) ; also sheet 2,4,5,6,7,8,9,10,11,13,14,15,16,17,18,19,20
A20: C176.1 R28.1 TP3.TP ; also sheet 5
A23: C179.1 R37.1 TP9.TP ; also sheet 5
GND [GND]: C20.2 C21.2 C22.2 C27.2 C28.2 C31.1 C32.1 C34.2 C35.2 C36.2 C37.2 C38.2 C40.1 C41.1 C44.1 C176.2 C179.2 C192.1 R12.1 R13.2 R17.2 R31.1 R32.2 R36.2 U$17.2(V-) U$18.2(V-) U$19.2(V-) U$20.2(V-) ; also sheet 2,3,4,5,6,7,8,9,10,11,13,14,15,16,17,18,19,20,21
IOUT3: SV7.3 ; also sheet 21
IOUT4: SV6.3 ; also sheet 21
N$39: Q5.B R10.2
N$41: Q5.C SV7.2
N$42: C20.1 R13.1 R14.2 TP48.TP U$17.1(+IN)
N$43: C17.1 R10.1 U$17.4(OUT)
N$45: C28.1 Q5.E R11.2 R12.2 R15.2
N$49: C17.2 R11.1 U$17.3(-IN)
N$55: R15.1 TP16.TP U$18.1(+IN)
N$59: C39.2 R35.2 R36.1 U$20.3(-IN)
N$89: C29.2 R16.2 R17.1 U$18.3(-IN)
N$94: C29.1 R16.1 R28.2 U$18.4(OUT)
N$143: Q6.B R29.2
N$145: C34.1 R32.1 R33.2 TP50.TP U$19.1(+IN)
N$146: C33.1 R29.1 U$19.4(OUT)
N$147: C38.1 Q6.E R30.2 R31.2 R34.2
N$148: C33.2 R30.1 U$19.3(-IN)
N$149: R34.1 TP19.TP U$20.1(+IN)
N$153: Q6.C SV6.2
N$220: C39.1 R35.1 R37.2 U$20.4(OUT)
V/C_3: R14.1 TP47.TP ; also sheet 10
V/C_4: R33.1 TP49.TP ; also sheet 10

### Notes on the sheet
- V/C _Circuit | Low side Current Sensing
- V = V_in * (4.99/(45.3+4.99))
  V = Vin * 0.99224
  DAC output 0-2V ---> 0 to 0.2V at R31
- V_sense_max = 0.2V * ( 1 + 95.3/4.99) = 4.0196V.  
  Therefore REF_ADC should be 4V
- OPA33AIDCKR
  PACKGE : SC70(DCK)
- OPA33AIDCKR
  PACKGE : SC70(DCK)
- 0- 0.2V @R31  ---0uA - 1000uA
- V/C _Circuit | Low side Current Sensing
- V = V_in * (4.99/(45.3+4.99))
  V = Vin * 0.99224
  DAC output 0-2V ---> 0 to 0.2V at R31
- V_sense_max = 0.2V * ( 1 + 95.3/4.99) = 4.0196V.  
  Therefore REF_ADC should be 4V
- OPA33AIDCKR
  PACKGE : SC70(DCK)
- OPA33AIDCKR
  PACKGE : SC70(DCK)
- 0- 0.2V @R31  ---0uA - 1000uA
- >Eddy Zhang
- Bias Current (3/3)

## Sheet 13 of 21
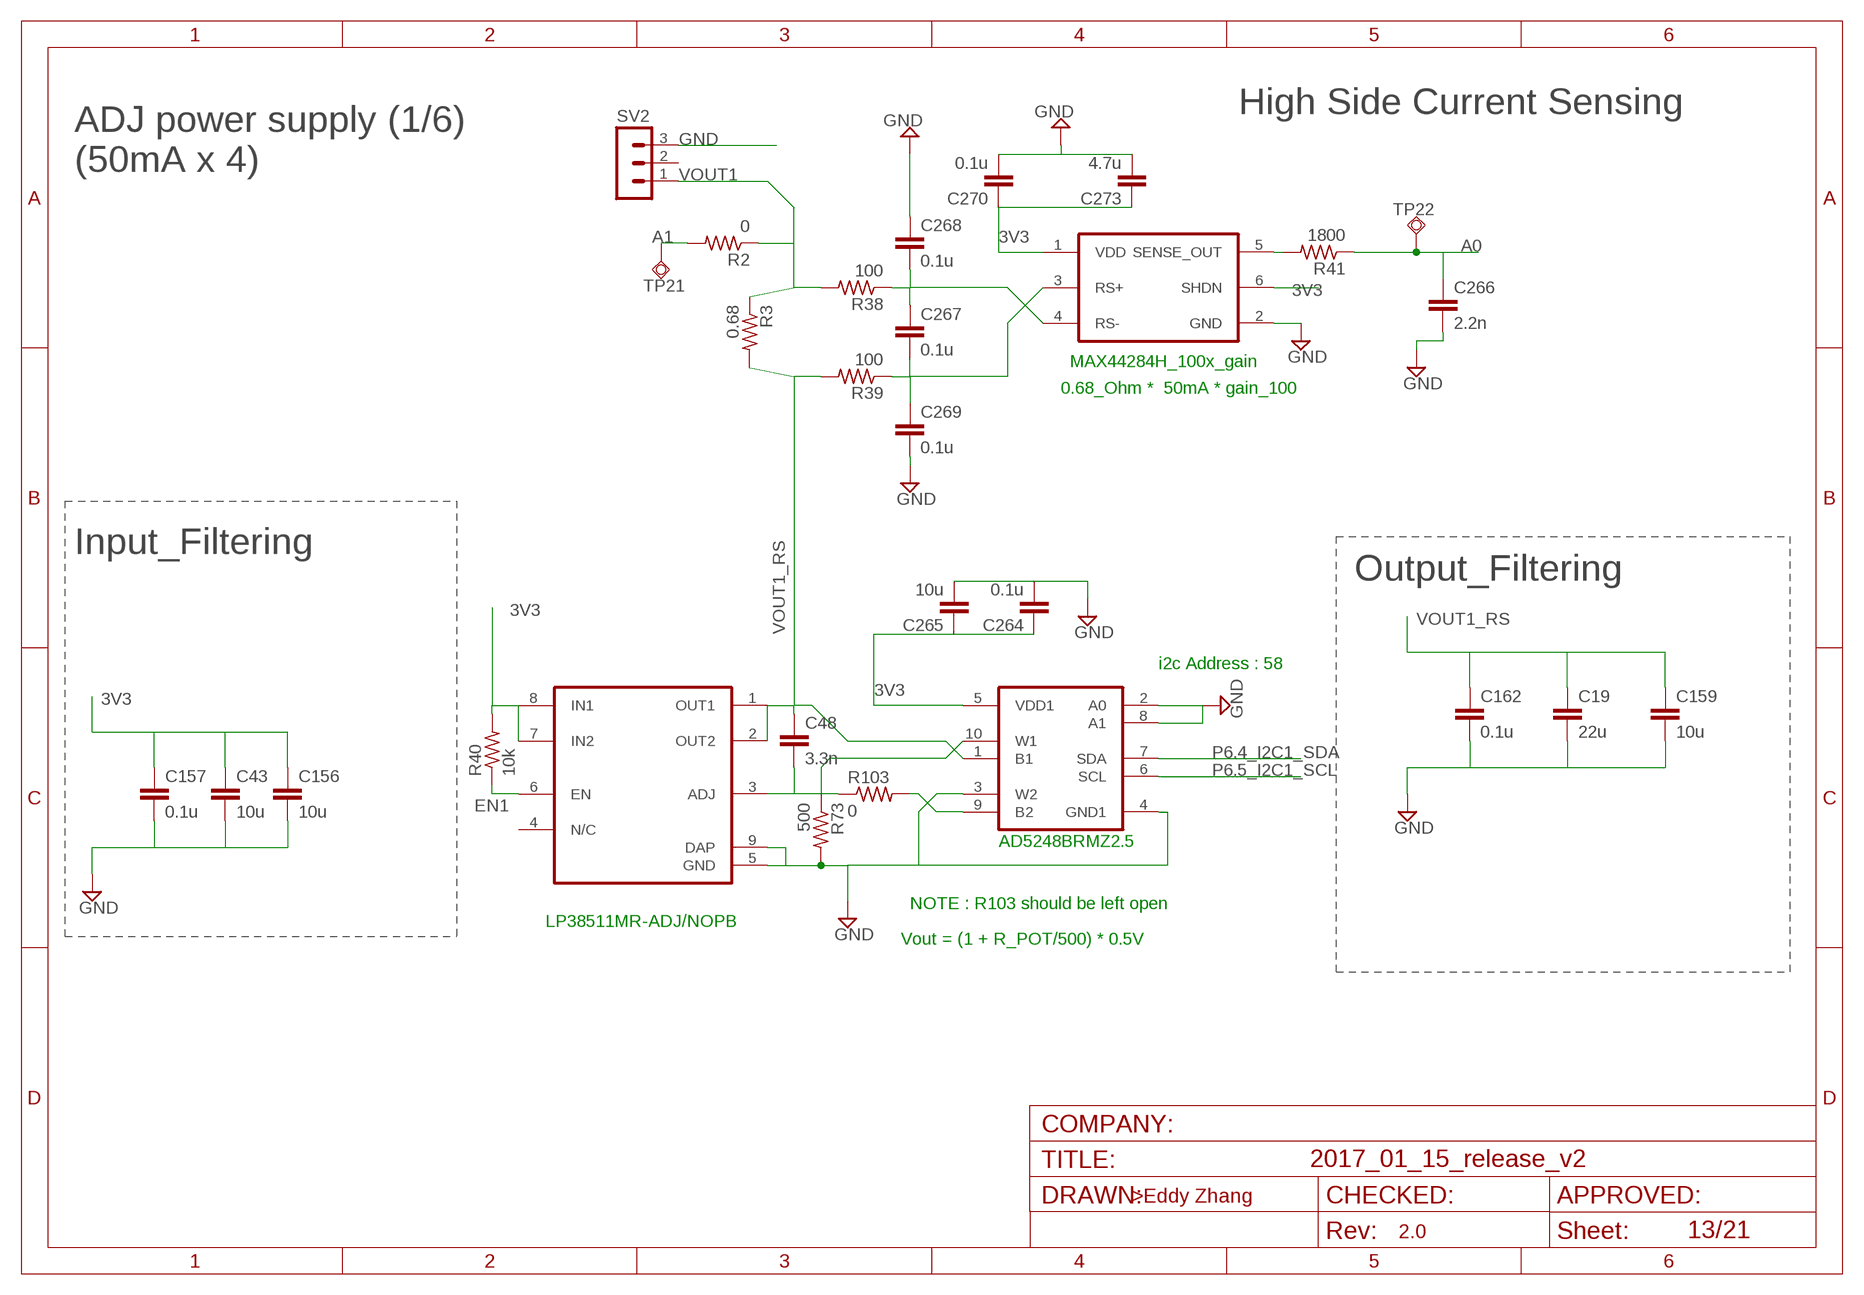
[diagram p12: schematic, sheet 13]

### Parts
C19  22u  C-EUC0805  [C0805]
C43  10u  C-EUC0805  [C0805]
C48  3.3n  C-EUC0603  [C0603]
C156  10u  C-EUC0805  [C0805]
C157  0.1u  C-EUC0603  [C0603]
C159  10u  C-EUC0805  [C0805]
C162  0.1u  C-EUC0603  [C0603]
C264  0.1u  C-EUC0603  [C0603]
C265  10u  C-EUC0805  [C0805]
C266  2.2n  C-EUC0603  [C0603]
C267  0.1u  C-EUC0603  [C0603]
C268  0.1u  C-EUC0603  [C0603]
C269  0.1u  C-EUC0603  [C0603]
C270  0.1u  C-EUC0603  [C0603]
C273  4.7u  C-EUC0805  [C0805]
R2  0  R-US_R0603  [R0603]
R3  0.68  R-US_R1206  [R1206]
R38  100  R-US_R0603  [R0603]
R39  100  R-US_R0603  [R0603]
R40  10k  R-US_R0603  [R0603]
R41  1800  R-US_R0603  [R0603]
R73  500  R-US_R0603  [R0603]
R103  0  R-US_R0603  [R0603]
SV2  MA03-1  [MA03-1]
TP21  TPSQTP20R  [TP20R]
TP22  TPSQTP20R  [TP20R]
U$4  AD5248  [MSOP10]
U$6  LP38511_SOIC  [SOIC_8N_PAD]
U$21  MAX44284  [SOT23-6]

### Nets
3V3 [Power]: C43.1 C156.1 C157.1 C264.1 C265.1 C270.1 C273.1 R40.2 U$4.5(VDD1) U$6.7(IN2) U$6.8(IN1) U$21.1(VDD) U$21.6(SHDN) ; also sheet 2,4,5,6,7,8,9,10,11,12,14,15,16,17,18,19,20
A0: C266.1 R41.1 TP22.TP ; also sheet 5
A1: R2.2 TP21.TP ; also sheet 5
EN1: R40.1 U$6.6(EN) ; also sheet 5
GND [GND]: C19.2 C43.2 C156.2 C157.2 C159.2 C162.2 C264.2 C265.2 C266.2 C268.1 C269.2 C270.2 C273.2 R73.2 SV2.3 U$4.2(A0) U$4.3(W2) U$4.4(GND1) U$4.8(A1) U$6.5(GND) U$6.9(DAP) U$21.2(GND) ; also sheet 2,3,4,5,6,7,8,9,10,11,12,14,15,16,17,18,19,20,21
N123~1: R41.2 U$21.5(SENSE_OUT)
N$14: C48.2 R73.1 R103.1 U$4.10(W1) U$6.3(ADJ)
N$69: C267.2 C269.1 R39.1 U$21.3(RS+)
N$83: R103.2 U$4.9(B2)
N$144: C267.1 C268.2 R38.1 U$21.4(RS-)
P6.4_I2C1_SDA: U$4.7(SDA) ; also sheet 4,5,14,15,16
P6.5_I2C1_SCL: U$4.6(SCL) ; also sheet 4,5,14,15,16
VOUT1 [Power]: R2.1 R3.1 R38.2 SV2.1 ; also sheet 21
VOUT1_RS: C19.1 C48.1 C159.1 C162.1 R3.2 R39.2 U$4.1(B1) U$6.1(OUT1) U$6.2(OUT2)
Unconnected: SV2.2 U$6.4(N/C)

### Notes on the sheet
- High Side Current Sensing
- ADJ power supply (1/6)
  (50mA x 4)
- MAX44284H_100x_gain
- 0.68_Ohm *  50mA * gain_100
- Input_Filtering
- Output_Filtering
- i2c Address : 58
- AD5248BRMZ2.5
- NOTE : R103 should be left open
- LP38511MR-ADJ/NOPB
- Vout = (1 + R_POT/500) * 0.5V
- >Eddy Zhang

## Sheet 14 of 21
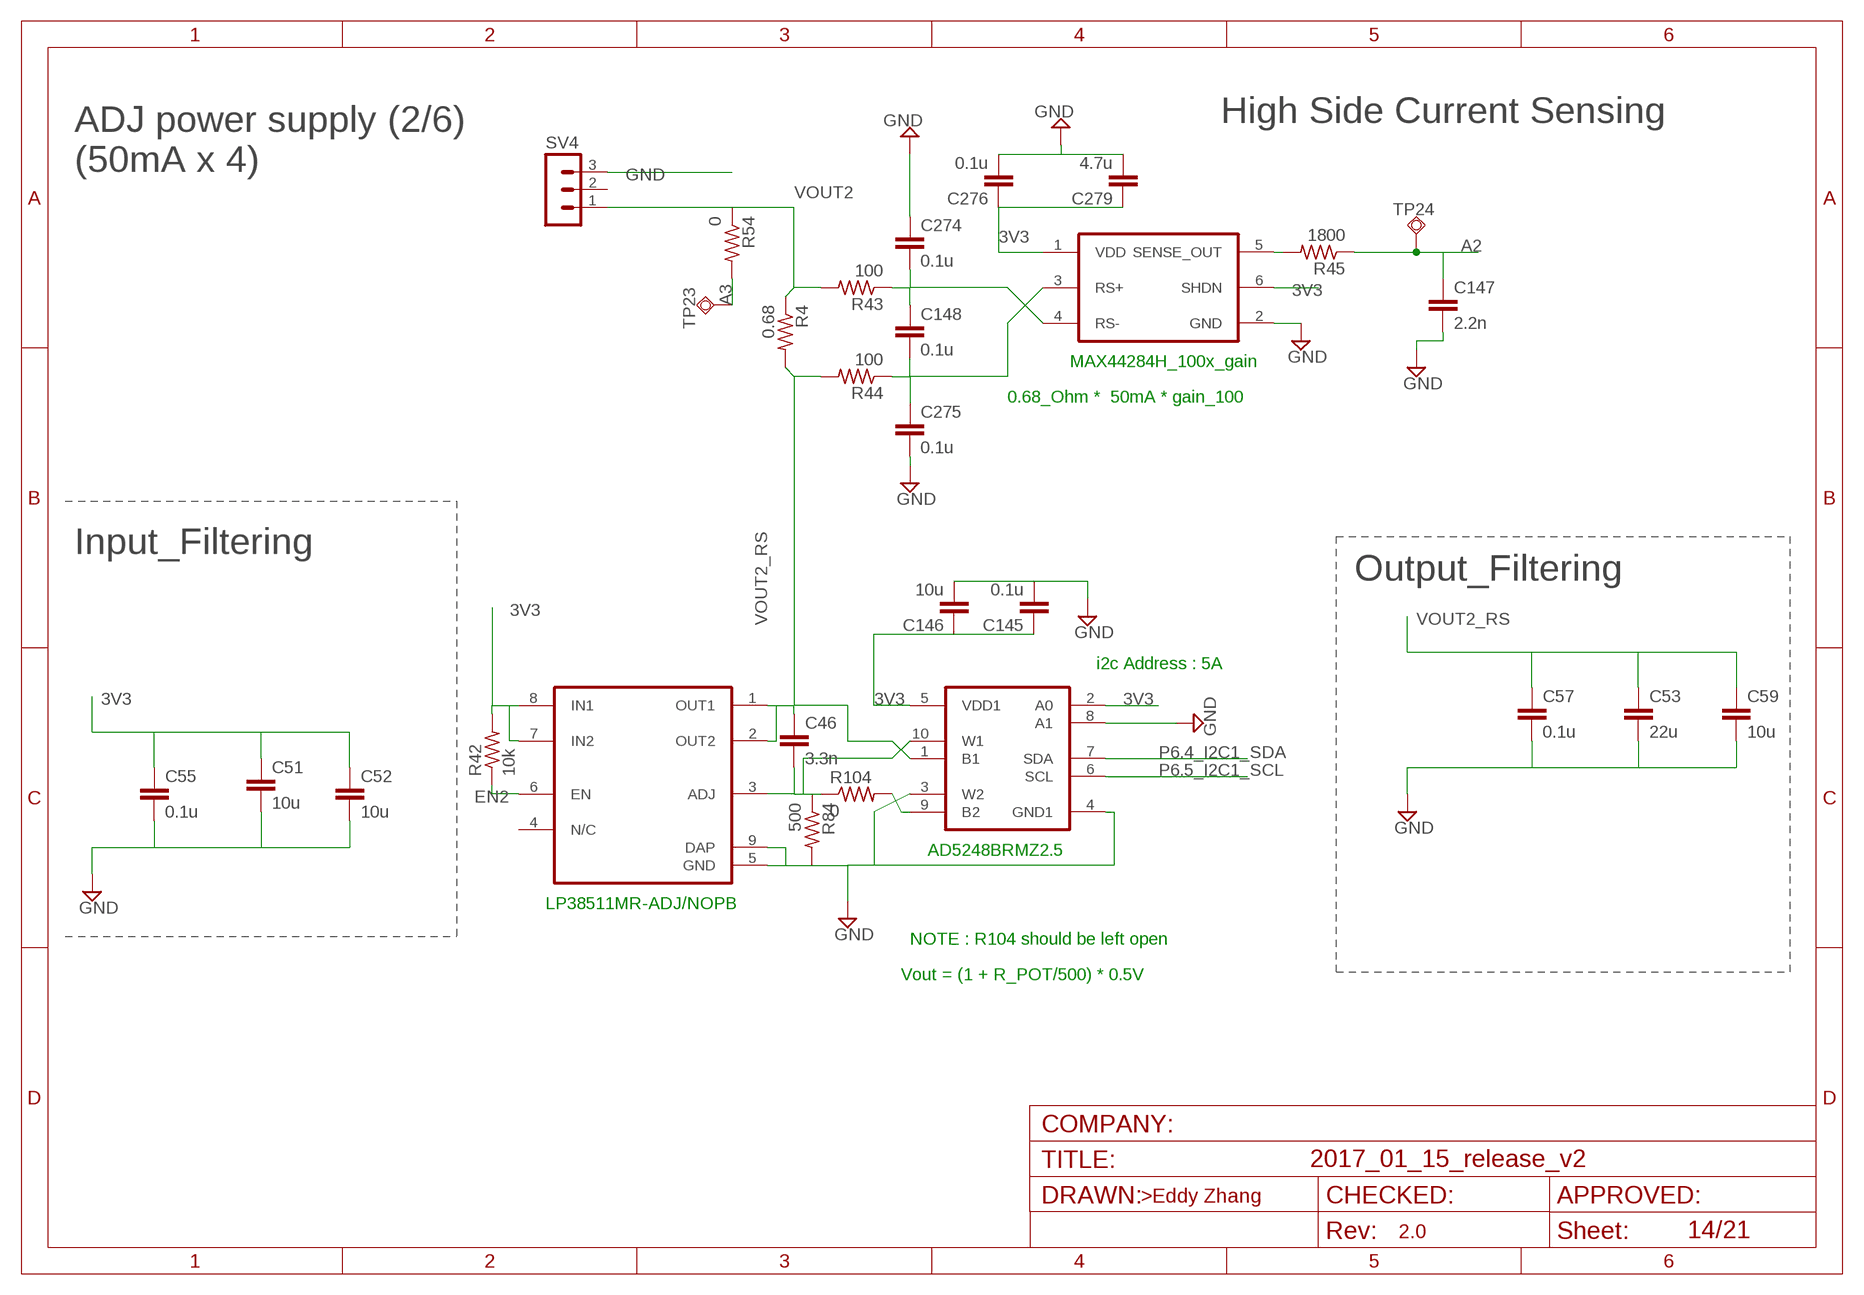
[diagram p13: schematic, sheet 14]

### Parts
ADJ2  LP38511_SOIC  [SOIC_8N_PAD]
C46  3.3n  C-EUC0603K  [C0603K]
C51  10u  C-EUC0805  [C0805]
C52  10u  C-EUC0805  [C0805]
C53  22u  C-EUC0805  [C0805]
C55  0.1u  C-EUC0603  [C0603]
C57  0.1u  C-EUC0603  [C0603]
C59  10u  C-EUC0805  [C0805]
C145  0.1u  C-EUC0603  [C0603]
C146  10u  C-EUC0805  [C0805]
C147  2.2n  C-EUC0603  [C0603]
C148  0.1u  C-EUC0603  [C0603]
C274  0.1u  C-EUC0603  [C0603]
C275  0.1u  C-EUC0603  [C0603]
C276  0.1u  C-EUC0603  [C0603]
C279  4.7u  C-EUC0805  [C0805]
POT2  AD5248  [MSOP10]
R4  0.68  R-US_R1206  [R1206]
R42  10k  R-US_R0603  [R0603]
R43  100  R-US_R0603  [R0603]
R44  100  R-US_R0603  [R0603]
R45  1800  R-US_R0603  [R0603]
R54  0  R-US_R0603  [R0603]
R84  500  R-US_R0603  [R0603]
R104  0  R-US_R0603  [R0603]
SV4  MA03-1  [MA03-1]
TP23  TPSQTP20R  [TP20R]
TP24  TPSQTP20R  [TP20R]
VSEN2  MAX44284  [SOT23-6]

### Nets
3V3 [Power]: ADJ2.7(IN2) ADJ2.8(IN1) C51.1 C52.1 C55.1 C145.1 C146.1 C276.1 C279.1 POT2.2(A0) POT2.5(VDD1) R42.2 VSEN2.1(VDD) VSEN2.6(SHDN) ; also sheet 2,4,5,6,7,8,9,10,11,12,13,15,16,17,18,19,20
A2: C147.1 R45.1 TP24.TP ; also sheet 5
A3: R54.2 TP23.TP ; also sheet 5
EN2: ADJ2.6(EN) R42.1 ; also sheet 5
GND [GND]: ADJ2.5(GND) ADJ2.9(DAP) C51.2 C52.2 C53.2 C55.2 C57.2 C59.2 C145.2 C146.2 C147.2 C274.1 C275.2 C276.2 C279.2 POT2.3(W2) POT2.4(GND1) POT2.8(A1) R84.2 SV4.3 VSEN2.2(GND) ; also sheet 2,3,4,5,6,7,8,9,10,11,12,13,15,16,17,18,19,20,21
N123~2: R45.2 VSEN2.5(SENSE_OUT)
N$71: C148.2 C275.1 R44.1 VSEN2.3(RS+)
N$72: C148.1 C274.2 R43.1 VSEN2.4(RS-)
N$77: POT2.9(B2) R104.2
N$132: ADJ2.3(ADJ) C46.2 POT2.10(W1) R84.1 R104.1
P6.4_I2C1_SDA: POT2.7(SDA) ; also sheet 4,5,13,15,16
P6.5_I2C1_SCL: POT2.6(SCL) ; also sheet 4,5,13,15,16
VOUT2: R4.1 R43.2 R54.1 SV4.1 ; also sheet 21
VOUT2_RS: ADJ2.1(OUT1) ADJ2.2(OUT2) C46.1 C53.1 C57.1 C59.1 POT2.1(B1) R4.2 R44.2
Unconnected: ADJ2.4(N/C) SV4.2

### Notes on the sheet
- High Side Current Sensing
- ADJ power supply (2/6)
  (50mA x 4)
- MAX44284H_100x_gain
- 0.68_Ohm *  50mA * gain_100
- Input_Filtering
- Output_Filtering
- i2c Address : 5A
- AD5248BRMZ2.5
- LP38511MR-ADJ/NOPB
- NOTE : R104 should be left open
- Vout = (1 + R_POT/500) * 0.5V
- >Eddy Zhang

## Sheet 15 of 21
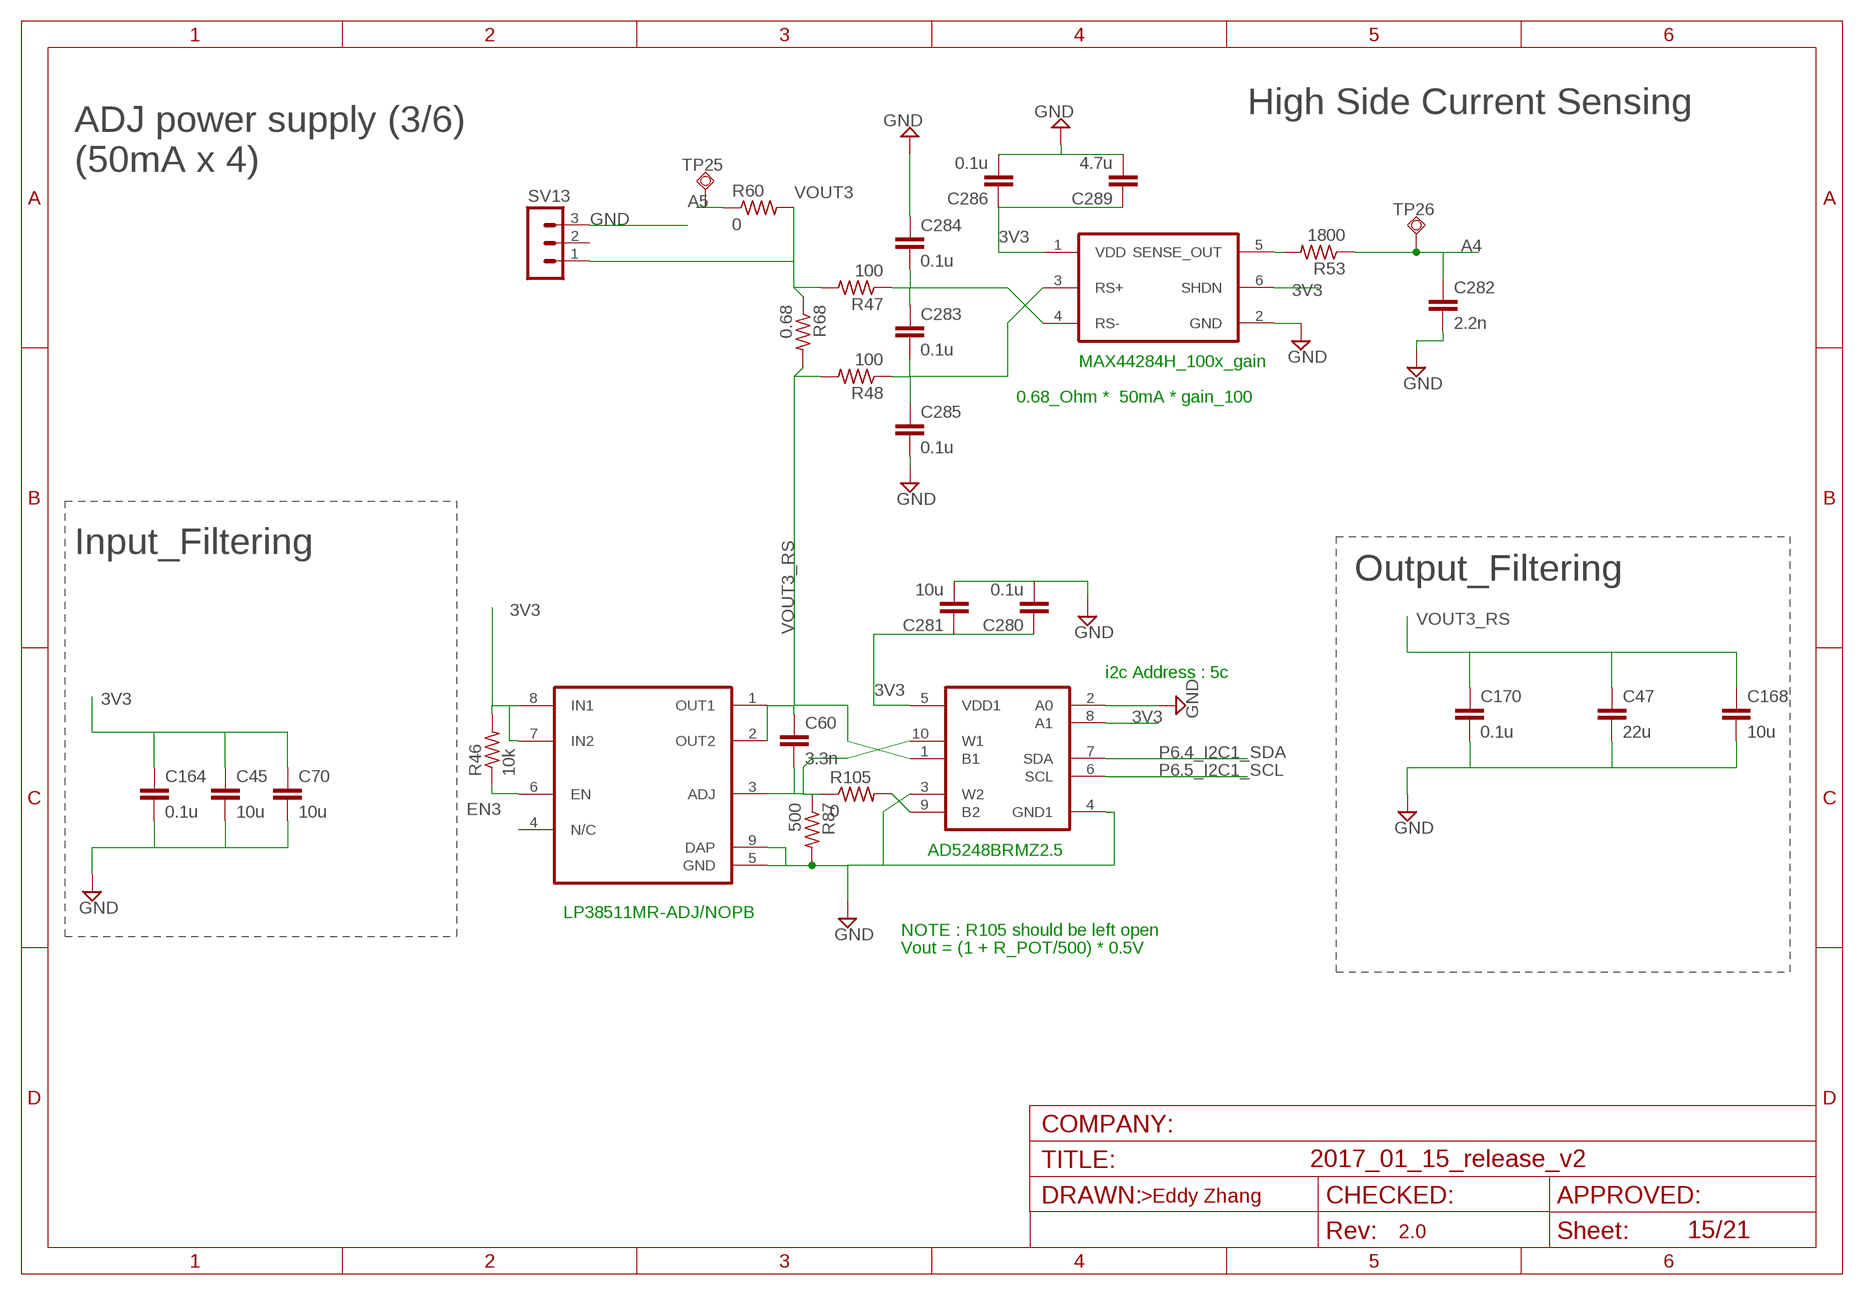
[diagram p14: schematic, sheet 15]

### Parts
ADJ3  LP38511_SOIC  [SOIC_8N_PAD]
C45  10u  C-EUC0805  [C0805]
C47  22u  C-EUC0805  [C0805]
C60  3.3n  C-EUC0603K  [C0603K]
C70  10u  C-EUC0805  [C0805]
C164  0.1u  C-EUC0603  [C0603]
C168  10u  C-EUC0805  [C0805]
C170  0.1u  C-EUC0603  [C0603]
C280  0.1u  C-EUC0603K  [C0603K]
C281  10u  C-EUC0805K  [C0805K]
C282  2.2n  C-EUC0603  [C0603]
C283  0.1u  C-EUC0603  [C0603]
C284  0.1u  C-EUC0603  [C0603]
C285  0.1u  C-EUC0603  [C0603]
C286  0.1u  C-EUC0603  [C0603]
C289  4.7u  C-EUC0805  [C0805]
POT3  AD5248  [MSOP10]
R46  10k  R-US_R0603  [R0603]
R47  100  R-US_R0603  [R0603]
R48  100  R-US_R0603  [R0603]
R53  1800  R-US_R0603  [R0603]
R60  0  R-US_R0603  [R0603]
R68  0.68  R-US_R1206  [R1206]
R87  500  R-US_R0603  [R0603]
R105  0  R-US_R0603  [R0603]
SV13  MA03-1  [MA03-1]
TP25  TPSQTP20R  [TP20R]
TP26  TPSQTP20R  [TP20R]
VSEN3  MAX44284  [SOT23-6]

### Nets
3V3 [Power]: ADJ3.7(IN2) ADJ3.8(IN1) C45.1 C70.1 C164.1 C280.1 C281.1 C286.1 C289.1 POT3.5(VDD1) POT3.8(A1) R46.2 VSEN3.1(VDD) VSEN3.6(SHDN) ; also sheet 2,4,5,6,7,8,9,10,11,12,13,14,16,17,18,19,20
A4: C282.1 R53.1 TP26.TP ; also sheet 5
A5: R60.1 TP25.TP ; also sheet 5
EN3: ADJ3.6(EN) R46.1 ; also sheet 5
GND [GND]: ADJ3.5(GND) ADJ3.9(DAP) C45.2 C47.2 C70.2 C164.2 C168.2 C170.2 C280.2 C281.2 C282.2 C284.1 C285.2 C286.2 C289.2 POT3.2(A0) POT3.3(W2) POT3.4(GND1) R87.2 SV13.3 VSEN3.2(GND) ; also sheet 2,3,4,5,6,7,8,9,10,11,12,13,14,16,17,18,19,20,21
N123~3: R53.2 VSEN3.5(SENSE_OUT)
N$6: C283.1 C284.2 R47.1 VSEN3.4(RS-)
N$70: POT3.9(B2) R105.2
N$73: C283.2 C285.1 R48.1 VSEN3.3(RS+)
N$141: ADJ3.3(ADJ) C60.2 POT3.10(W1) R87.1 R105.1
P6.4_I2C1_SDA: POT3.7(SDA) ; also sheet 4,5,13,14,16
P6.5_I2C1_SCL: POT3.6(SCL) ; also sheet 4,5,13,14,16
VOUT3: R47.2 R60.2 R68.1 SV13.1 ; also sheet 21
VOUT3_RS: ADJ3.1(OUT1) ADJ3.2(OUT2) C47.1 C60.1 C168.1 C170.1 POT3.1(B1) R48.2 R68.2
Unconnected: ADJ3.4(N/C) SV13.2

### Notes on the sheet
- High Side Current Sensing
- ADJ power supply (3/6)
  (50mA x 4)
- MAX44284H_100x_gain
- 0.68_Ohm *  50mA * gain_100
- Input_Filtering
- Output_Filtering
- i2c Address : 5c
- AD5248BRMZ2.5
- LP38511MR-ADJ/NOPB
- NOTE : R105 should be left open
- Vout = (1 + R_POT/500) * 0.5V
- >Eddy Zhang

## Sheet 16 of 21
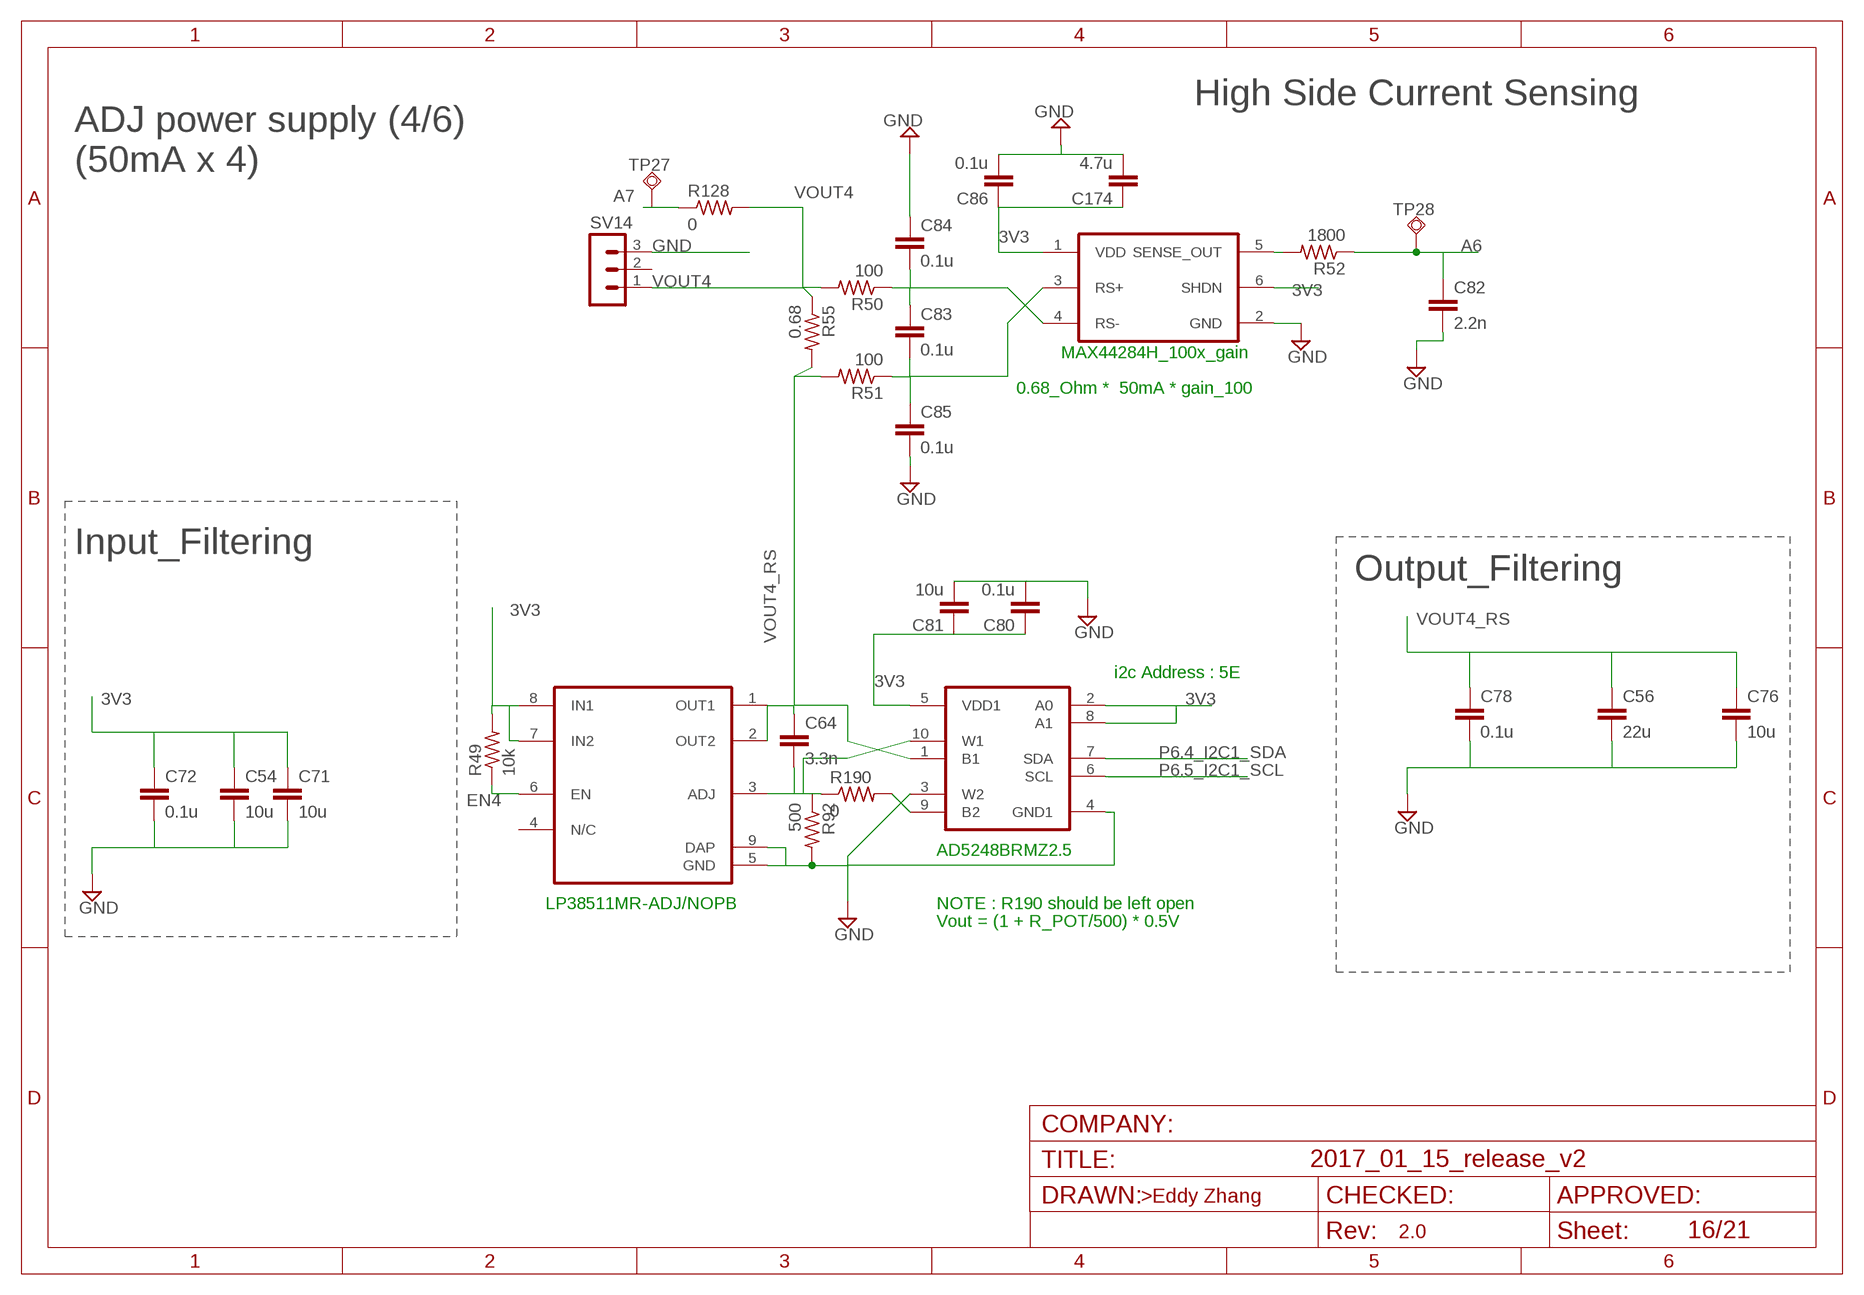
[diagram p15: schematic, sheet 16]

### Parts
ADJ4  LP38511_SOIC  [SOIC_8N_PAD]
C54  10u  C-EUC0805  [C0805]
C56  22u  C-EUC0805  [C0805]
C64  3.3n  C-EUC0603K  [C0603K]
C71  10u  C-EUC0805  [C0805]
C72  0.1u  C-EUC0603  [C0603]
C76  10u  C-EUC0805  [C0805]
C78  0.1u  C-EUC0603  [C0603]
C80  0.1u  C-EUC0603  [C0603]
C81  10u  C-EUC0805  [C0805]
C82  2.2n  C-EUC0603  [C0603]
C83  0.1u  C-EUC0603  [C0603]
C84  0.1u  C-EUC0603  [C0603]
C85  0.1u  C-EUC0603  [C0603]
C86  0.1u  C-EUC0603K  [C0603K]
C174  4.7u  C-EUC0805K  [C0805K]
POT4  AD5248  [MSOP10]
R49  10k  R-US_R0603  [R0603]
R50  100  R-US_R0603  [R0603]
R51  100  R-US_R0603  [R0603]
R52  1800  R-US_R0603  [R0603]
R55  0.68  R-US_R1206  [R1206]
R92  500  R-US_R0603  [R0603]
R128  0  R-US_R0603  [R0603]
R190  0  R-US_R0603  [R0603]
SV14  MA03-1  [MA03-1]
TP27  TPSQTP20R  [TP20R]
TP28  TPSQTP20R  [TP20R]
VSEN4  MAX44284  [SOT23-6]

### Nets
3V3 [Power]: ADJ4.7(IN2) ADJ4.8(IN1) C54.1 C71.1 C72.1 C80.1 C81.1 C86.1 C174.1 POT4.2(A0) POT4.5(VDD1) POT4.8(A1) R49.2 VSEN4.1(VDD) VSEN4.6(SHDN) ; also sheet 2,4,5,6,7,8,9,10,11,12,13,14,15,17,18,19,20
A6: C82.1 R52.1 TP28.TP ; also sheet 5
A7: R128.1 TP27.TP ; also sheet 5
EN4: ADJ4.6(EN) R49.1 ; also sheet 5
GND [GND]: ADJ4.5(GND) ADJ4.9(DAP) C54.2 C56.2 C71.2 C72.2 C76.2 C78.2 C80.2 C81.2 C82.2 C84.1 C85.2 C86.2 C174.2 POT4.3(W2) POT4.4(GND1) R92.2 SV14.3 VSEN4.2(GND) ; also sheet 2,3,4,5,6,7,8,9,10,11,12,13,14,15,17,18,19,20,21
N123~4: R52.2 VSEN4.5(SENSE_OUT)
N$66: POT4.9(B2) R190.2
N$68: C83.2 C85.1 R51.1 VSEN4.3(RS+)
N$76: C83.1 C84.2 R50.1 VSEN4.4(RS-)
N$208: ADJ4.3(ADJ) C64.2 POT4.10(W1) R92.1 R190.1
P6.4_I2C1_SDA: POT4.7(SDA) ; also sheet 4,5,13,14,15
P6.5_I2C1_SCL: POT4.6(SCL) ; also sheet 4,5,13,14,15
VOUT4: R50.2 R55.1 R128.2 SV14.1 ; also sheet 21
VOUT4_RS: ADJ4.1(OUT1) ADJ4.2(OUT2) C56.1 C64.1 C76.1 C78.1 POT4.1(B1) R51.2 R55.2
Unconnected: ADJ4.4(N/C) SV14.2

### Notes on the sheet
- High Side Current Sensing
- ADJ power supply (4/6)
  (50mA x 4)
- MAX44284H_100x_gain
- 0.68_Ohm *  50mA * gain_100
- Input_Filtering
- Output_Filtering
- i2c Address : 5E
- AD5248BRMZ2.5
- LP38511MR-ADJ/NOPB | NOTE : R190 should be left open
- Vout = (1 + R_POT/500) * 0.5V
- >Eddy Zhang

## Sheet 17 of 21
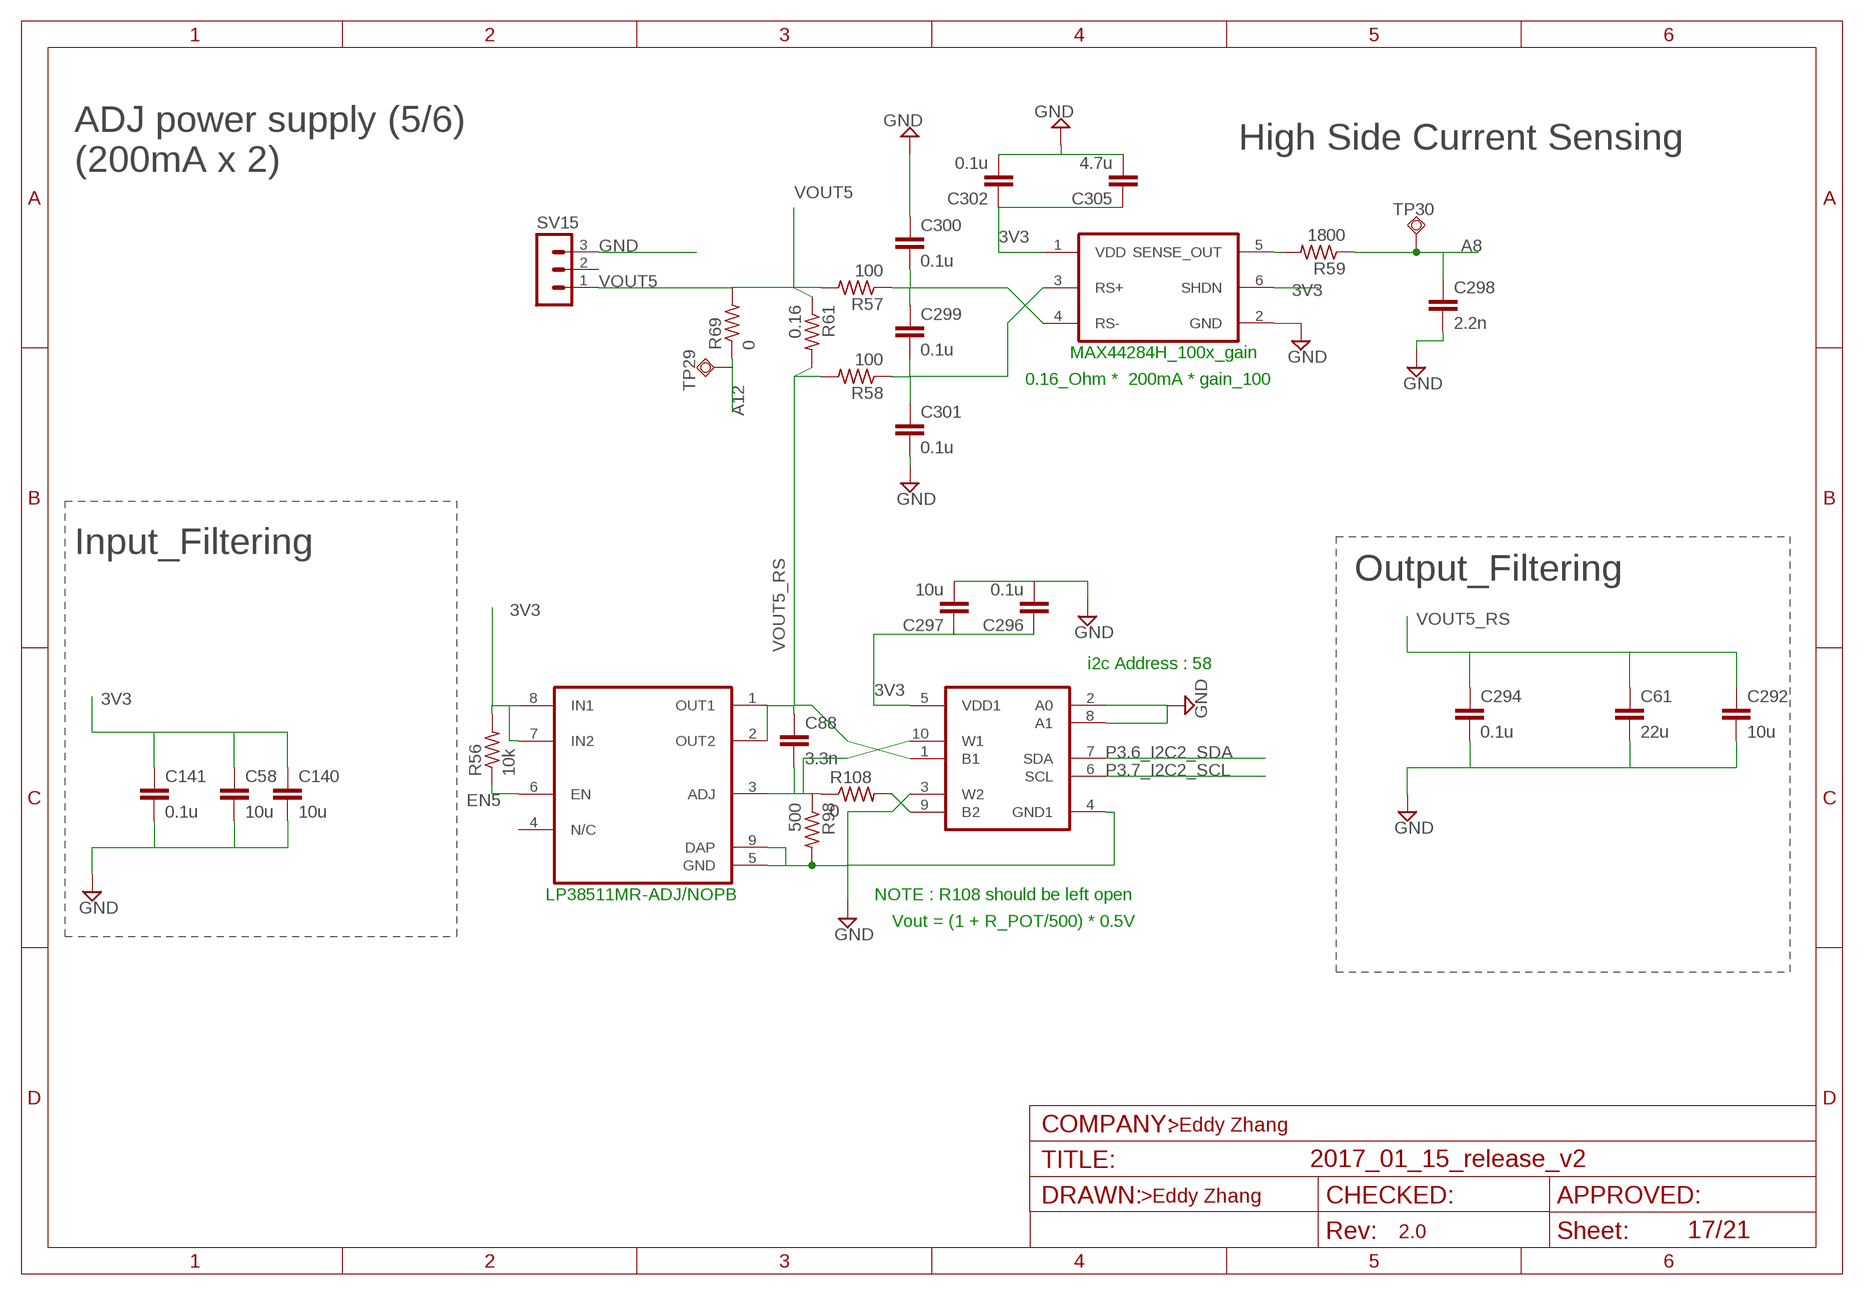
[diagram p16: schematic, sheet 17]

### Parts
ADJ5  LP38511_SOIC  [SOIC_8N_PAD]
C58  10u  C-EUC0805  [C0805]
C61  22u  C-EUC0805  [C0805]
C88  3.3n  C-EUC0603K  [C0603K]
C140  10u  C-EUC0805  [C0805]
C141  0.1u  C-EUC0603  [C0603]
C292  10u  C-EUC0805  [C0805]
C294  0.1u  C-EUC0603  [C0603]
C296  0.1u  C-EUC0603  [C0603]
C297  10u  C-EUC0805  [C0805]
C298  2.2n  C-EUC0603  [C0603]
C299  0.1u  C-EUC0603  [C0603]
C300  0.1u  C-EUC0603  [C0603]
C301  0.1u  C-EUC0603  [C0603]
C302  0.1u  C-EUC0603  [C0603]
C305  4.7u  C-EUC0805  [C0805]
POT5  AD5248  [MSOP10]
R56  10k  R-US_R0603  [R0603]
R57  100  R-US_R0603  [R0603]
R58  100  R-US_R0603  [R0603]
R59  1800  R-US_R0603  [R0603]
R61  0.16  R-US_R1206  [R1206]
R69  0  R-US_R0603  [R0603]
R98  500  R-US_R0603  [R0603]
R108  0  R-US_R0603  [R0603]
SV15  MA03-1  [MA03-1]
TP29  TPSQTP20R  [TP20R]
TP30  TPSQTP20R  [TP20R]
VSEN5  MAX44284  [SOT23-6]

### Nets
3V3 [Power]: ADJ5.7(IN2) ADJ5.8(IN1) C58.1 C140.1 C141.1 C296.1 C297.1 C302.1 C305.1 POT5.5(VDD1) R56.2 VSEN5.1(VDD) VSEN5.6(SHDN) ; also sheet 2,4,5,6,7,8,9,10,11,12,13,14,15,16,18,19,20
A8: C298.1 R59.1 TP30.TP ; also sheet 5
A12: R69.1 TP29.TP ; also sheet 5
EN5: ADJ5.6(EN) R56.1 ; also sheet 5
GND [GND]: ADJ5.5(GND) ADJ5.9(DAP) C58.2 C61.2 C140.2 C141.2 C292.2 C294.2 C296.2 C297.2 C298.2 C300.1 C301.2 C302.2 C305.2 POT5.2(A0) POT5.3(W2) POT5.4(GND1) POT5.8(A1) R98.2 SV15.3 VSEN5.2(GND) ; also sheet 2,3,4,5,6,7,8,9,10,11,12,13,14,15,16,18,19,20,21
N123~5: R59.2 VSEN5.5(SENSE_OUT)
N$34: C299.1 C300.2 R57.1 VSEN5.4(RS-)
N$79: POT5.9(B2) R108.2
N$80: C299.2 C301.1 R58.1 VSEN5.3(RS+)
N$209: ADJ5.3(ADJ) C88.2 POT5.10(W1) R98.1 R108.1
P3.6_I2C2_SDA: POT5.7(SDA) ; also sheet 4,5,18,19,20
P3.7_I2C2_SCL: POT5.6(SCL) ; also sheet 4,5,18,19,20
VOUT5: R57.2 R61.1 R69.2 SV15.1 ; also sheet 21
VOUT5_RS: ADJ5.1(OUT1) ADJ5.2(OUT2) C61.1 C88.1 C292.1 C294.1 POT5.1(B1) R58.2 R61.2
Unconnected: ADJ5.4(N/C) SV15.2

### Notes on the sheet
- ADJ power supply (5/6)
  (200mA x 2)
- High Side Current Sensing
- MAX44284H_100x_gain
- 0.16_Ohm *  200mA * gain_100
- Input_Filtering
- Output_Filtering
- i2c Address : 58
- LP38511MR-ADJ/NOPB | NOTE : R108 should be left open
- Vout = (1 + R_POT/500) * 0.5V
- >Eddy Zhang
- >Eddy Zhang

## Sheet 18 of 21
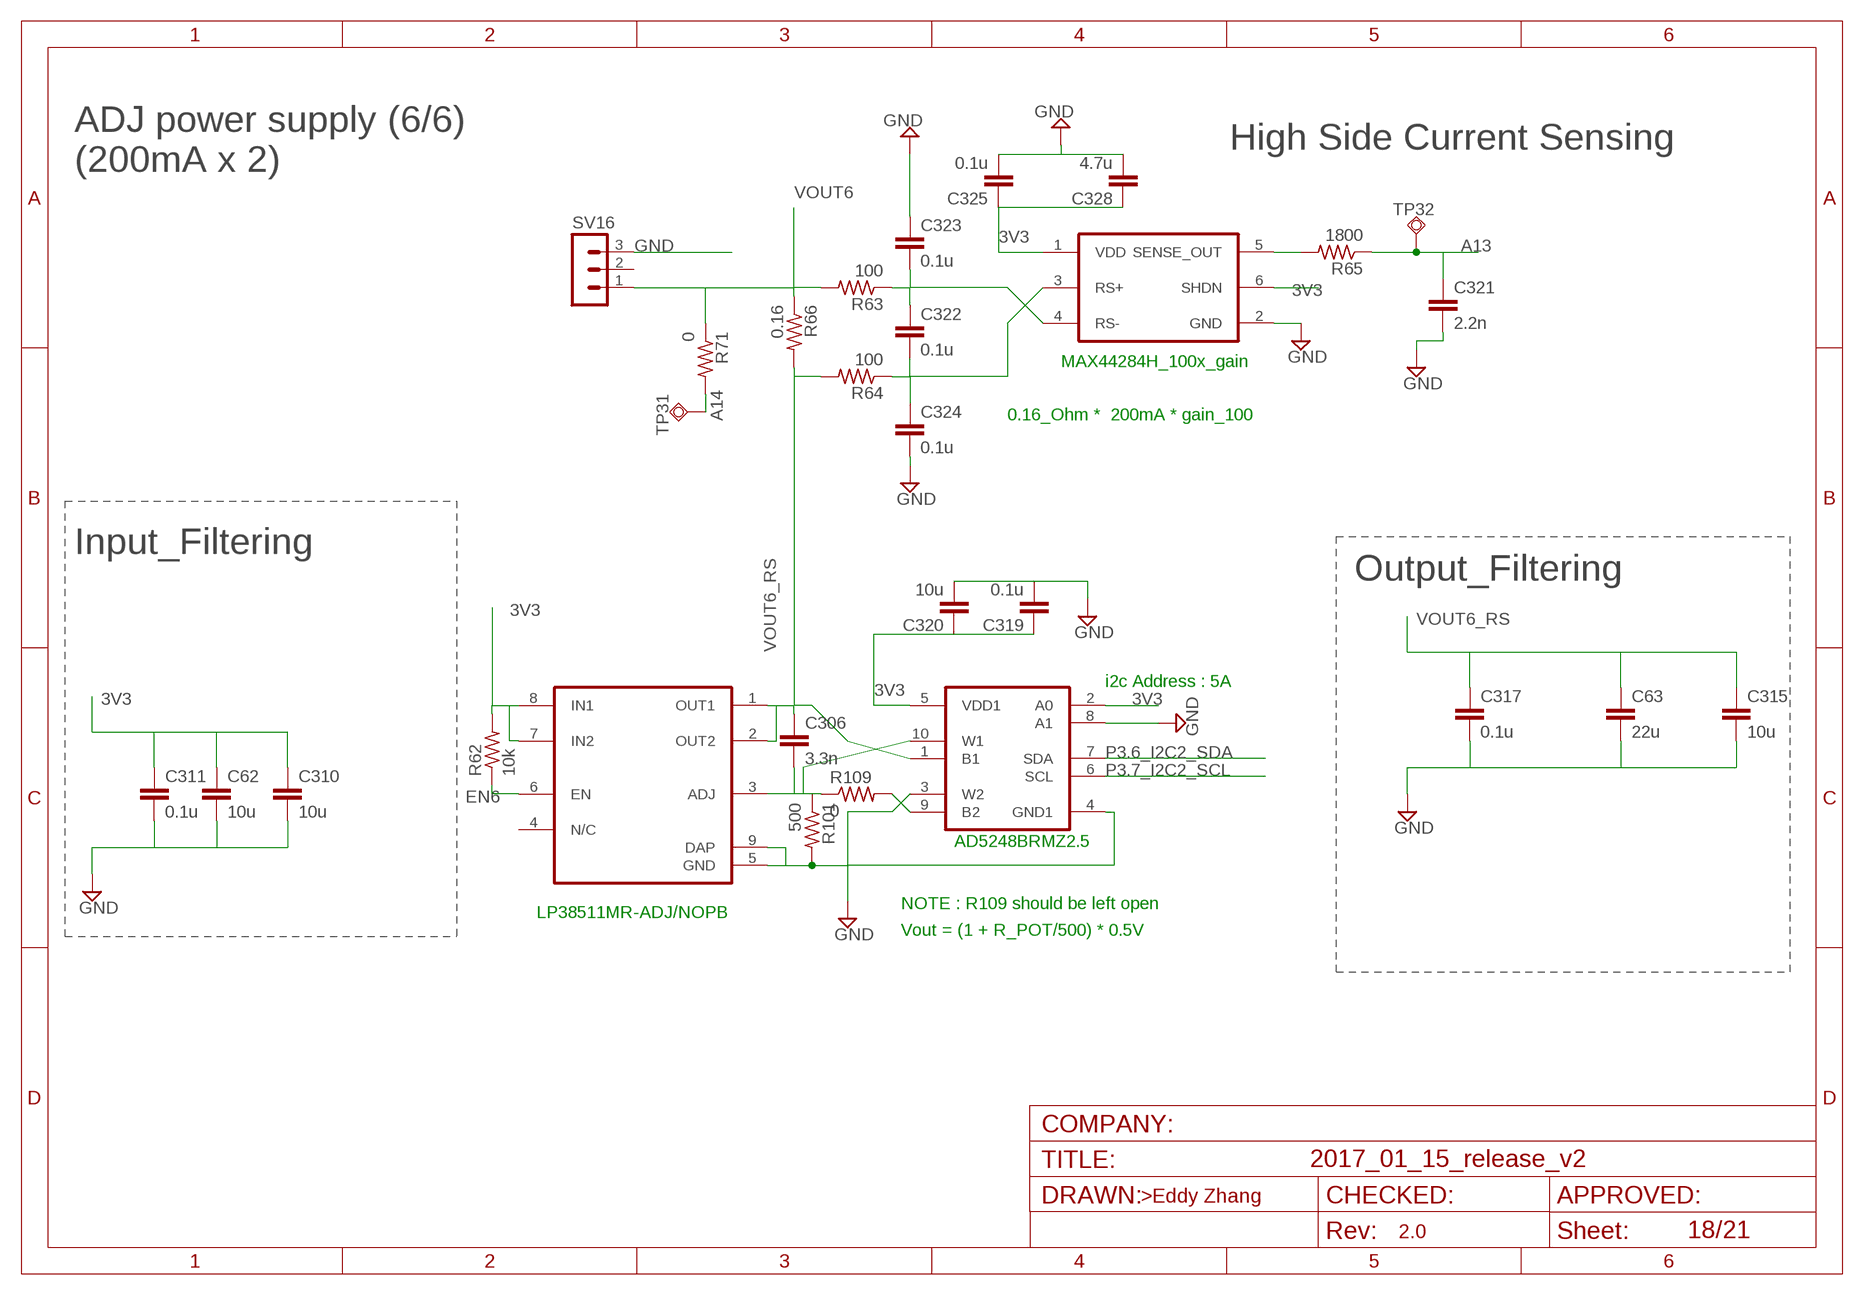
[diagram p17: schematic, sheet 18]

### Parts
ADJ6  LP38511_SOIC  [SOIC_8N_PAD]
C62  10u  C-EUC0805  [C0805]
C63  22u  C-EUC0805  [C0805]
C306  3.3n  C-EUC0603K  [C0603K]
C310  10u  C-EUC0805  [C0805]
C311  0.1u  C-EUC0603  [C0603]
C315  10u  C-EUC0805  [C0805]
C317  0.1u  C-EUC0603  [C0603]
C319  0.1u  C-EUC0603  [C0603]
C320  10u  C-EUC0805  [C0805]
C321  2.2n  C-EUC0603  [C0603]
C322  0.1u  C-EUC0603  [C0603]
C323  0.1u  C-EUC0603  [C0603]
C324  0.1u  C-EUC0603K  [C0603K]
C325  0.1u  C-EUC0603  [C0603]
C328  4.7u  C-EUC0805  [C0805]
POT6  AD5248  [MSOP10]
R62  10k  R-US_R0603  [R0603]
R63  100  R-US_R0603  [R0603]
R64  100  R-US_R0603  [R0603]
R65  1800  R-US_R0603  [R0603]
R66  0.16  R-US_R1206  [R1206]
R71  0  R-US_R0603  [R0603]
R101  500  R-US_R0603  [R0603]
R109  0  R-US_R0603  [R0603]
SV16  MA03-1  [MA03-1]
TP31  TPSQTP20R  [TP20R]
TP32  TPSQTP20R  [TP20R]
VSEN6  MAX44284  [SOT23-6]

### Nets
3V3 [Power]: ADJ6.7(IN2) ADJ6.8(IN1) C62.1 C310.1 C311.1 C319.1 C320.1 C325.1 C328.1 POT6.2(A0) POT6.5(VDD1) R62.2 VSEN6.1(VDD) VSEN6.6(SHDN) ; also sheet 2,4,5,6,7,8,9,10,11,12,13,14,15,16,17,19,20
A13: C321.1 R65.1 TP32.TP ; also sheet 5
A14: R71.2 TP31.TP ; also sheet 5
EN6: ADJ6.6(EN) R62.1 ; also sheet 5
GND [GND]: ADJ6.5(GND) ADJ6.9(DAP) C62.2 C63.2 C310.2 C311.2 C315.2 C317.2 C319.2 C320.2 C321.2 C323.1 C324.2 C325.2 C328.2 POT6.3(W2) POT6.4(GND1) POT6.8(A1) R101.2 SV16.3 VSEN6.2(GND) ; also sheet 2,3,4,5,6,7,8,9,10,11,12,13,14,15,16,17,19,20,21
N123~6: R65.2 VSEN6.5(SENSE_OUT)
N$84: POT6.9(B2) R109.2
N$85: C322.2 C324.1 R64.1 VSEN6.3(RS+)
N$86: C322.1 C323.2 R63.1 VSEN6.4(RS-)
N$211: ADJ6.3(ADJ) C306.2 POT6.10(W1) R101.1 R109.1
P3.6_I2C2_SDA: POT6.7(SDA) ; also sheet 4,5,17,19,20
P3.7_I2C2_SCL: POT6.6(SCL) ; also sheet 4,5,17,19,20
VOUT6: R63.2 R66.1 R71.1 SV16.1 ; also sheet 21
VOUT6_RS: ADJ6.1(OUT1) ADJ6.2(OUT2) C63.1 C306.1 C315.1 C317.1 POT6.1(B1) R64.2 R66.2
Unconnected: ADJ6.4(N/C) SV16.2

### Notes on the sheet
- ADJ power supply (6/6)
  (200mA x 2)
- High Side Current Sensing
- MAX44284H_100x_gain
- 0.16_Ohm *  200mA * gain_100
- Input_Filtering
- Output_Filtering
- i2c Address : 5A
- AD5248BRMZ2.5
- NOTE : R109 should be left open
- LP38511MR-ADJ/NOPB
- Vout = (1 + R_POT/500) * 0.5V
- >Eddy Zhang

## Sheet 19 of 21
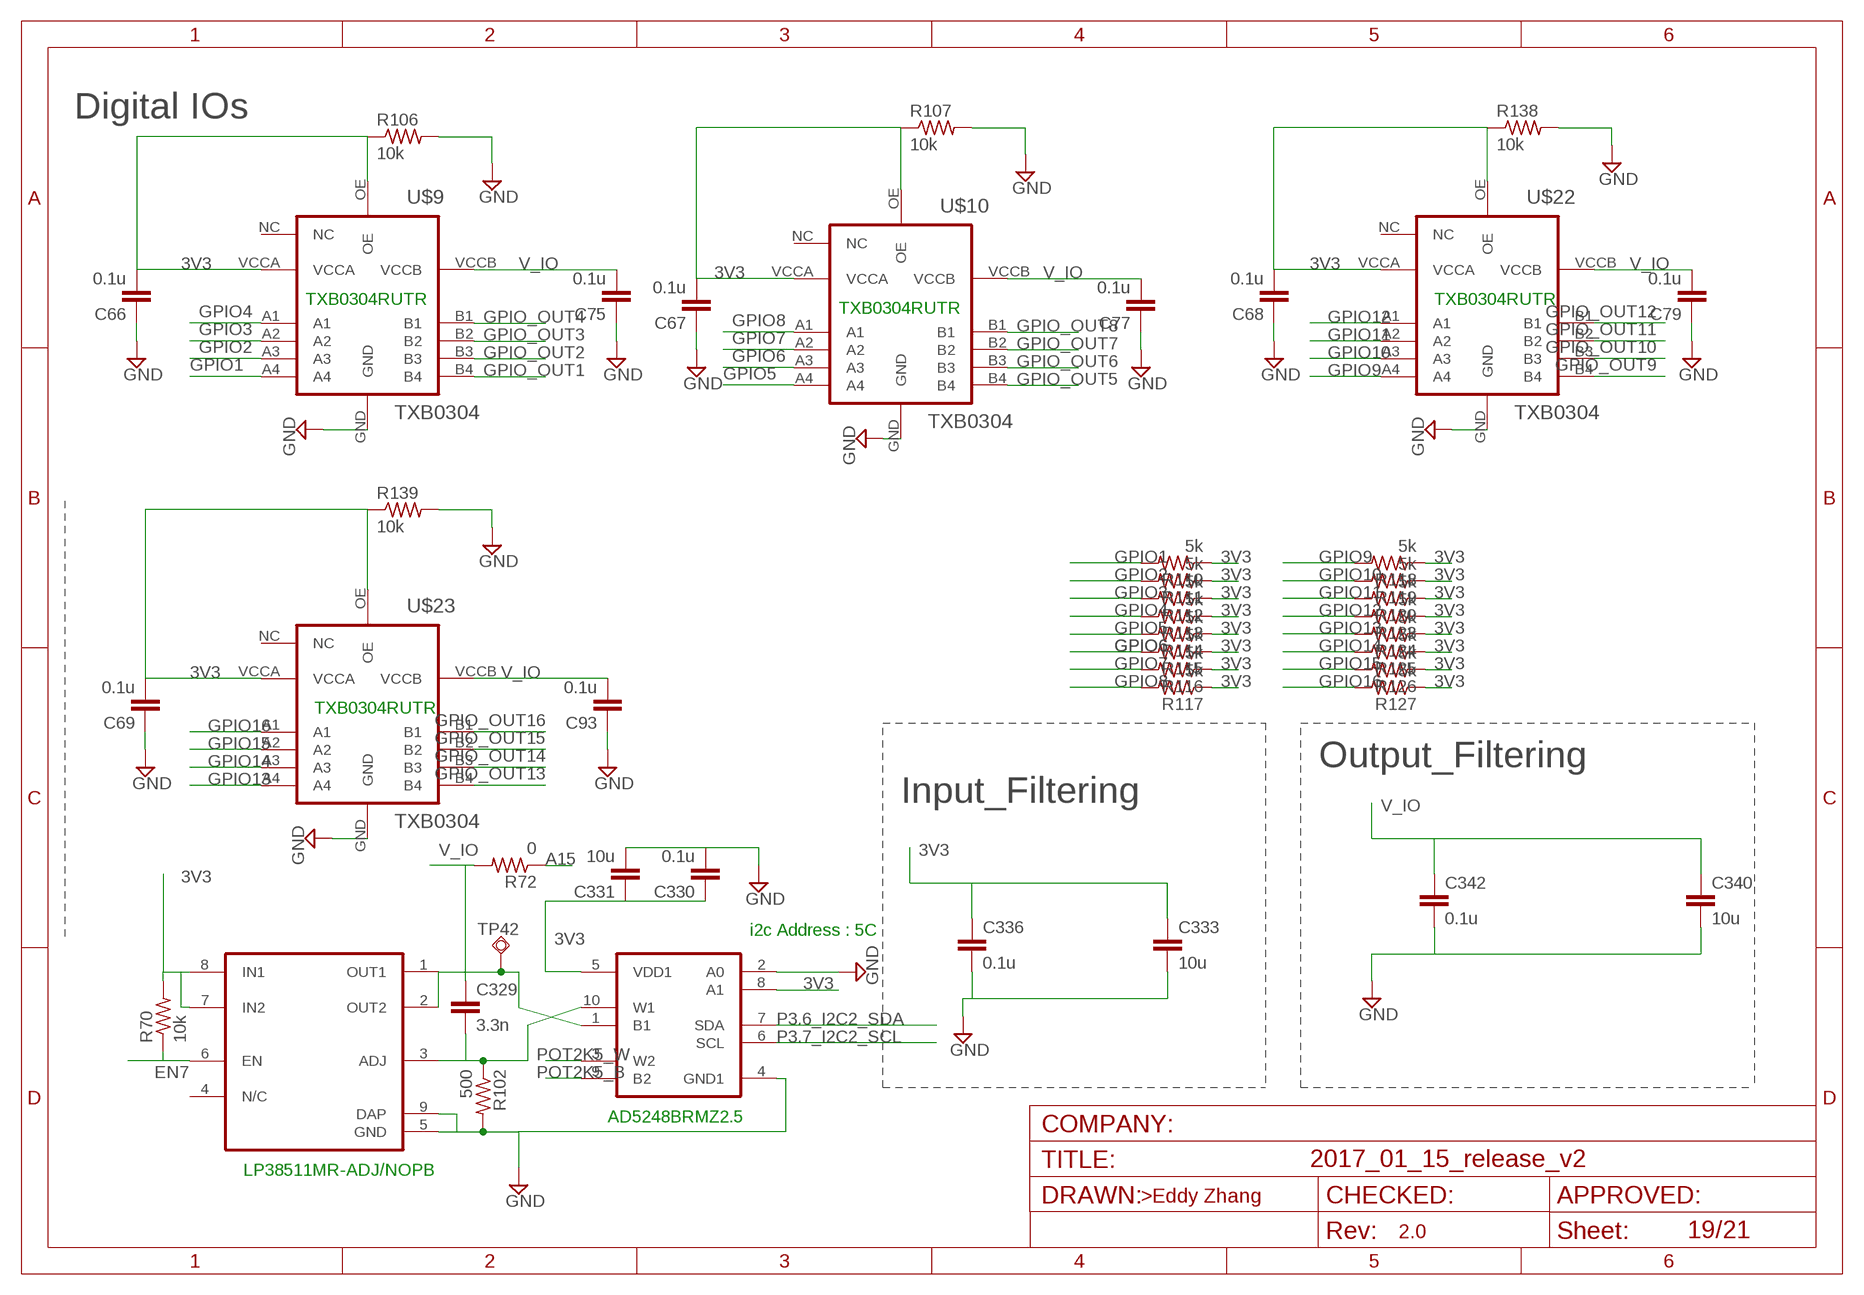
[diagram p18: schematic, sheet 19]

### Parts
C66  0.1u  C-EUC0603  [C0603]
C67  0.1u  C-EUC0603  [C0603]
C68  0.1u  C-EUC0603  [C0603]
C69  0.1u  C-EUC0603  [C0603]
C75  0.1u  C-EUC0603  [C0603]
C77  0.1u  C-EUC0603  [C0603]
C79  0.1u  C-EUC0603  [C0603]
C93  0.1u  C-EUC0603  [C0603]
C329  3.3n  C-EUC0603K  [C0603K]
C330  0.1u  C-EUC0603  [C0603]
C331  10u  C-EUC0805  [C0805]
C333  10u  C-EUC0805  [C0805]
C336  0.1u  C-EUC0603  [C0603]
C340  10u  C-EUC0805  [C0805]
C342  0.1u  C-EUC0603  [C0603]
R70  10k  R-US_R0603  [R0603]
R72  0  R-US_R0805  [R0805]
R102  500  R-US_R0603  [R0603]
R106  10k  R-US_R0603  [R0603]
R107  10k  R-US_R0603  [R0603]
R110  5k  R-US_R0603  [R0603]
R111  5k  R-US_R0603  [R0603]
R112  5k  R-US_R0603  [R0603]
R113  5k  R-US_R0603  [R0603]
R114  5k  R-US_R0603  [R0603]
R115  5k  R-US_R0603  [R0603]
R116  5k  R-US_R0603  [R0603]
R117  5k  R-US_R0603  [R0603]
R118  5k  R-US_R0603  [R0603]
R119  5k  R-US_R0603  [R0603]
R120  5k  R-US_R0603  [R0603]
R123  5k  R-US_R0603  [R0603]
R124  5k  R-US_R0603  [R0603]
R125  5k  R-US_R0603  [R0603]
R126  5k  R-US_R0603  [R0603]
R127  5k  R-US_R0603  [R0603]
R138  10k  R-US_R0603  [R0603]
R139  10k  R-US_R0603  [R0603]
TP42  TPSQTP20R  [TP20R]
U$9  TXB0304  [UQFN-12(RUT-12)]
U$10  TXB0304  [UQFN-12(RUT-12)]
U$22  TXB0304  [UQFN-12(RUT-12)]
U$23  TXB0304  [UQFN-12(RUT-12)]
U$24  LP38511_SOIC  [SOIC_8N_PAD]
U$31  AD5248  [MSOP10]

### Nets
3V3 [Power]: C66.2 C67.2 C68.2 C69.2 C330.1 C331.1 C333.1 C336.1 R70.2 R106.1 R107.1 R110.1 R111.1 R112.1 R113.1 R114.1 R115.1 R116.1 R117.1 R118.1 R119.1 R120.1 R123.1 R124.1 R125.1 R126.1 R127.1 R138.1 R139.1 U$9.OE U$9.VCCA U$10.OE U$10.VCCA U$22.OE U$22.VCCA U$23.OE U$23.VCCA U$24.7(IN2) U$24.8(IN1) U$31.5(VDD1) U$31.8(A1) ; also sheet 2,4,5,6,7,8,9,10,11,12,13,14,15,16,17,18,20
A15: R72.1 ; also sheet 5
EN7: R70.1 U$24.6(EN) ; also sheet 5
GND [GND]: C66.1 C67.1 C68.1 C69.1 C75.1 C77.1 C79.1 C93.1 C330.2 C331.2 C333.2 C336.2 C340.2 C342.2 R102.2 R106.2 R107.2 R138.2 R139.2 U$9.GND U$10.GND U$22.GND U$23.GND U$24.5(GND) U$24.9(DAP) U$31.2(A0) U$31.4(GND1) ; also sheet 2,3,4,5,6,7,8,9,10,11,12,13,14,15,16,17,18,20,21
GPIO1: R110.2 U$9.A4 ; also sheet 5
GPIO2: R111.2 U$9.A3 ; also sheet 5
GPIO3: R112.2 U$9.A2 ; also sheet 5
GPIO4: R113.2 U$9.A1 ; also sheet 5
GPIO5: R114.2 U$10.A4 ; also sheet 5
GPIO6: R115.2 U$10.A3 ; also sheet 5
GPIO7: R116.2 U$10.A2 ; also sheet 5
GPIO8: R117.2 U$10.A1 ; also sheet 5
GPIO9: R118.2 U$22.A4 ; also sheet 5
GPIO10: R119.2 U$22.A3 ; also sheet 5
GPIO11: R120.2 U$22.A2 ; also sheet 5
GPIO12: R123.2 U$22.A1 ; also sheet 5
GPIO13: R124.2 U$23.A4 ; also sheet 5
GPIO14: R125.2 U$23.A3 ; also sheet 5
GPIO15: R126.2 U$23.A2 ; also sheet 5
GPIO16: R127.2 U$23.A1 ; also sheet 5
GPIO_OUT1: U$9.B4 ; also sheet 21
GPIO_OUT2: U$9.B3 ; also sheet 21
GPIO_OUT3: U$9.B2 ; also sheet 21
GPIO_OUT4: U$9.B1 ; also sheet 21
GPIO_OUT5: U$10.B4 ; also sheet 21
GPIO_OUT6: U$10.B3 ; also sheet 21
GPIO_OUT7: U$10.B2 ; also sheet 21
GPIO_OUT8: U$10.B1 ; also sheet 21
GPIO_OUT9: U$22.B4 ; also sheet 21
GPIO_OUT10: U$22.B3 ; also sheet 21
GPIO_OUT11: U$22.B2 ; also sheet 21
GPIO_OUT12: U$22.B1 ; also sheet 21
GPIO_OUT13: U$23.B4 ; also sheet 21
GPIO_OUT14: U$23.B3 ; also sheet 21
GPIO_OUT15: U$23.B2 ; also sheet 21
GPIO_OUT16: U$23.B1 ; also sheet 21
N$173: C329.2 R102.1 U$24.3(ADJ) U$31.10(W1)
P3.6_I2C2_SDA: U$31.7(SDA) ; also sheet 4,5,17,18,20
P3.7_I2C2_SCL: U$31.6(SCL) ; also sheet 4,5,17,18,20
POT2K5_B: U$31.9(B2) ; also sheet 21
POT2K5_W: U$31.3(W2) ; also sheet 21
V_IO: C75.2 C77.2 C79.2 C93.2 C329.1 C340.1 C342.1 R72.2 TP42.TP U$9.VCCB U$10.VCCB U$22.VCCB U$23.VCCB U$24.1(OUT1) U$24.2(OUT2) U$31.1(B1)
Unconnected: U$9.NC U$10.NC U$22.NC U$23.NC U$24.4(N/C)

### Notes on the sheet
- Digital IOs
- TXB0304RUTR | TXB0304RUTR
- TXB0304RUTR
- TXB0304RUTR
- Output_Filtering
- Input_Filtering
- i2c Address : 5C
- AD5248BRMZ2.5
- LP38511MR-ADJ/NOPB
- >Eddy Zhang

## Sheet 20 of 21
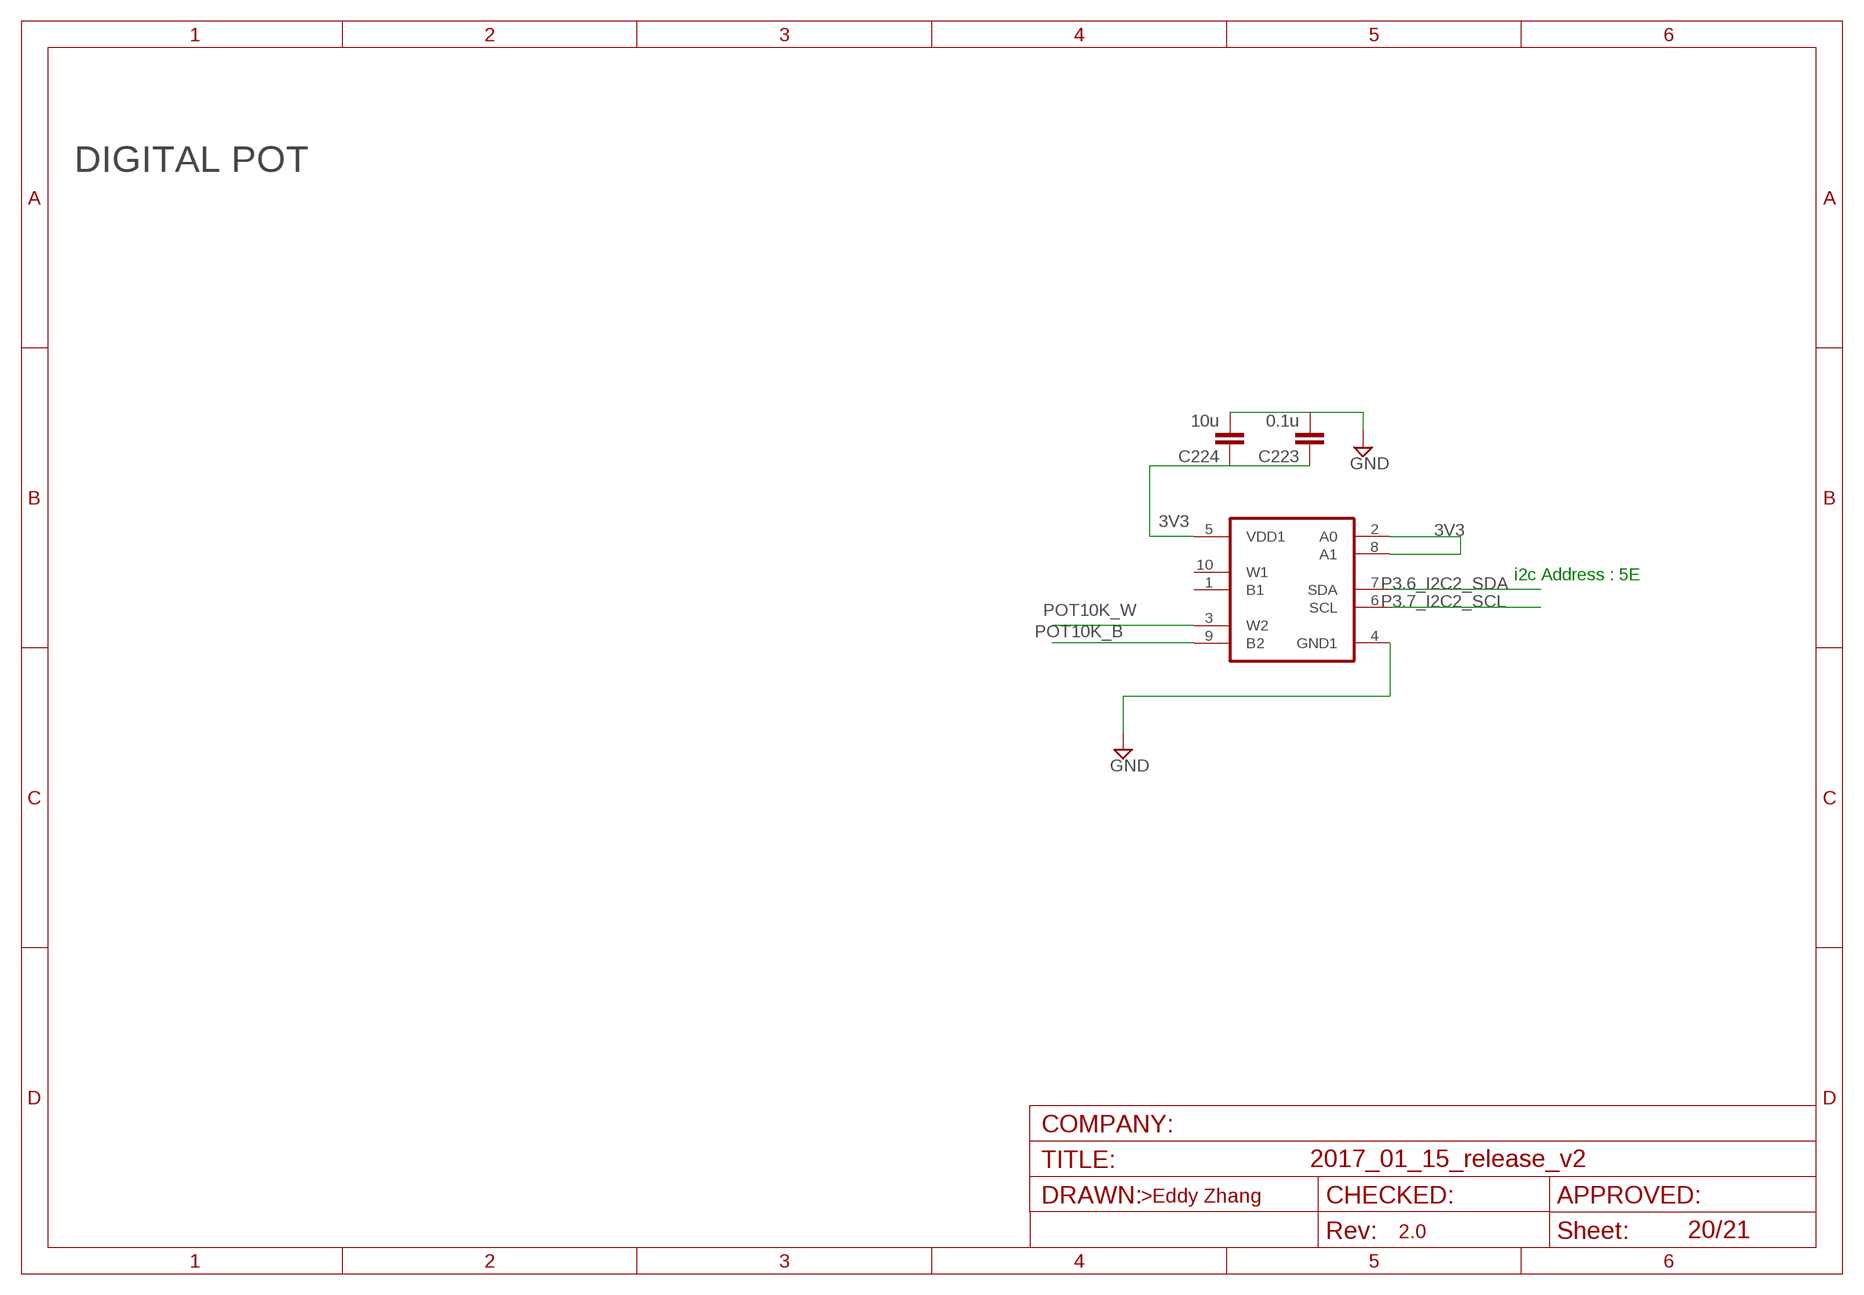
[diagram p19: schematic, sheet 20]

### Parts
C223  0.1u  C-EUC0603  [C0603]
C224  10u  C-EUC0805  [C0805]
U$13  AD5248  [MSOP10]

### Nets
3V3 [Power]: C223.1 C224.1 U$13.2(A0) U$13.5(VDD1) U$13.8(A1) ; also sheet 2,4,5,6,7,8,9,10,11,12,13,14,15,16,17,18,19
GND [GND]: C223.2 C224.2 U$13.4(GND1) ; also sheet 2,3,4,5,6,7,8,9,10,11,12,13,14,15,16,17,18,19,21
P3.6_I2C2_SDA: U$13.7(SDA) ; also sheet 4,5,17,18,19
P3.7_I2C2_SCL: U$13.6(SCL) ; also sheet 4,5,17,18,19
POT10K_B: U$13.9(B2) ; also sheet 21
POT10K_W: U$13.3(W2) ; also sheet 21
Unconnected: U$13.1(B1) U$13.10(W1)

### Notes on the sheet
- DIGITAL POT
- i2c Address : 5E
- >Eddy Zhang

## Sheet 21 of 21
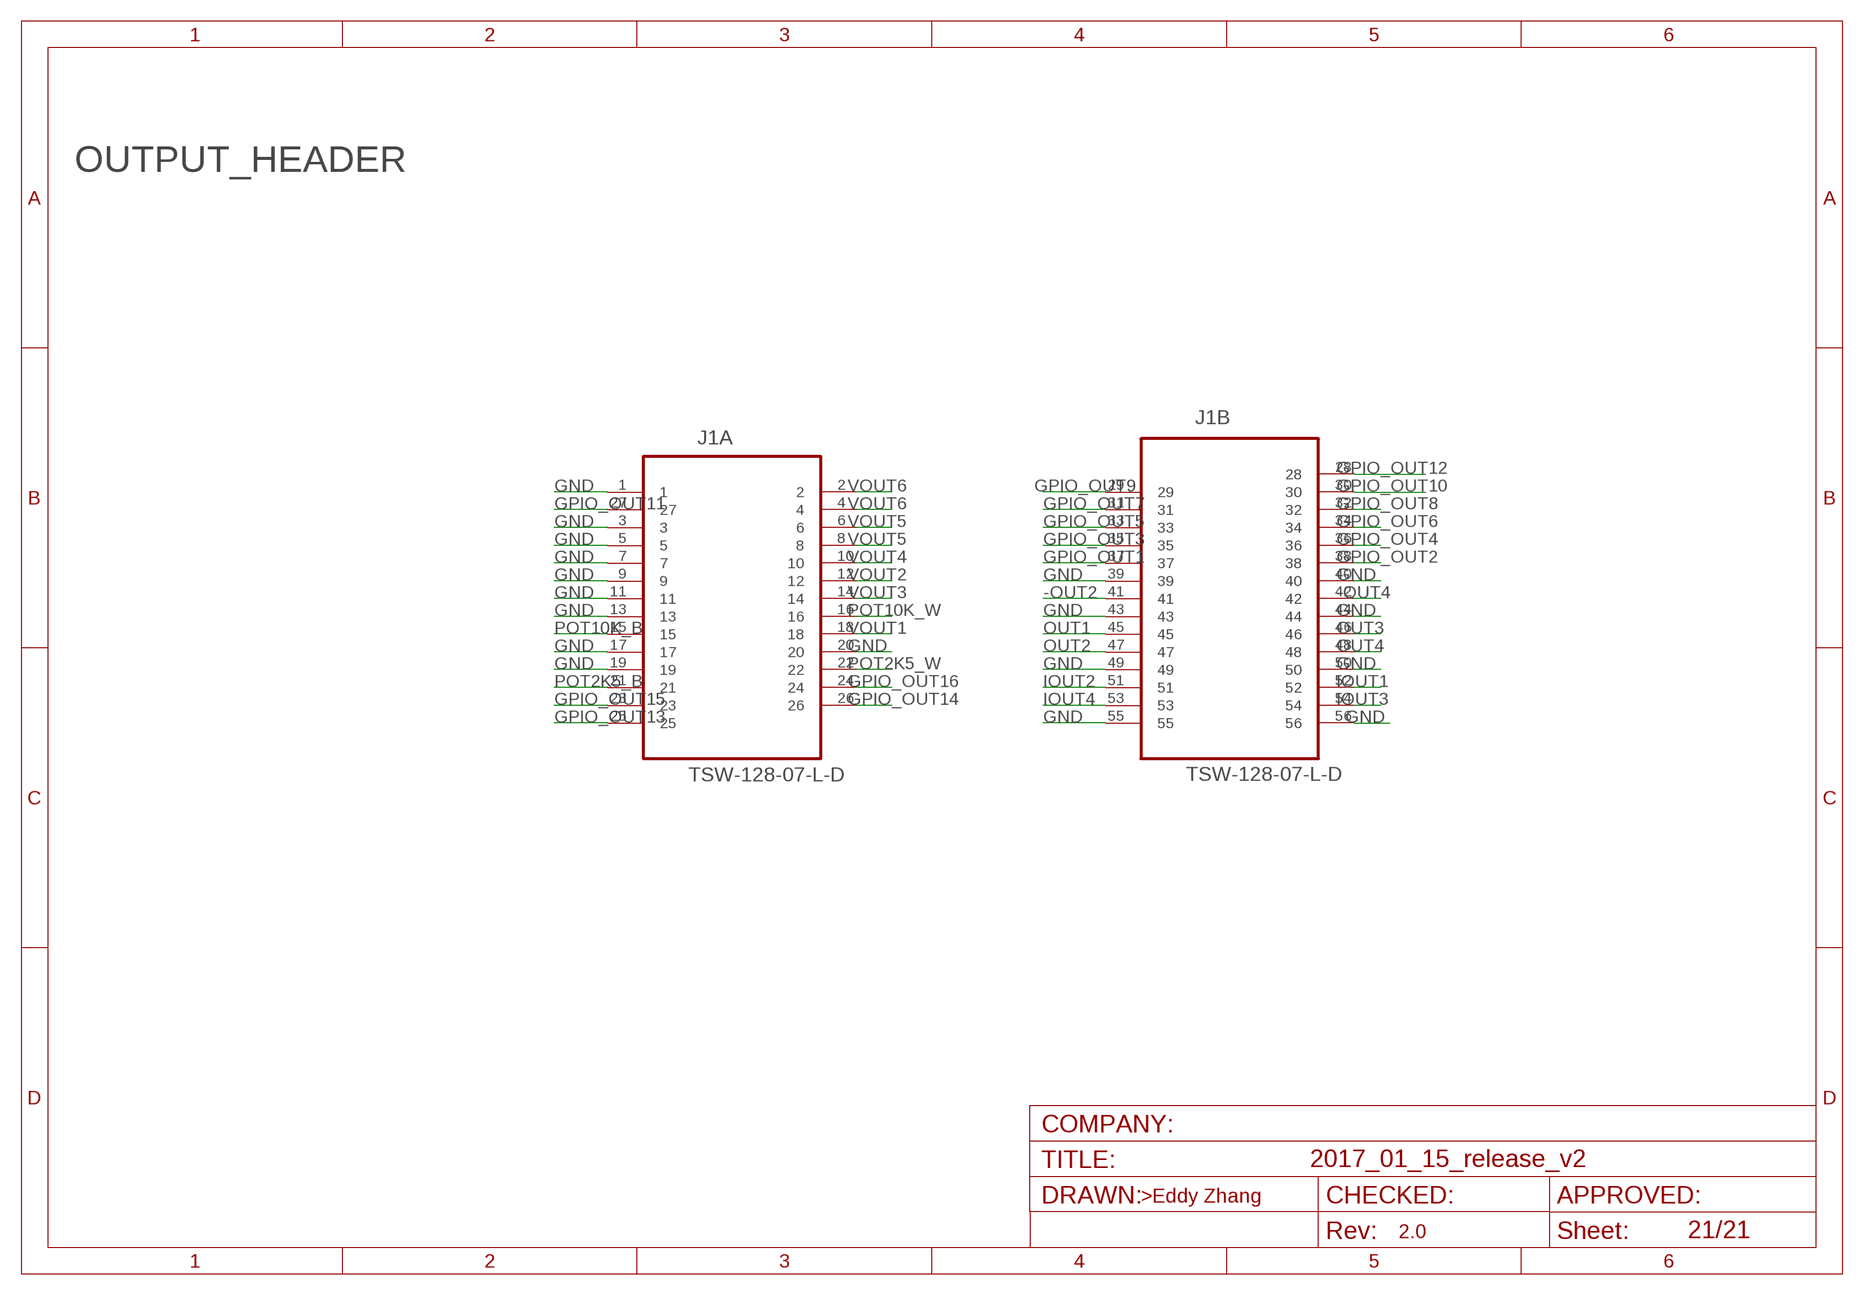
[diagram p20: schematic, sheet 21]

### Parts
J1  TSW-128-07-L-D  [SAMTEC_TSW-128-07-L-D]

### Nets
-OUT2: J1.41 ; also sheet 9
-OUT4: J1.42 ; also sheet 9
GND [GND]: J1.1 J1.3 J1.5 J1.7 J1.9 J1.11 J1.13 J1.17 J1.19 J1.20 J1.39 J1.40 J1.43 J1.44 J1.49 J1.50 J1.55 J1.56 ; also sheet 2,3,4,5,6,7,8,9,10,11,12,13,14,15,16,17,18,19,20
GPIO_OUT1: J1.37 ; also sheet 19
GPIO_OUT2: J1.38 ; also sheet 19
GPIO_OUT3: J1.35 ; also sheet 19
GPIO_OUT4: J1.36 ; also sheet 19
GPIO_OUT5: J1.33 ; also sheet 19
GPIO_OUT6: J1.34 ; also sheet 19
GPIO_OUT7: J1.31 ; also sheet 19
GPIO_OUT8: J1.32 ; also sheet 19
GPIO_OUT9: J1.29 ; also sheet 19
GPIO_OUT10: J1.30 ; also sheet 19
GPIO_OUT11: J1.27 ; also sheet 19
GPIO_OUT12: J1.28 ; also sheet 19
GPIO_OUT13: J1.25 ; also sheet 19
GPIO_OUT14: J1.26 ; also sheet 19
GPIO_OUT15: J1.23 ; also sheet 19
GPIO_OUT16: J1.24 ; also sheet 19
IOUT1: J1.52 ; also sheet 11
IOUT2: J1.51 ; also sheet 11
IOUT3: J1.54 ; also sheet 12
IOUT4: J1.53 ; also sheet 12
OUT1: J1.45 ; also sheet 8
OUT2: J1.47 ; also sheet 8
OUT3: J1.46 ; also sheet 8
OUT4: J1.48 ; also sheet 8
POT2K5_B: J1.21 ; also sheet 19
POT2K5_W: J1.22 ; also sheet 19
POT10K_B: J1.15 ; also sheet 20
POT10K_W: J1.16 ; also sheet 20
VOUT1 [Power]: J1.18 ; also sheet 13
VOUT2: J1.12 ; also sheet 14
VOUT3: J1.14 ; also sheet 15
VOUT4: J1.10 ; also sheet 16
VOUT5: J1.6 J1.8 ; also sheet 17
VOUT6: J1.2 J1.4 ; also sheet 18

### Notes on the sheet
- OUTPUT_HEADER
- >Eddy Zhang

## Library data of the parts
32KHZ = ECE497_EDDY:FC-135
ADJ2-ADJ6 U$6 U$24 = ECE497_EDDY:LP38511_SOIC
C1 C2 C4-C8 C11-C13 = rcl:C-EU: CAPACITOR, European symbol
C3 C95 C195 = rcl:CPOL-EU: POLARIZED CAPACITOR, European symbol
C9 C14-C93 C97-C99 C136-C141 C145-C149 C151-C154 C156 C157 C159 C162 C164 C168 C170 C174 C176-C186 C188-C190 C192-C194 C198-C200 C202-C212 C215-C217 C219-C224 C235 C237-C270 C273-C276 C279-C286 C289 C292 C294 C296-C302 C305 C306 C310 C311 C315 C317 C319-C325 C328-C331 C333 C336 C340 C342 C364 C366 C367 C370-C373 = resistor:C-EU: CAPACITOR, European symbol
C10 = cap:CSMD0805
ESD_DIODE = ECE497_EDDY:TPD2E2U06
J1 = SAMTEC-TSW-xxx-D_By_element14_Batch_1:TSW-128-07-L-D: POST HEADER , THROUGH-HOLE; MPN: TSW-128-07-L-D; OC_FARNELL: 2025361; OC_NEWARK: 12P2967; PACKAGE: THROUGH-HOLE .025" SQ POST HEADER 56 WAYS; SUPPLIER: Samtec
J9 = MSP430_Headers:DEBUG_ARM-10; SAMTEC: FTSH-105-01-F-D-K
L1 = Murata:LQM2MP_G0
LED1 = led:LED: LED OSRAM: - CHIPLED LG R971, LG N971, LY N971, LG Q971, LY Q971, LO R971, LY R971 LH N974, LH R974 LS Q976, LO Q976, LY Q976 LO Q996 - Hyper CHIPLED LW Q18S LB Q993, LB Q99A, LB R99A - SideLED LS A670, LO A670, LY A670, LG A670, LP A670 LB A673, LV A673, LT A673, LW A673 LH A674 LY A675 LS A676, LA A676, LO A676, LY A676, LW A676 LS A679, LY A679, LG A679 - Hyper Micro SIDELED® LS Y876, LA Y876, LO Y876, LY Y876 LT Y87S - SmartLED LW L88C, LW L88S LB L89C, LB L89S, LG L890 LS L89K, LO L89K, LY L89K LS L896, LA L896, LO L896, LY L896 - TOPLED LS T670, LO T670, LY T670, LG T670, LP T670 LSG T670, LSP T670, LSY T670, LOP T670, LYG T670 LG T671, LOG T671, LSG T671 LB T673, LV T673, LT T673, LW T673 LH T674 LS T676, LA T676, LO T676, LY T676, LB T676, LH T676, LSB T676, LW T676 LB T67C, LV T67C, LT T67C, LS T67K, LO T67K, LY T67K, LW E67C LS E67B, LA E67B, LO E67B, LY E67B, LB E67C, LV E67C, LT E67C LW T67C LS T679, LY T679, LG T679 LS T770, LO T770, LY T770, LG T770, LP T770 LB T773, LV T773, LT T773, LW T773 LH T774 LS E675, LA E675, LY E675, LS T675 LS T776, LA T776, LO T776, LY T776, LB T776 LHGB T686 LT T68C, LB T68C - Hyper Mini TOPLED® LB M676 - Mini TOPLED Santana® LG M470 LS M47K, LO M47K, LY M47K Source: http://www.osram.convergy.de LUXEON: - LUMILED® LXK2-PW12-R00, LXK2-PW12-S00, LXK2-PW14-U00, LXK2-PW14-V00 LXK2-PM12-R00, LXK2-PM12-S00, LXK2-PM14-U00 LXK2-PE12-Q00, LXK2-PE12-R00, LXK2-PE12-S00, LXK2-PE14-T00, LXK2-PE14-U00 LXK2-PB12-K00, LXK2-PB12-L00, LXK2-PB12-M00, LXK2-PB14-N00, LXK2-PB14-P00, LXK2-PB14-Q00 LXK2-PR12-L00, LXK2-PR12-M00, LXK2-PR14-Q00, LXK2-PR14-R00 LXK2-PD12-Q00, LXK2-PD12-R00, LXK2-PD12-S00 LXK2-PH12-R00, LXK2-PH12-S00 LXK2-PL12-P00, LXK2-PL12-Q00, LXK2-PL12-R00 Source: www.luxeon.com KINGBRIGHT: KA-3528ASYC Source: www.kingbright.com
LED2-LED8 = SparkFun:LED: LEDs Standard schematic elements and footprints for 5mm, 3mm, 1206, and 0603 sized LEDs. 5mm - Spark Fun Electronics SKU : COM-00529 (and others)
MSP432 = MSP432P401x_EAGLE_LIB:MSP432P401X: MSP432P401R/M Texas Instruments
POT2-POT6 U$4 U$13 U$31 = ECE497_EDDY:AD5248
Q1 = MSP_Crystals:CRYSTAL
Q3-Q6 = transistor-npn:BC849*: NPN Transistor
R1 R6 R7 = rcl:R-EU_: RESISTOR, European symbol
R2-R4 R8-R145 R190 = resistor:R-US_: RESISTOR, American symbol
R5 = smd:R_0805
REF5030 REF5040 = ECE497_EDDY:REF5025AID: Low-Noise, Very Low Drift, Precision VOLTAGE REFERENCE; MPN: REF5025AID; OC_FARNELL: 1439622; OC_NEWARK: 50M8895; PACKAGE: SOIC-8; SUPPLIER: Texas Instruments
S1 S3 = MSP430_SwitchesTestpointsJumpers:TS-1188E
SV2 SV4 SV6-SV9 SV13-SV16 = con-lstb:MA03-1: PIN HEADER; OC_FARNELL: unknown; OC_NEWARK: unknown
TP1-TP3 TP5-TP11 TP13 TP14 TP16 TP19 TP21-TP32 TP42-TP50 = testpad:TPSQ: Test pad
TP4 = pinhead:PINHD-1X1: PIN HEADER
U1 = SparkFun:FT232RL: USB UART FT232RL 4th Generation USB UART (USB <-> Serial) Controller. Spark Fun Electronics SKU : COM-00650
U3 = Texas Instruments_By_element14_Batch_1:TPS2115AIPWRQ1: AUTO-SWITCHING POWER MULTIPLEXER; MPN: TPS2115AIPWRQ1; OC_FARNELL: -; OC_NEWARK: 52P6807; PACKAGE: TSSOP-8; SUPPLIER: Texas Instruments
U$1-U$3 U$5 = MSP-EXP432:MOUNTHOLE_125MIL
U$7 U$8 = SparkFun-Connectors_new:USB_CONN_EDDY
U$9 U$10 U$22 U$23 = ECE497_EDDY:TXB0304
U$11 U$12 U$14 = ECE497_EDDY:DAC80004
U$15-U$20 U$58 U$59 = ECE497_EDDY:OPA333DVT
U$21 VSEN2-VSEN6 = ECE497_EDDY:MAX44284
U$41 U$45 = ECE497_EDDY:LT5400
U$42 = ECE497_EDDY:TSZ122
U$43 = ECE497_EDDY:ADM7171
U$56 = ECE497_EDDY:MAX1697
U$57 = ECE497_EDDY:TPS723-Q1

## Net classes
0 default: width 0.152 mm, drill 0.254 mm, clearance 0.152 mm
1 GND: width 0.152 mm, drill 0.254 mm, clearance 0.152 mm to class 0, clearance 0.152 mm
2 Power: width 0.152 mm, drill 0.254 mm, clearance 0.152 mm to class 0, clearance 0.152 mm to class 1, clearance 0.152 mm